# EAGLE schematic botball_v5 (EAGLE 6.5.0), part 1 of 3

## Sheet 1 of 44
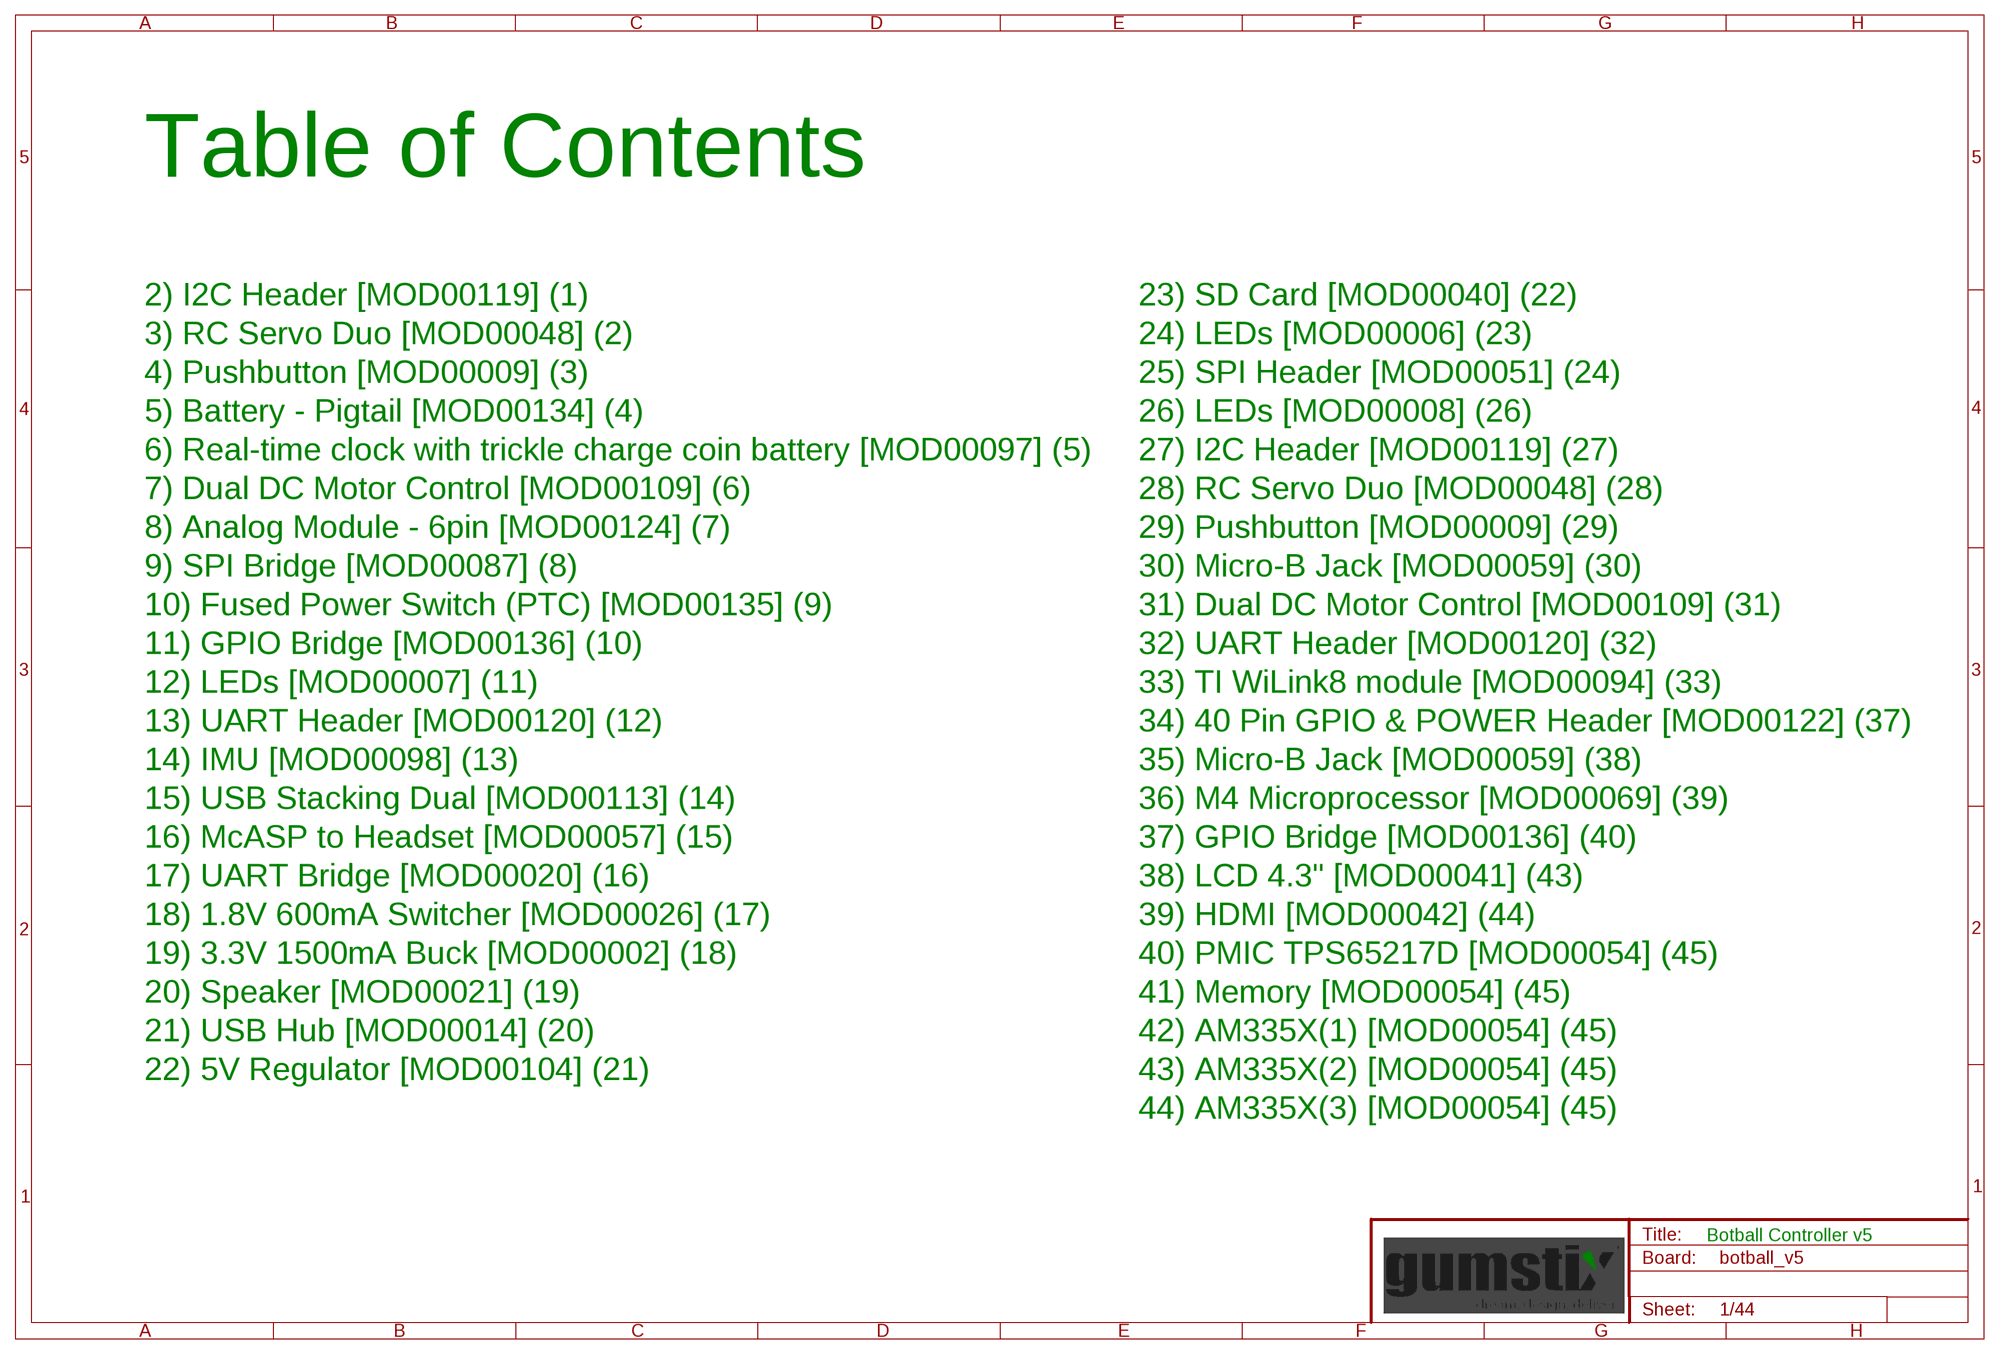
[diagram p0: schematic, sheet 1]

### Notes on the sheet
- Table of Contents
- 2) I2C Header [MOD00119] (1) | 23) SD Card [MOD00040] (22)
- 3) RC Servo Duo [MOD00048] (2) | 24) LEDs [MOD00006] (23)
- 4) Pushbutton [MOD00009] (3) | 25) SPI Header [MOD00051] (24)
- 5) Battery - Pigtail [MOD00134] (4) | 26) LEDs [MOD00008] (26)
- 6) Real-time clock with trickle charge coin battery [MOD00097] (5) | 27) I2C Header [MOD00119] (27)
- 7) Dual DC Motor Control [MOD00109] (6) | 28) RC Servo Duo [MOD00048] (28)
- 8) Analog Module - 6pin [MOD00124] (7) | 29) Pushbutton [MOD00009] (29)
- 9) SPI Bridge [MOD00087] (8) | 30) Micro-B Jack [MOD00059] (30)
- 10) Fused Power Switch (PTC) [MOD00135] (9) | 31) Dual DC Motor Control [MOD00109] (31)
- 11) GPIO Bridge [MOD00136] (10) | 32) UART Header [MOD00120] (32)
- 12) LEDs [MOD00007] (11) | 33) TI WiLink8 module [MOD00094] (33)
- 13) UART Header [MOD00120] (12) | 34) 40 Pin GPIO & POWER Header [MOD00122] (37)
- 14) IMU [MOD00098] (13) | 35) Micro-B Jack [MOD00059] (38)
- 15) USB Stacking Dual [MOD00113] (14) | 36) M4 Microprocessor [MOD00069] (39)
- 16) McASP to Headset [MOD00057] (15) | 37) GPIO Bridge [MOD00136] (40)
- 17) UART Bridge [MOD00020] (16) | 38) LCD 4.3" [MOD00041] (43)
- 18) 1.8V 600mA Switcher [MOD00026] (17) | 39) HDMI [MOD00042] (44)
- 19) 3.3V 1500mA Buck [MOD00002] (18) | 40) PMIC TPS65217D [MOD00054] (45)
- 20) Speaker [MOD00021] (19) | 41) Memory [MOD00054] (45)
- 21) USB Hub [MOD00014] (20) | 42) AM335X(1) [MOD00054] (45)
- 22) 5V Regulator [MOD00104] (21) | 43) AM335X(2) [MOD00054] (45)
- 44) AM335X(3) [MOD00054] (45)
- Botball Controller v5

## Sheet 2 of 44
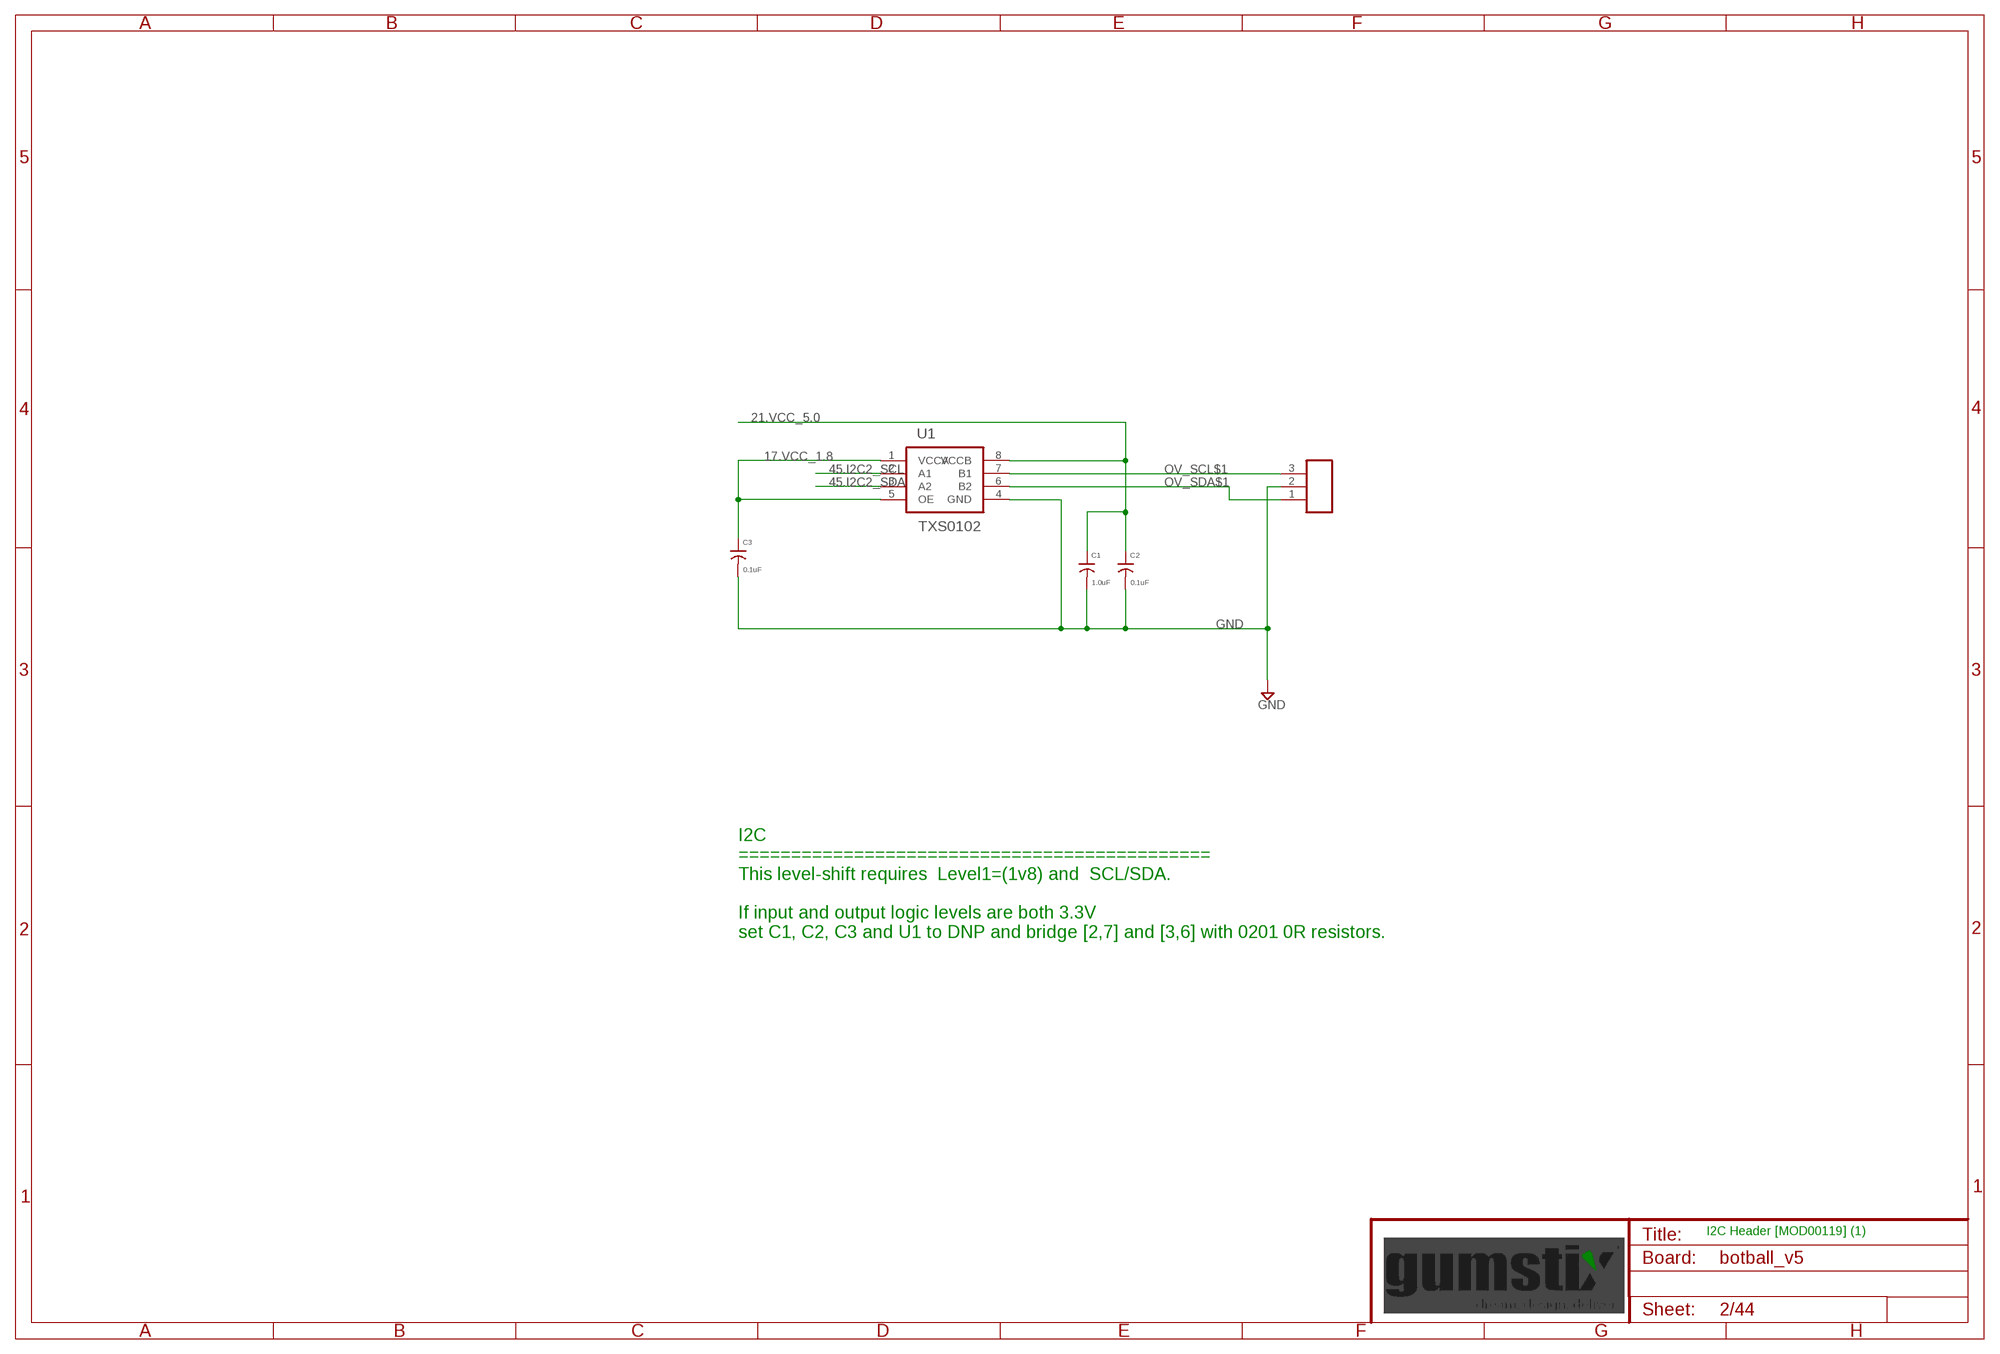
[diagram p1: schematic, sheet 2]

### Parts
C1  1.0uF  C0402  [0402]
C2  0.1uF  C0201  [0201]
C3  0.1uF  C0201  [0201]
J1  MA03X1 FEMALE  MA03X1100  [MA03-100]
U1  TXS0102  [DFN8-0.4P]

### Nets
17.VCC_1.8 [supply]: C3.1 U1.1(VCCA) U1.5(OE) ; also sheet 6,9,11,16,17,18,32,33,37,38,39
21.VCC_5.0 [supply]: C1.1 C2.1 U1.8(VCCB) ; also sheet 3,7,8,10,13,15,21,22,25,27,28,31,32,34,39,40,43
45.I2C2_SCL: U1.2(A1) ; also sheet 43
45.I2C2_SDA: U1.3(A2) ; also sheet 43
GND: C1.2 C2.2 C3.2 J1.2 U1.4(GND) ; also sheet 3,4,5,6,7,9,10,11,12,13,14,15,16,17,18,19,20,21,22,23,24,25,26,27,28,29,30,31,32,33,34,35,36,37,38,39,40,41,42,43,44
OV_SCL$1: J1.3 U1.7(B1)
OV_SDA$1: J1.1 U1.6(B2)

### Notes on the sheet
- I2C
  =============================================
  This level-shift requires  Level1=(1v8) and  SCL/SDA.
  
  If input and output logic levels are both 3.3V
  set C1, C2, C3 and U1 to DNP and bridge [2,7] and [3,6] with 0201 0R resistors.
- I2C Header [MOD00119] (1)

## Sheet 3 of 44
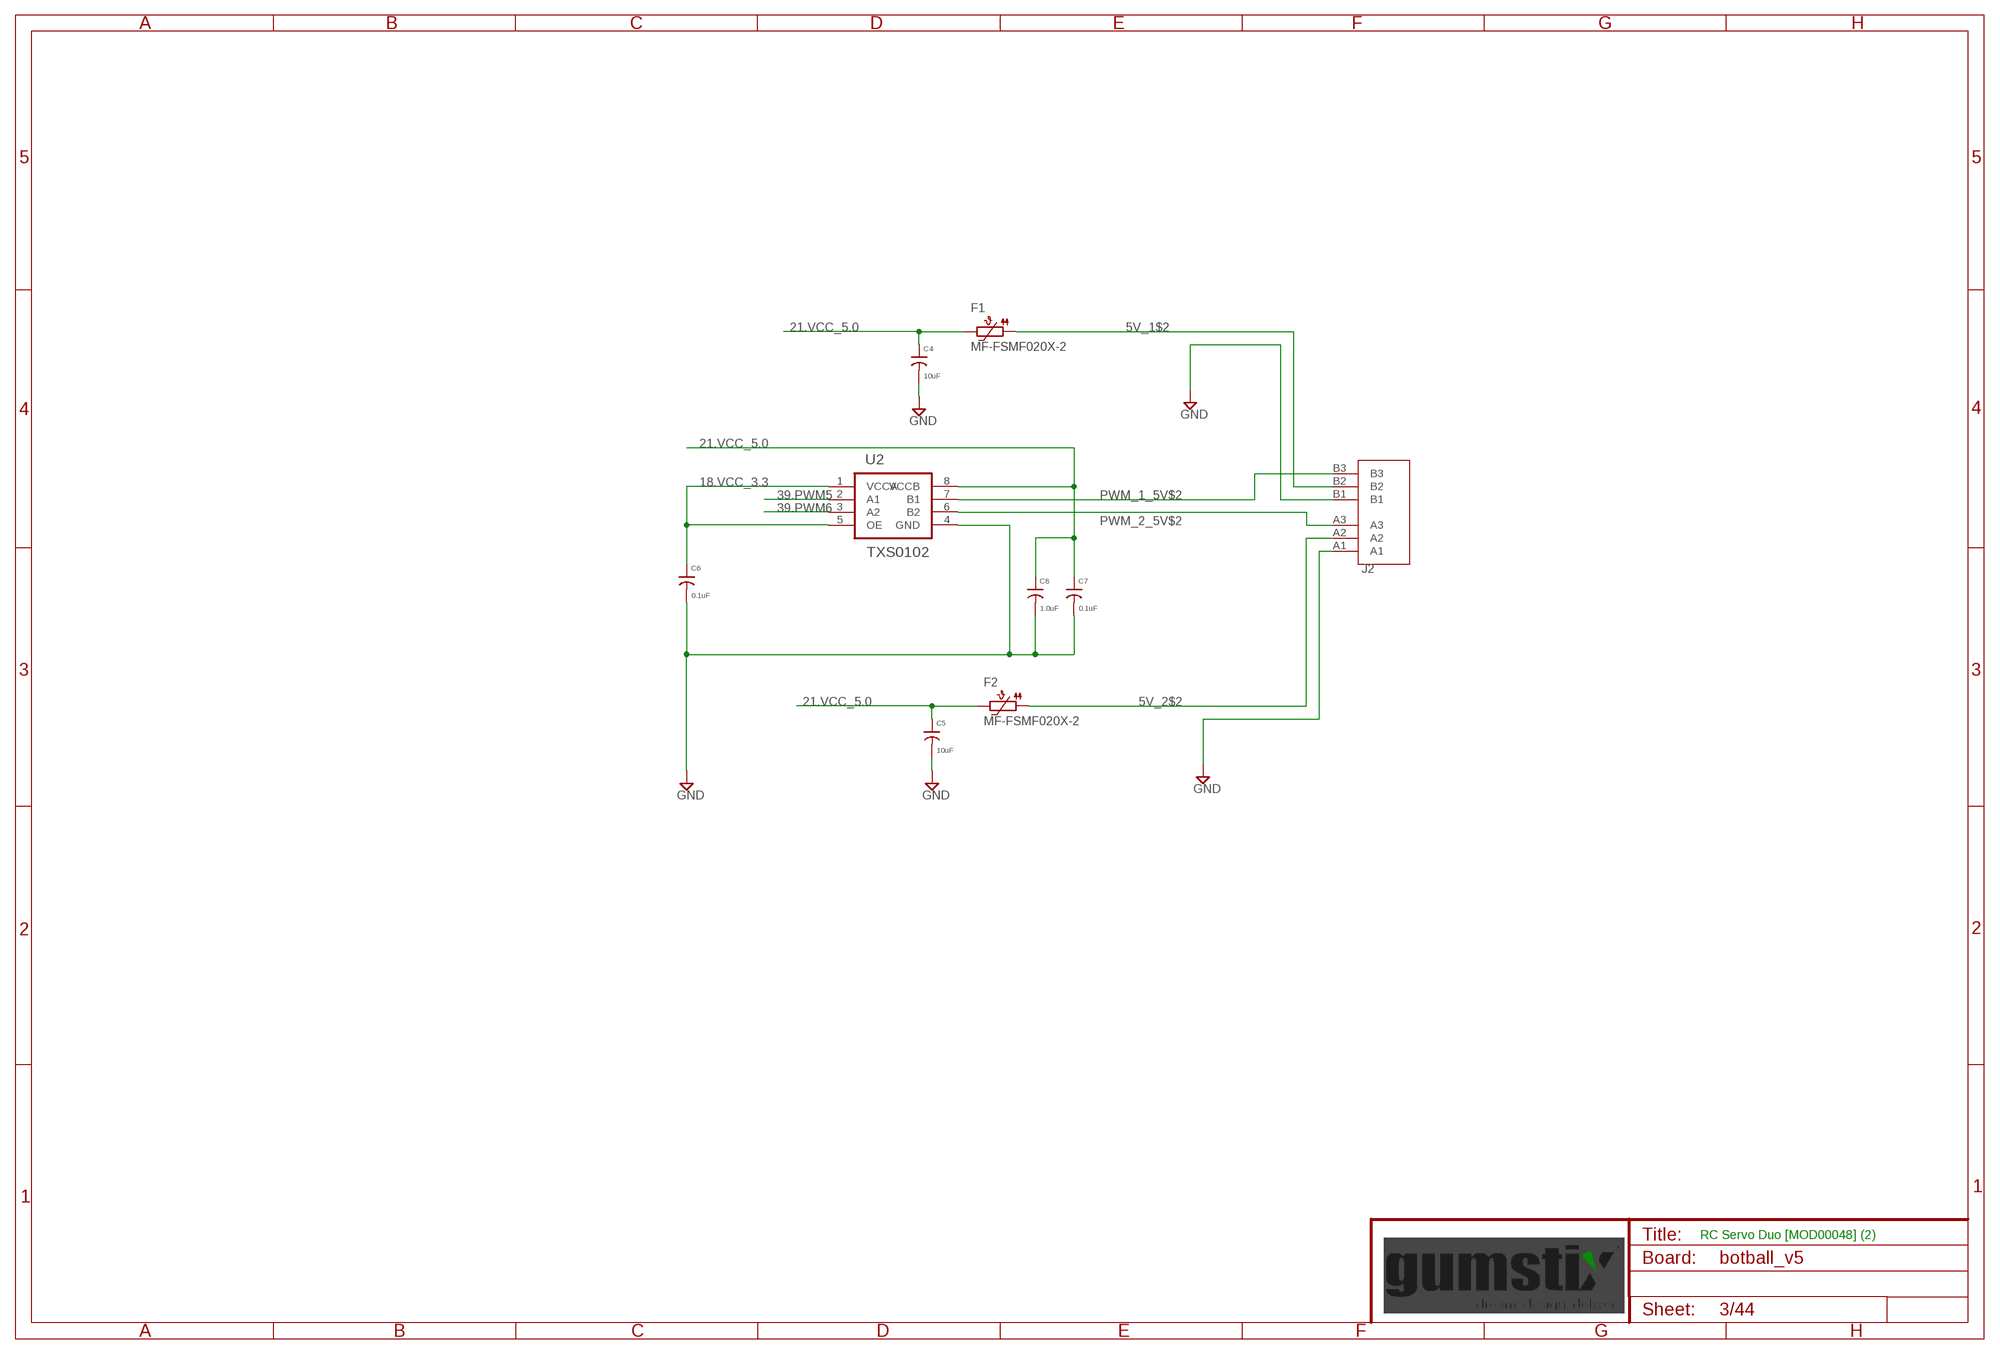
[diagram p2: schematic, sheet 3]

### Parts
C4  10uF  C0402  [0402]
C5  10uF  C0402  [0402]
C6  0.1uF  C0201  [0201]
C7  0.1uF  C0201  [0201]
C8  1.0uF  C0402  [0402]
F1  MF-FSMF020X-2  PTC0603  [0603]
F2  MF-FSMF020X-2  PTC0603  [0603]
J2  MA03X2 FEMALE  MA03X2  [MA03-2]
U2  TXS0102  [DFN8-0.4P]

### Nets
5V_1$2 [supply]: F1.1 J2.B2
5V_2$2 [supply]: F2.1 J2.A2
18.VCC_3.3 [supply]: C6.1 U2.1(VCCA) U2.5(OE) ; also sheet 4,7,9,11,12,13,14,16,17,18,19,20,21,23,24,25,26,27,28,29,31,33,34,36,37,38,39
21.VCC_5.0 [supply]: C4.1 C5.1 C7.1 C8.1 F1.2 F2.2 U2.8(VCCB) ; also sheet 2,7,8,10,13,15,21,22,25,27,28,31,32,34,39,40,43
39.PWM5: U2.2(A1) ; also sheet 36
39.PWM6: U2.3(A2) ; also sheet 36
GND: C4.2 C5.2 C6.2 C7.2 C8.2 J2.A1 J2.B1 U2.4(GND) ; also sheet 2,4,5,6,7,9,10,11,12,13,14,15,16,17,18,19,20,21,22,23,24,25,26,27,28,29,30,31,32,33,34,35,36,37,38,39,40,41,42,43,44
PWM_1_5V$2: J2.B3 U2.7(B1)
PWM_2_5V$2: J2.A3 U2.6(B2)

### Notes on the sheet
- RC Servo Duo [MOD00048] (2)

## Sheet 4 of 44
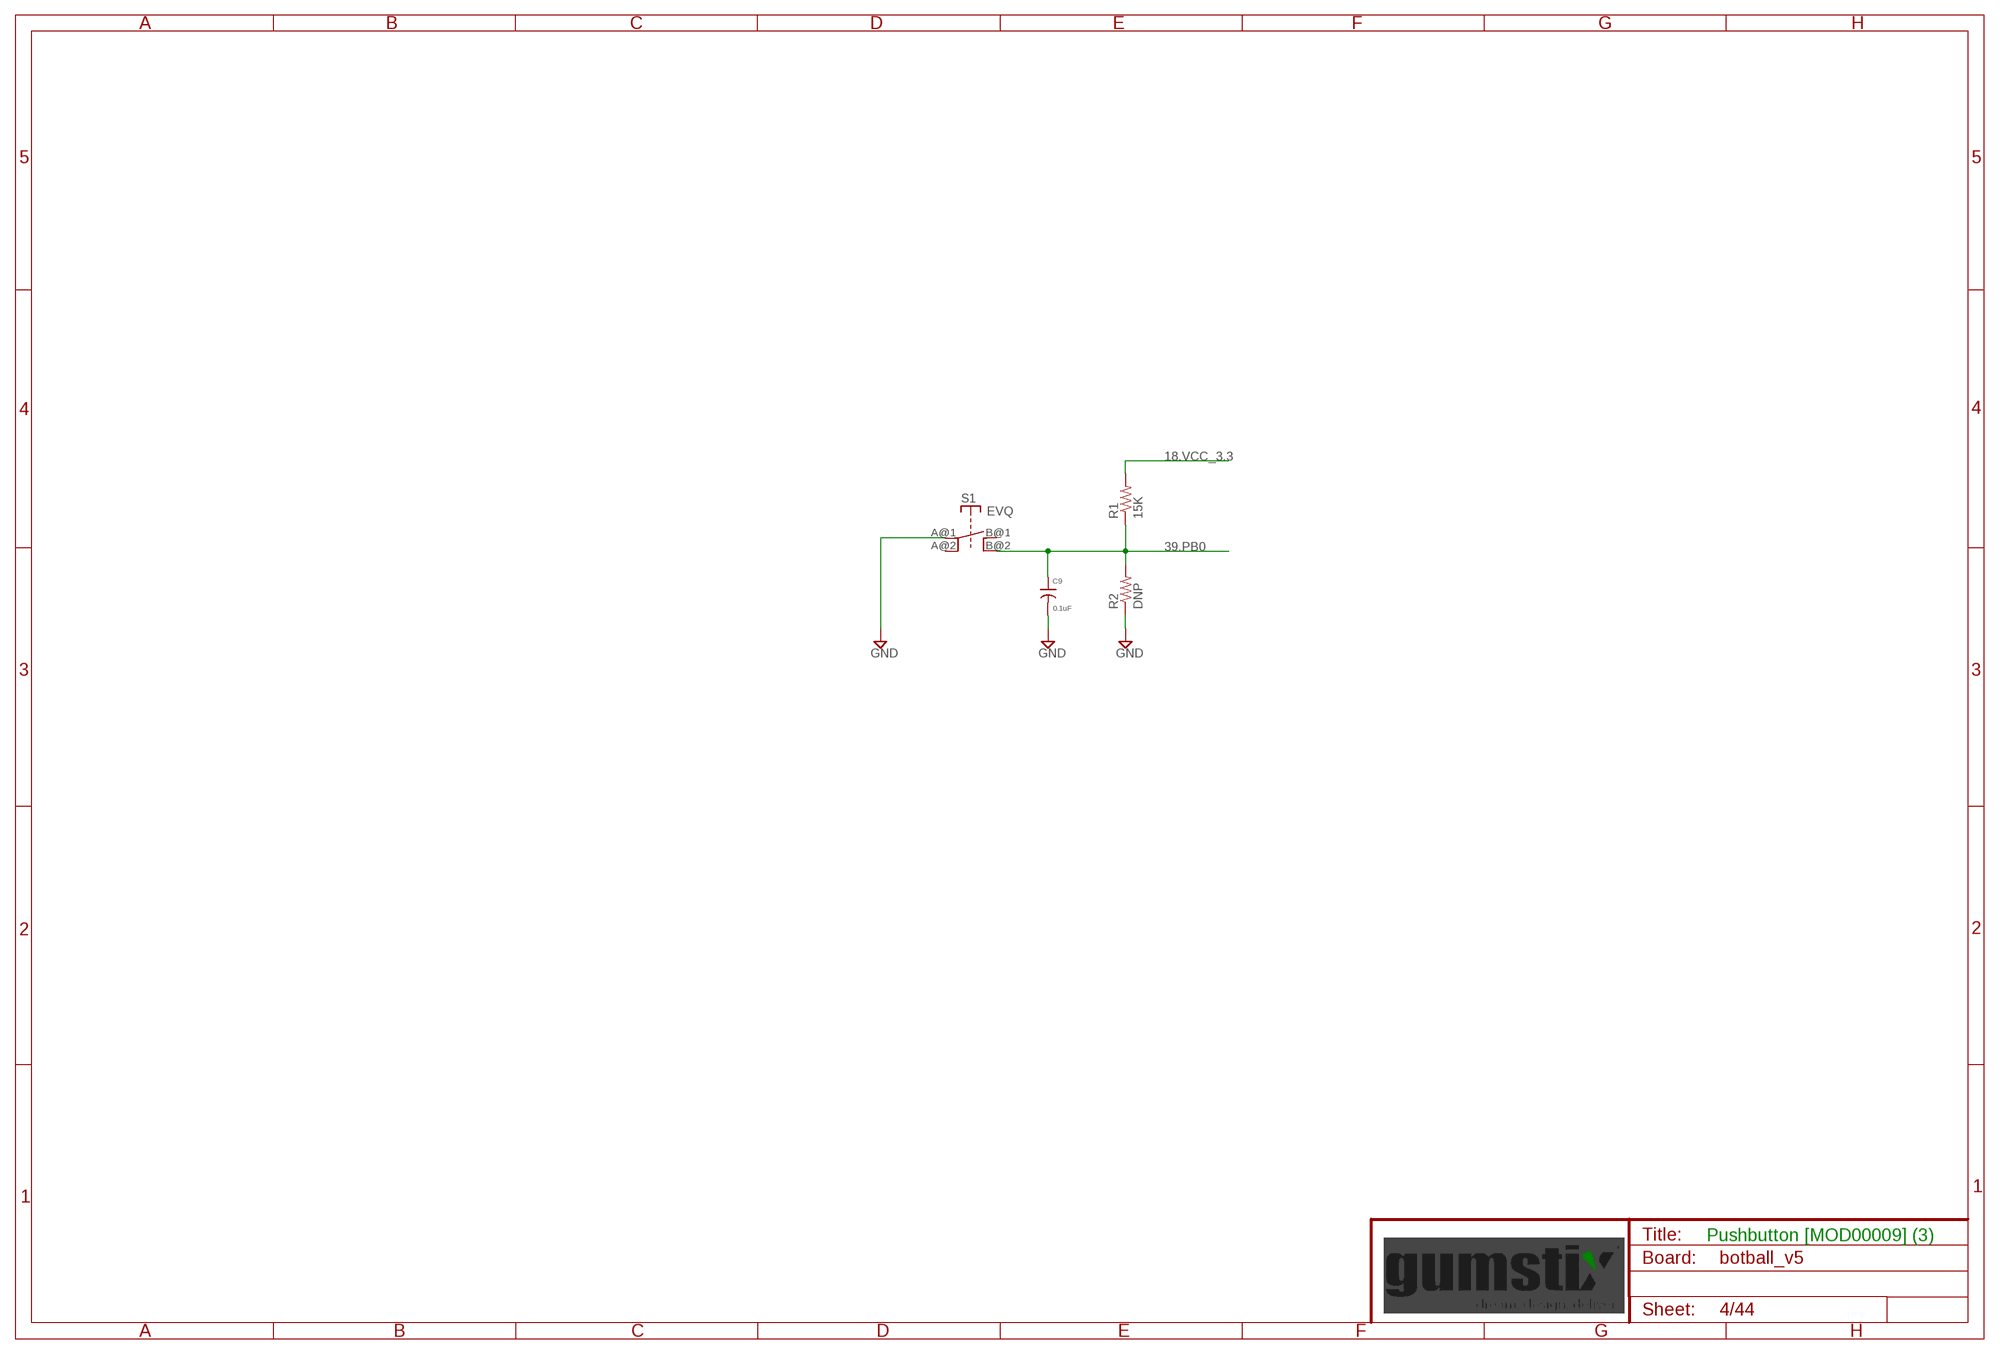
[diagram p3: schematic, sheet 4]

### Parts
C9  0.1uF  C0402  [0402]
R1  15K  R0402  [0402]
R2  DNP  R0402  [0402]
S1  EVQ  [EVQ]

### Nets
18.VCC_3.3 [supply]: R1.2 ; also sheet 3,7,9,11,12,13,14,16,17,18,19,20,21,23,24,25,26,27,28,29,31,33,34,36,37,38,39
39.PB0: C9.1 R1.1 R2.2 S1.B@2(B') ; also sheet 36
GND: C9.2 R2.1 S1.A@1(A) ; also sheet 2,3,5,6,7,9,10,11,12,13,14,15,16,17,18,19,20,21,22,23,24,25,26,27,28,29,30,31,32,33,34,35,36,37,38,39,40,41,42,43,44
Unconnected: S1.A@2(A') S1.B@1(B)

### Notes on the sheet
- Pushbutton [MOD00009] (3)

## Sheet 5 of 44
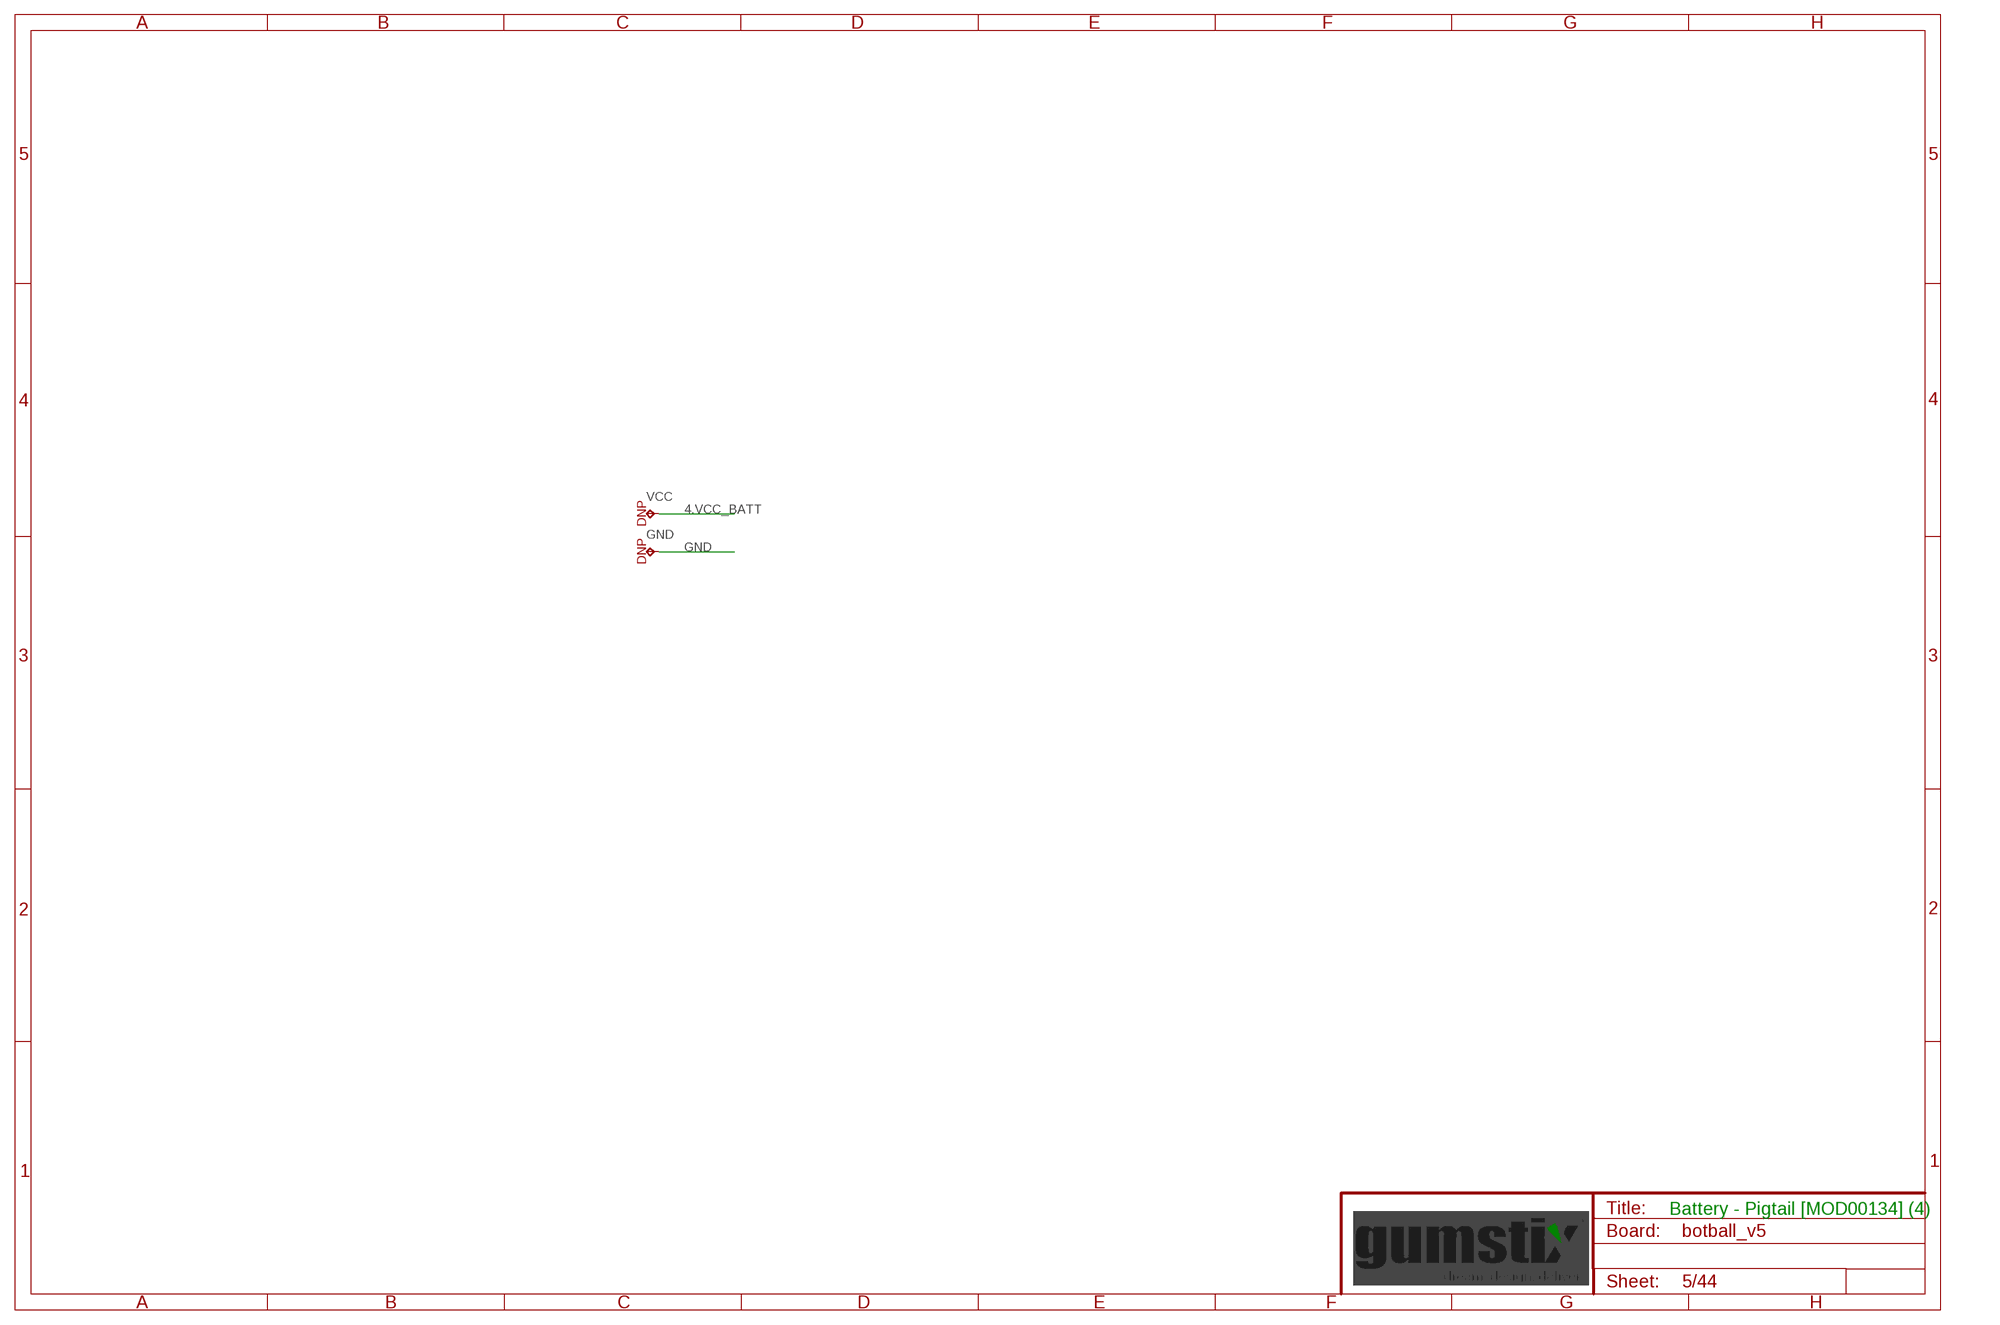
[diagram p4: schematic, sheet 5]

### Parts
GND  DNP  TP  [P1-13]
VCC  DNP  TP  [P1-13]

### Nets
4.VCC_BATT [supply]: VCC.TP ; also sheet 10,36
GND: GND.TP ; also sheet 2,3,4,6,7,9,10,11,12,13,14,15,16,17,18,19,20,21,22,23,24,25,26,27,28,29,30,31,32,33,34,35,36,37,38,39,40,41,42,43,44

### Notes on the sheet
- Battery - Pigtail [MOD00134] (4)

## Sheet 6 of 44
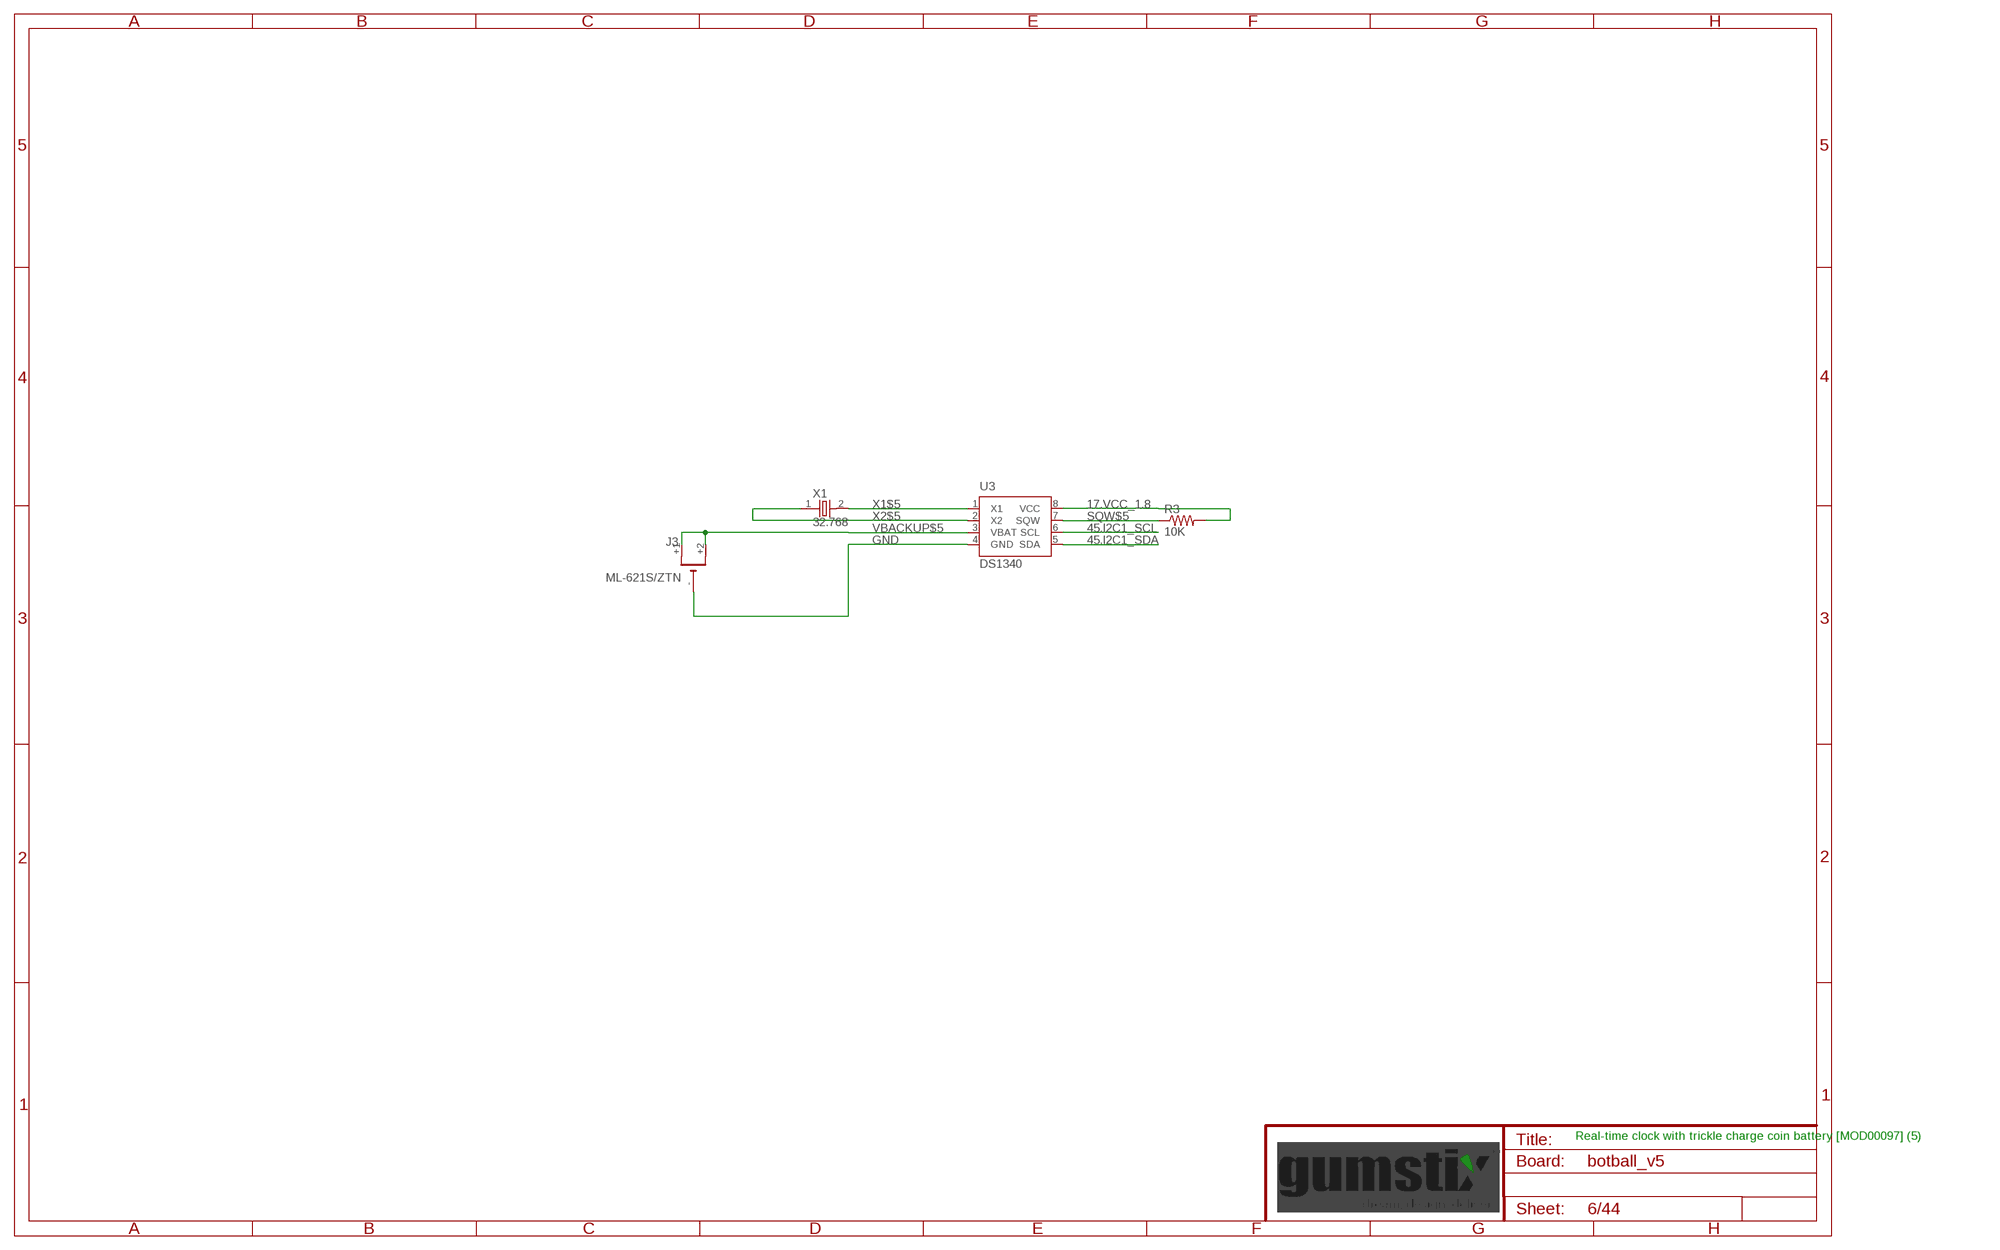
[diagram p5: schematic, sheet 6]

### Parts
J3  ML-621S/ZTN  COIN_CELL_6.8MM  [BATTERY_6.8MM-2998]
R3  10K  R0201  [0201]
U3  DS1340  DS1339  [SO-8]
X1  32.768  X2CM415  [CM415]

### Nets
17.VCC_1.8 [supply]: R3.2 U3.8(VCC) ; also sheet 2,9,11,16,17,18,32,33,37,38,39
45.I2C1_SCL: U3.6(SCL) ; also sheet 39,43
45.I2C1_SDA: U3.5(SDA) ; also sheet 39,43
GND: J3.- U3.4(GND) ; also sheet 2,3,4,5,7,9,10,11,12,13,14,15,16,17,18,19,20,21,22,23,24,25,26,27,28,29,30,31,32,33,34,35,36,37,38,39,40,41,42,43,44
SQW$5: R3.1 U3.7(SQW)
VBACKUP$5 [supply]: J3.+1 J3.+2 U3.3(VBAT)
X1$5: U3.1(X1) X1.2
X2$5: U3.2(X2) X1.1

### Notes on the sheet
- Real-time clock with trickle charge coin battery [MOD00097] (5)

## Sheet 7 of 44
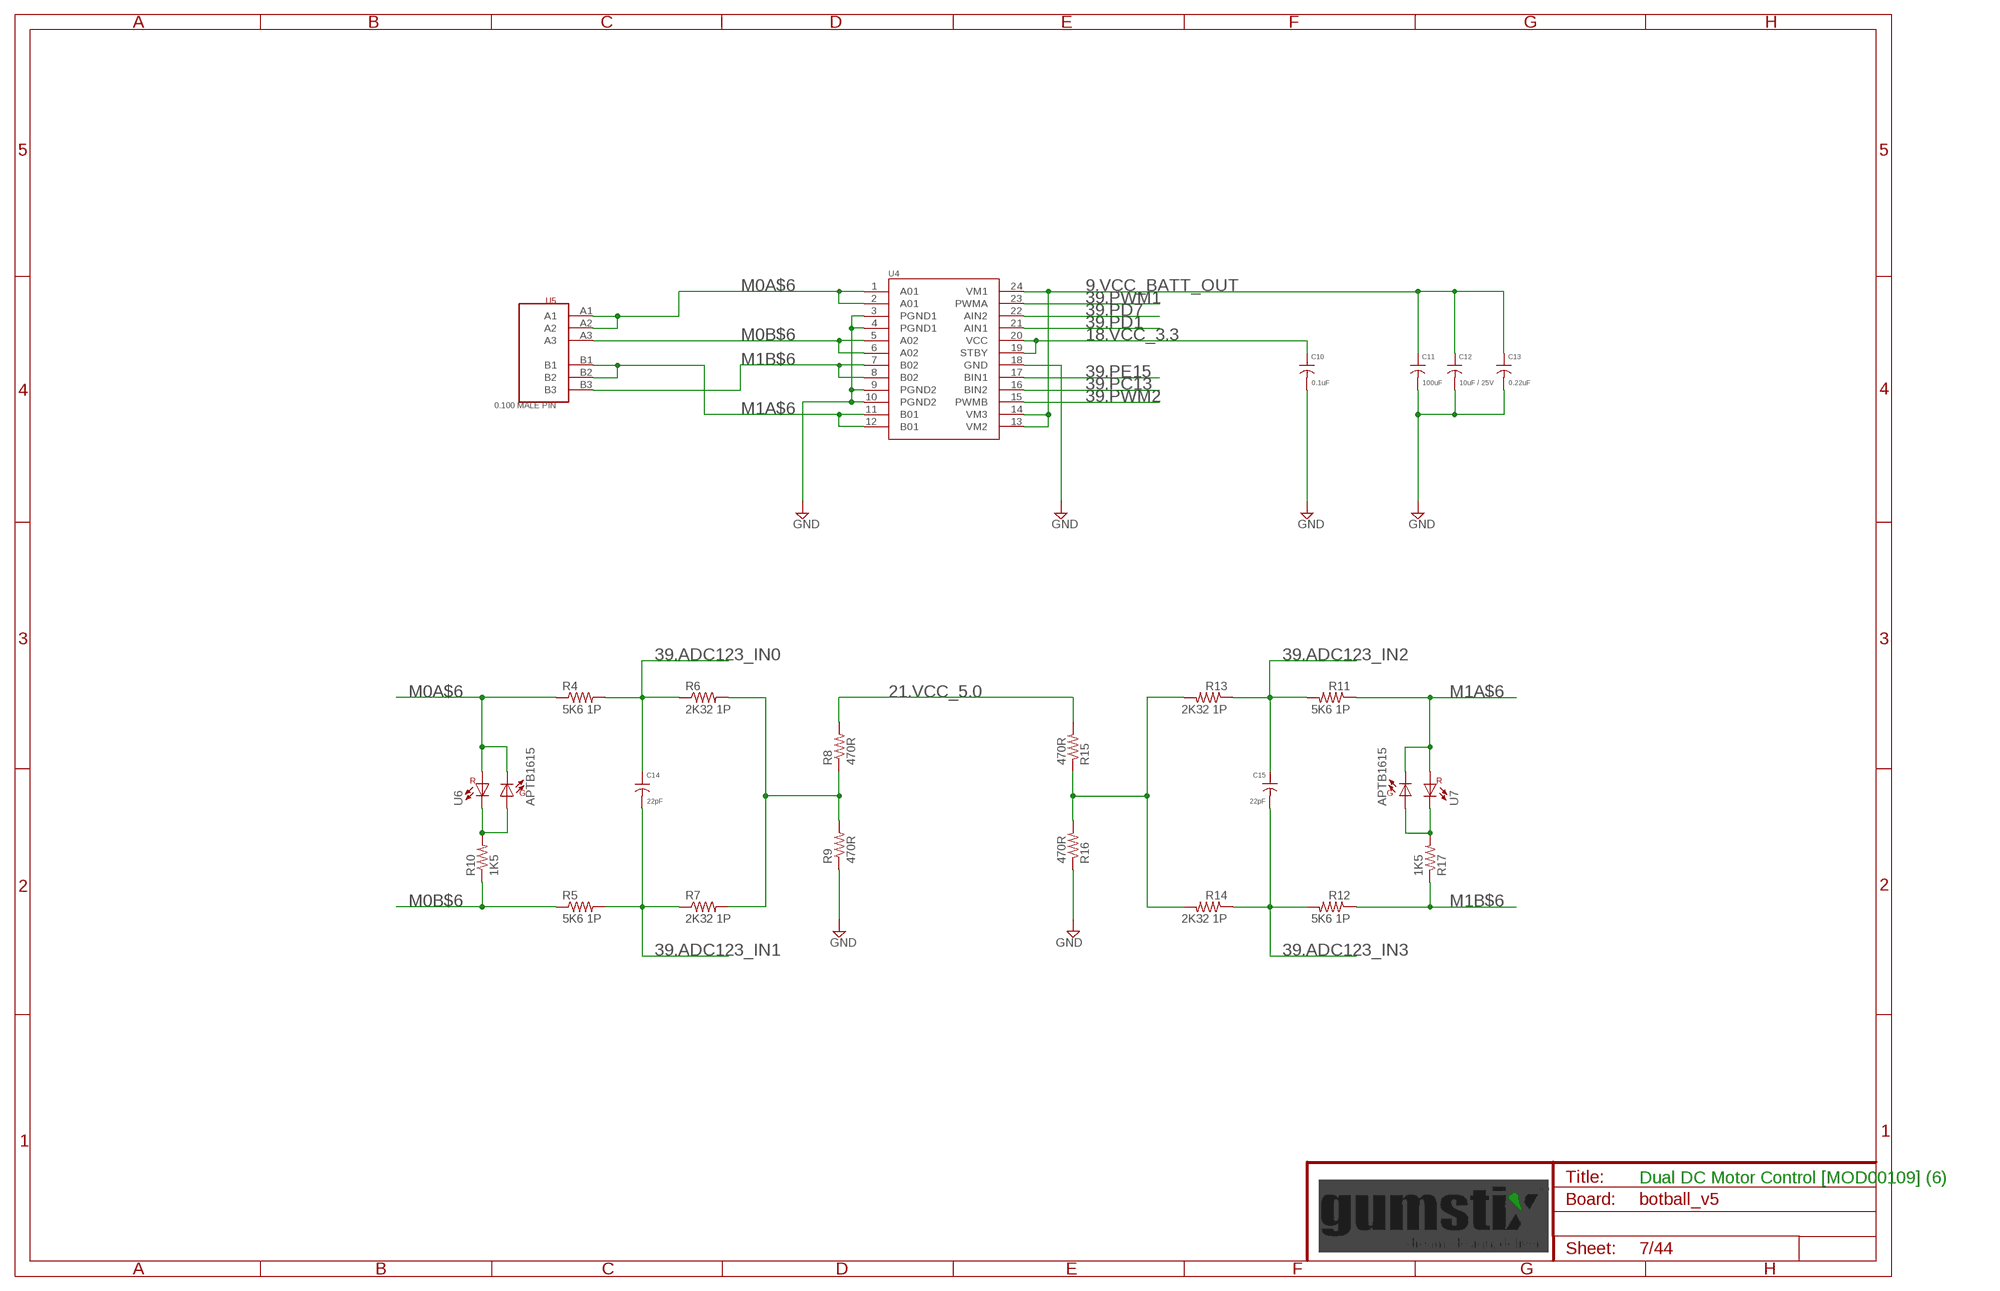
[diagram p6: schematic, sheet 7]

### Parts
C10  0.1uF  C0201  [0201]
C11  100uF  CPANASONIC_D  [PANASONIC_D]
C12  10uF / 25V  C1206  [1206]
C13  0.22uF  C0603  [0603]
C14  22pF  C0402  [0402]
C15  22pF  C0402  [0402]
R4  5K6 1P  R0402  [0402]
R5  5K6 1P  R0402  [0402]
R6  2K32 1P  R0402  [0402]
R7  2K32 1P  R0402  [0402]
R8  470R  R0402  [0402]
R9  470R  R0402  [0402]
R10  1K5  R0402  [0402]
R11  5K6 1P  R0402  [0402]
R12  5K6 1P  R0402  [0402]
R13  2K32 1P  R0402  [0402]
R14  2K32 1P  R0402  [0402]
R15  470R  R0402  [0402]
R16  470R  R0402  [0402]
R17  1K5  R0402  [0402]
U4  TB6612FNG  [SSOP24]
U5  0.100 MALE PIN  2X03SHROUD  [2X03_SHROUD]
U6  APTB1615  [APTB1615]
U7  APTB1615  [APTB1615]

### Nets
9.VCC_BATT_OUT [supply]: C11.+ C12.1 C13.1 U4.13(VM2) U4.14(VM3) U4.24(VM1) ; also sheet 10,31
18.VCC_3.3 [supply]: C10.1 U4.19(STBY) U4.20(VCC) ; also sheet 3,4,9,11,12,13,14,16,17,18,19,20,21,23,24,25,26,27,28,29,31,33,34,36,37,38,39
21.VCC_5.0 [supply]: R8.2 R15.2 ; also sheet 2,3,8,10,13,15,21,22,25,27,28,31,32,34,39,40,43
39.ADC123_IN0: C14.1 R4.2 R6.1 ; also sheet 36
39.ADC123_IN1: C14.2 R5.2 R7.1 ; also sheet 36
39.ADC123_IN2: C15.1 R11.2 R13.1 ; also sheet 36
39.ADC123_IN3: C15.2 R12.2 R14.1 ; also sheet 36
39.PC13: U4.16(BIN2) ; also sheet 36
39.PD1: U4.21(AIN1) ; also sheet 36
39.PD7: U4.22(AIN2) ; also sheet 36
39.PE15: U4.17(BIN1) ; also sheet 36
39.PWM1: U4.23(PWMA) ; also sheet 36
39.PWM2: U4.15(PWMB) ; also sheet 36
D0_OUT$6: R10.2 U6.2 U6.3
D1_OUT$6: R17.2 U7.2 U7.3
GND: C10.2 C11.- C12.2 C13.2 R9.1 R16.1 U4.3(PGND1) U4.4(PGND1) U4.9(PGND2) U4.10(PGND2) U4.18(GND) ; also sheet 2,3,4,5,6,9,10,11,12,13,14,15,16,17,18,19,20,21,22,23,24,25,26,27,28,29,30,31,32,33,34,35,36,37,38,39,40,41,42,43,44
M0A$6 [supply]: R4.1 U4.1(A01) U4.2(A01) U5.A1 U5.A2 U6.1 U6.4
M0B$6: R5.1 R10.1 U4.5(A02) U4.6(A02) U5.A3
M1A$6 [supply]: R11.1 U4.11(B01) U4.12(B01) U5.B1 U5.B2 U7.1 U7.4
M1B$6 [supply]: R12.1 R17.1 U4.7(B02) U4.8(B02) U5.B3
VD0$6: R6.2 R7.2 R8.1 R9.2
VD1$6: R13.2 R14.2 R15.1 R16.2

### Notes on the sheet
- Dual DC Motor Control [MOD00109] (6)

## Sheet 8 of 44
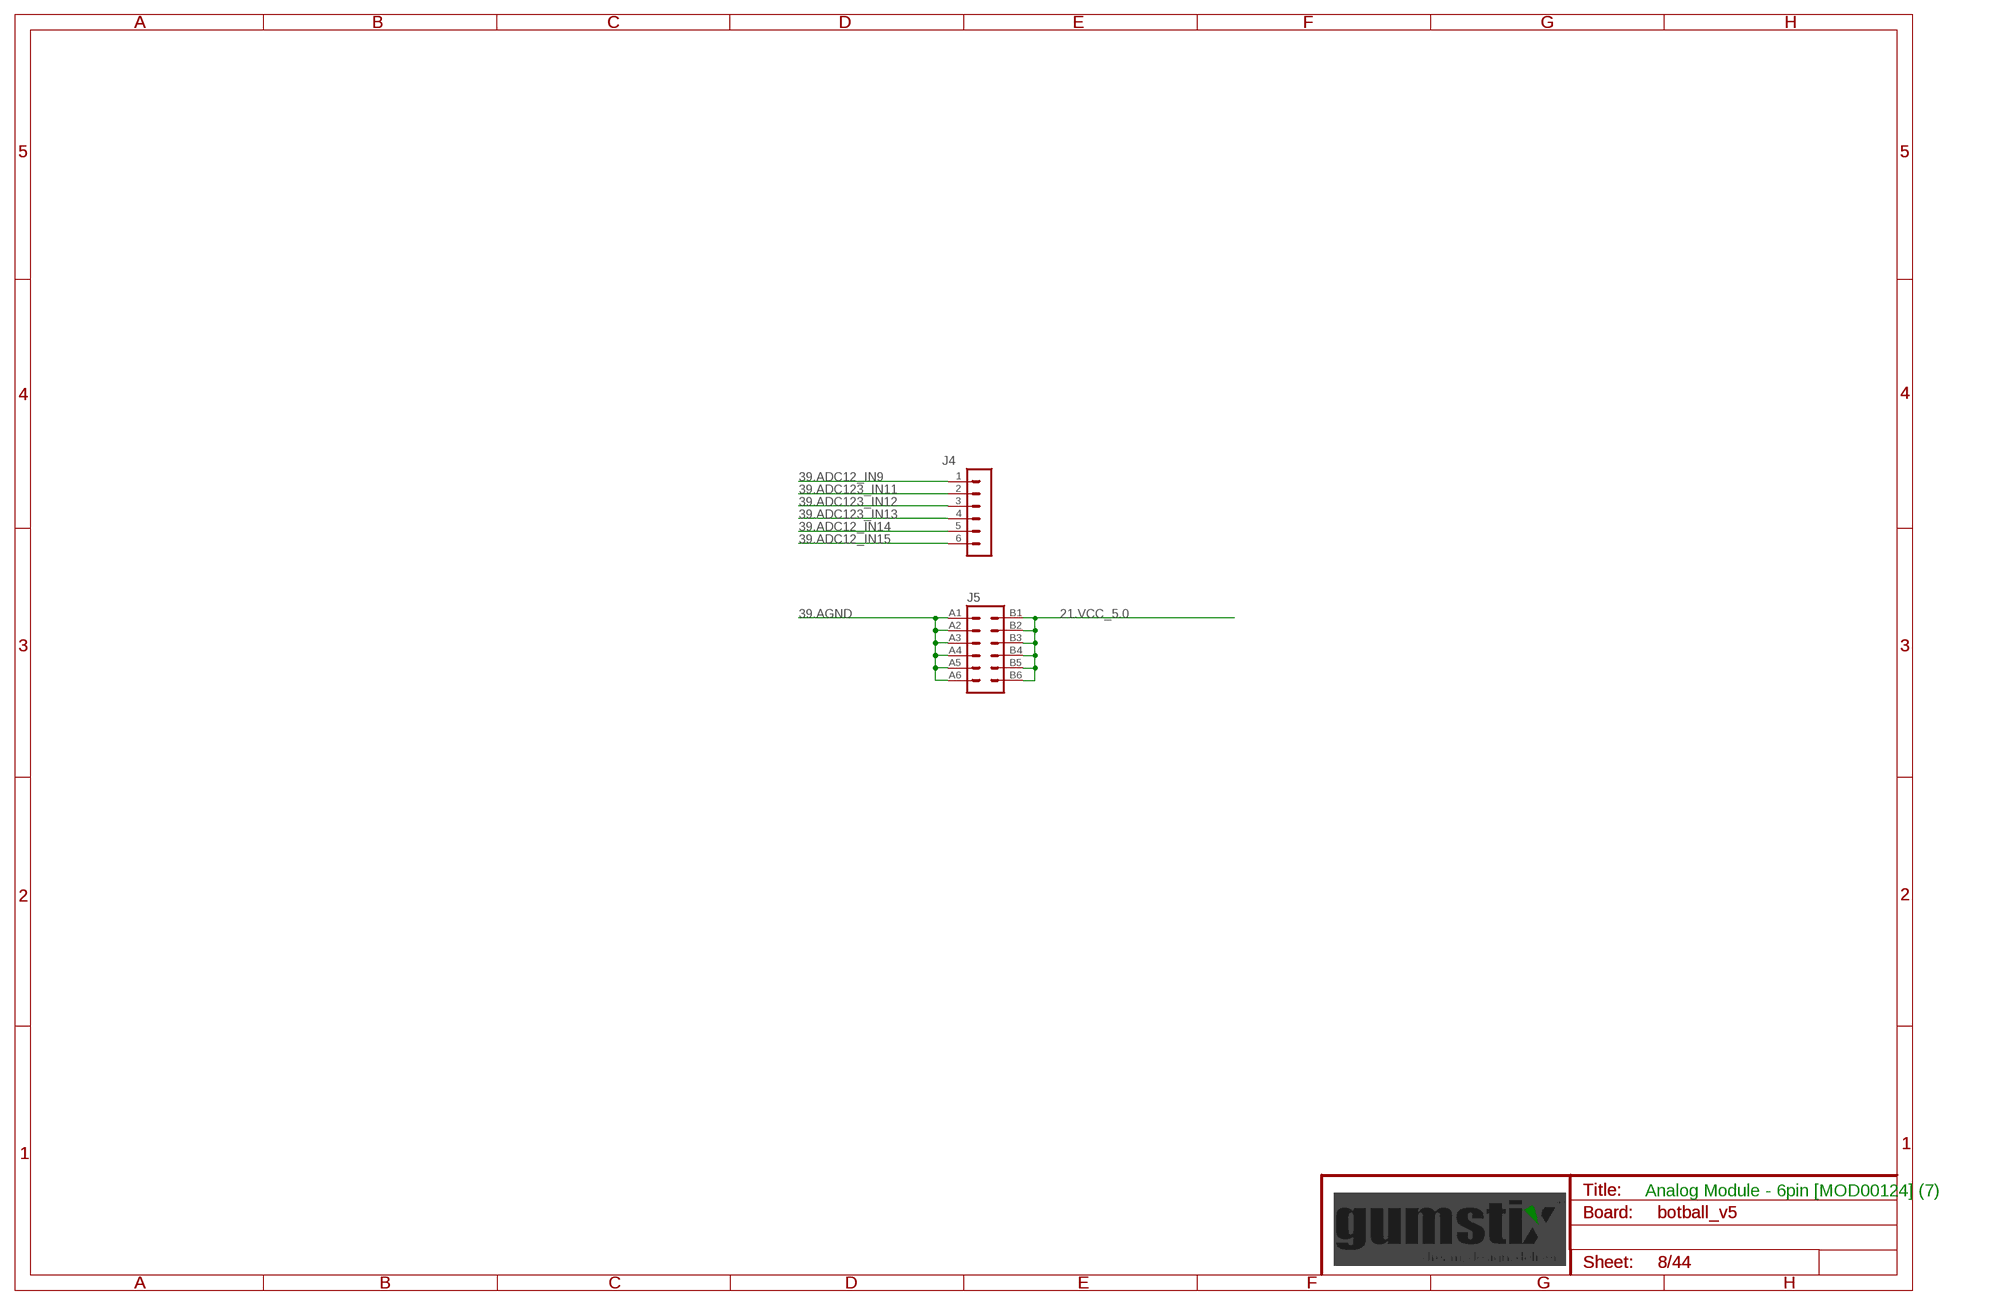
[diagram p7: schematic, sheet 8]

### Parts
J4  0.1 FEMALE  1X06  [1X06]
J5  0.1 FEMALE  2X06  [2X06]

### Nets
21.VCC_5.0 [supply]: J5.B1 J5.B2 J5.B3 J5.B4 J5.B5 J5.B6 ; also sheet 2,3,7,10,13,15,21,22,25,27,28,31,32,34,39,40,43
39.ADC12_IN9: J4.1 ; also sheet 36
39.ADC12_IN14: J4.5 ; also sheet 36
39.ADC12_IN15: J4.6 ; also sheet 36
39.ADC123_IN11: J4.2 ; also sheet 36
39.ADC123_IN12: J4.3 ; also sheet 36
39.ADC123_IN13: J4.4 ; also sheet 36
39.AGND [supply]: J5.A1 J5.A2 J5.A3 J5.A4 J5.A5 J5.A6 ; also sheet 36

### Notes on the sheet
- Analog Module - 6pin [MOD00124] (7)

## Sheet 9 of 44
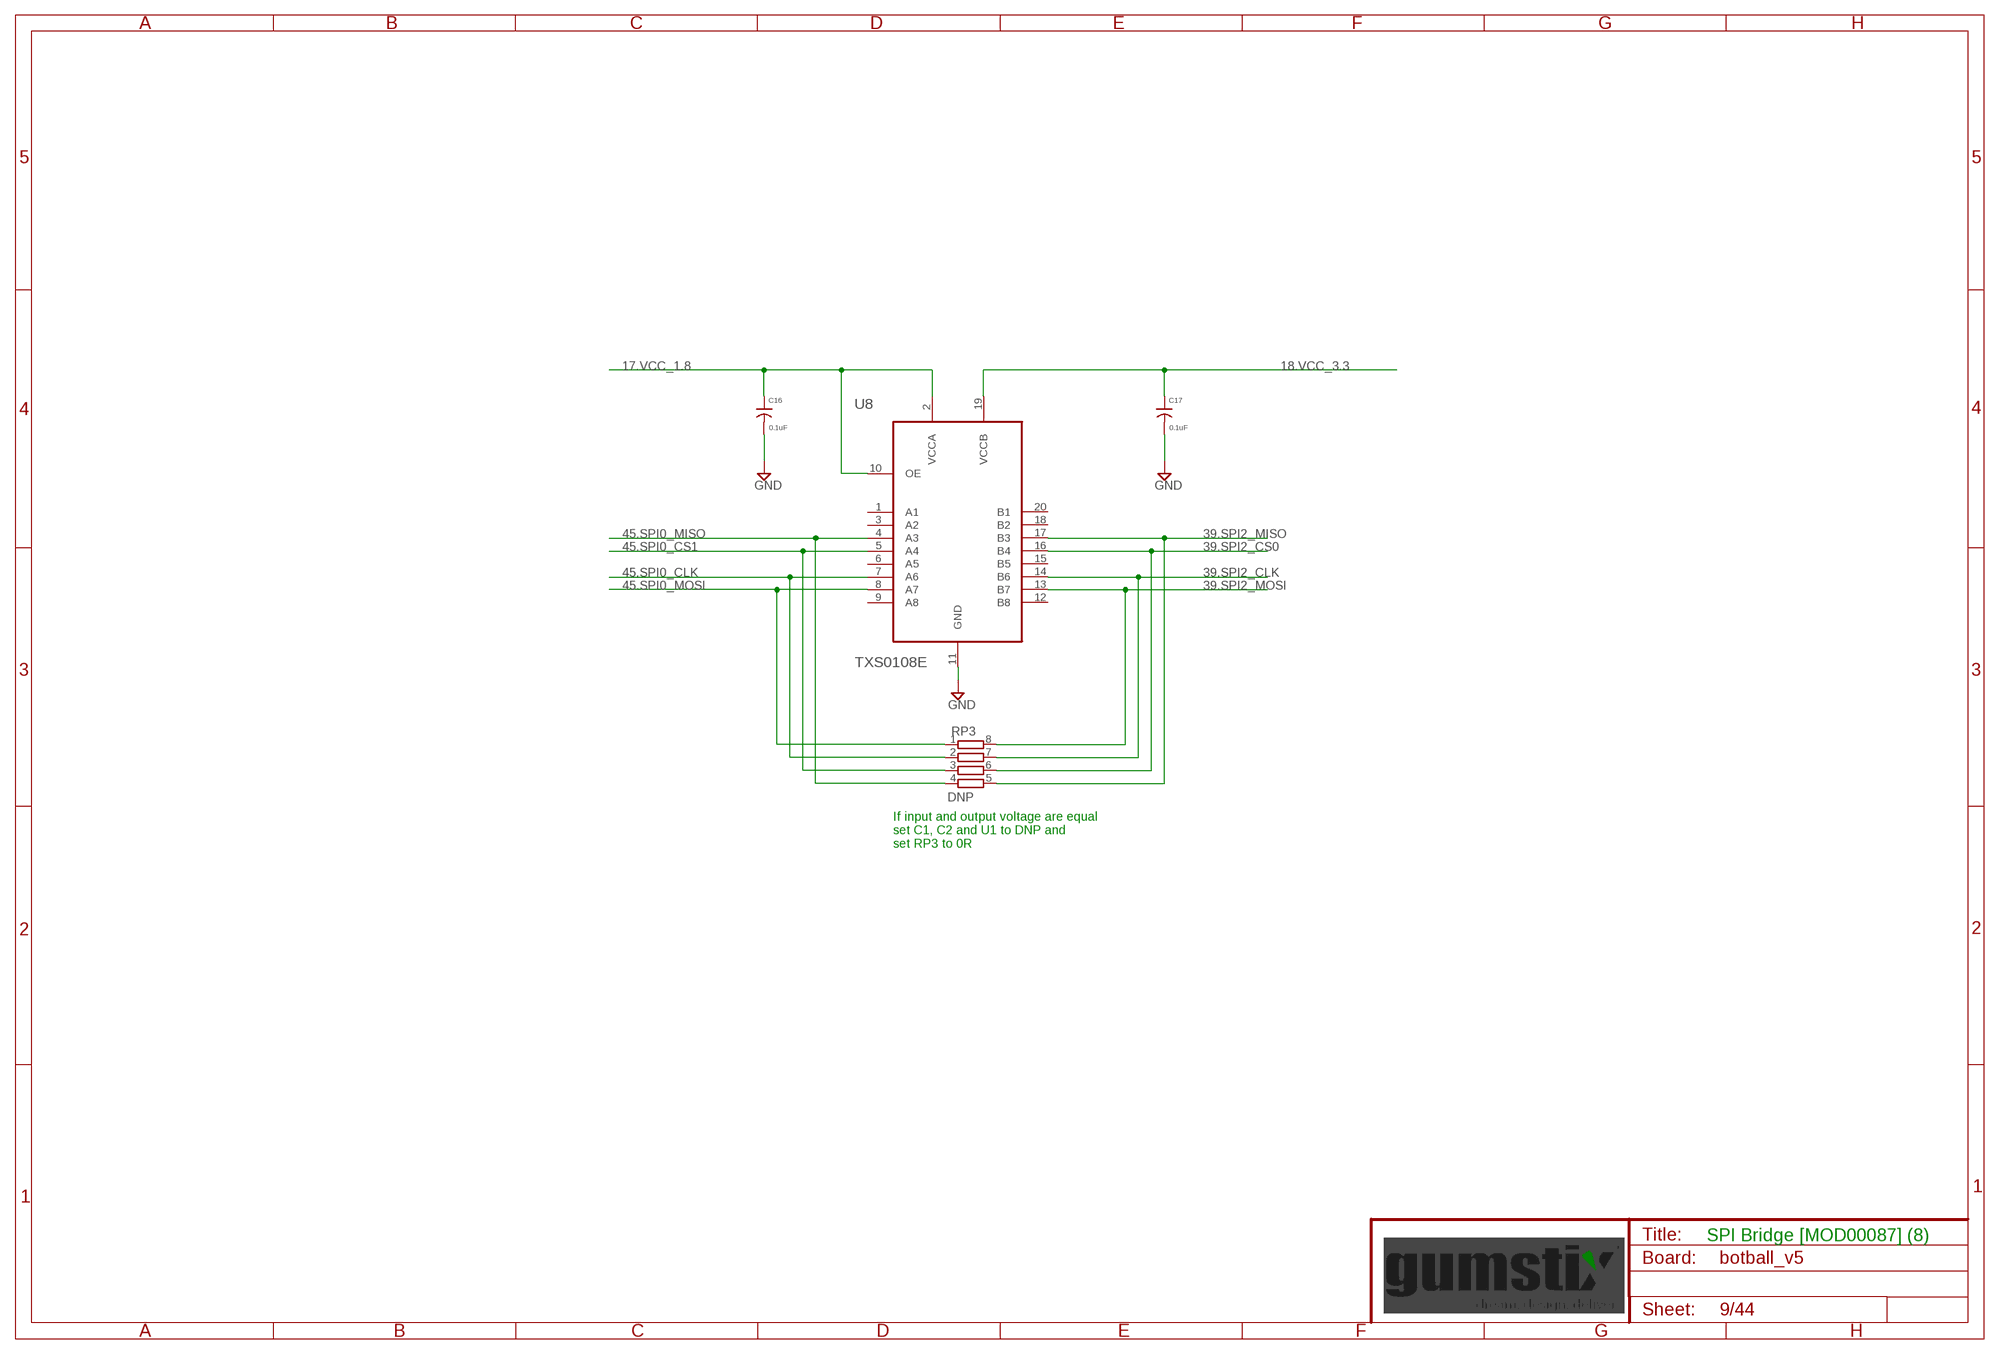
[diagram p8: schematic, sheet 9]

### Parts
C16  0.1uF  C0201  [0201]
C17  0.1uF  C0201  [0201]
RP3  DNP  RP741X083  [741X08]
U8  TXS0108E  [QFN20]

### Nets
17.VCC_1.8 [supply]: C16.1 U8.2(VCCA) U8.10(OE) ; also sheet 2,6,11,16,17,18,32,33,37,38,39
18.VCC_3.3 [supply]: C17.1 U8.19(VCCB) ; also sheet 3,4,7,11,12,13,14,16,17,18,19,20,21,23,24,25,26,27,28,29,31,33,34,36,37,38,39
39.SPI2_CLK: RP3.7 U8.14(B6) ; also sheet 36
39.SPI2_CS0: RP3.6 U8.16(B4) ; also sheet 36
39.SPI2_MISO: RP3.5 U8.17(B3) ; also sheet 36
39.SPI2_MOSI: RP3.8 U8.13(B7) ; also sheet 36
45.SPI0_CLK: RP3.2 U8.7(A6) ; also sheet 38,43
45.SPI0_CS1: RP3.3 U8.5(A4) ; also sheet 43
45.SPI0_MISO: RP3.4 U8.4(A3) ; also sheet 38,43
45.SPI0_MOSI: RP3.1 U8.8(A7) ; also sheet 38,43
GND: C16.2 C17.2 U8.11(GND) ; also sheet 2,3,4,5,6,7,10,11,12,13,14,15,16,17,18,19,20,21,22,23,24,25,26,27,28,29,30,31,32,33,34,35,36,37,38,39,40,41,42,43,44
Unconnected: U8.1(A1) U8.3(A2) U8.6(A5) U8.9(A8) U8.12(B8) U8.15(B5) U8.18(B2) U8.20(B1)

### Notes on the sheet
- If input and output voltage are equal
  set C1, C2 and U1 to DNP and
  set RP3 to 0R
- SPI Bridge [MOD00087] (8)

## Sheet 10 of 44
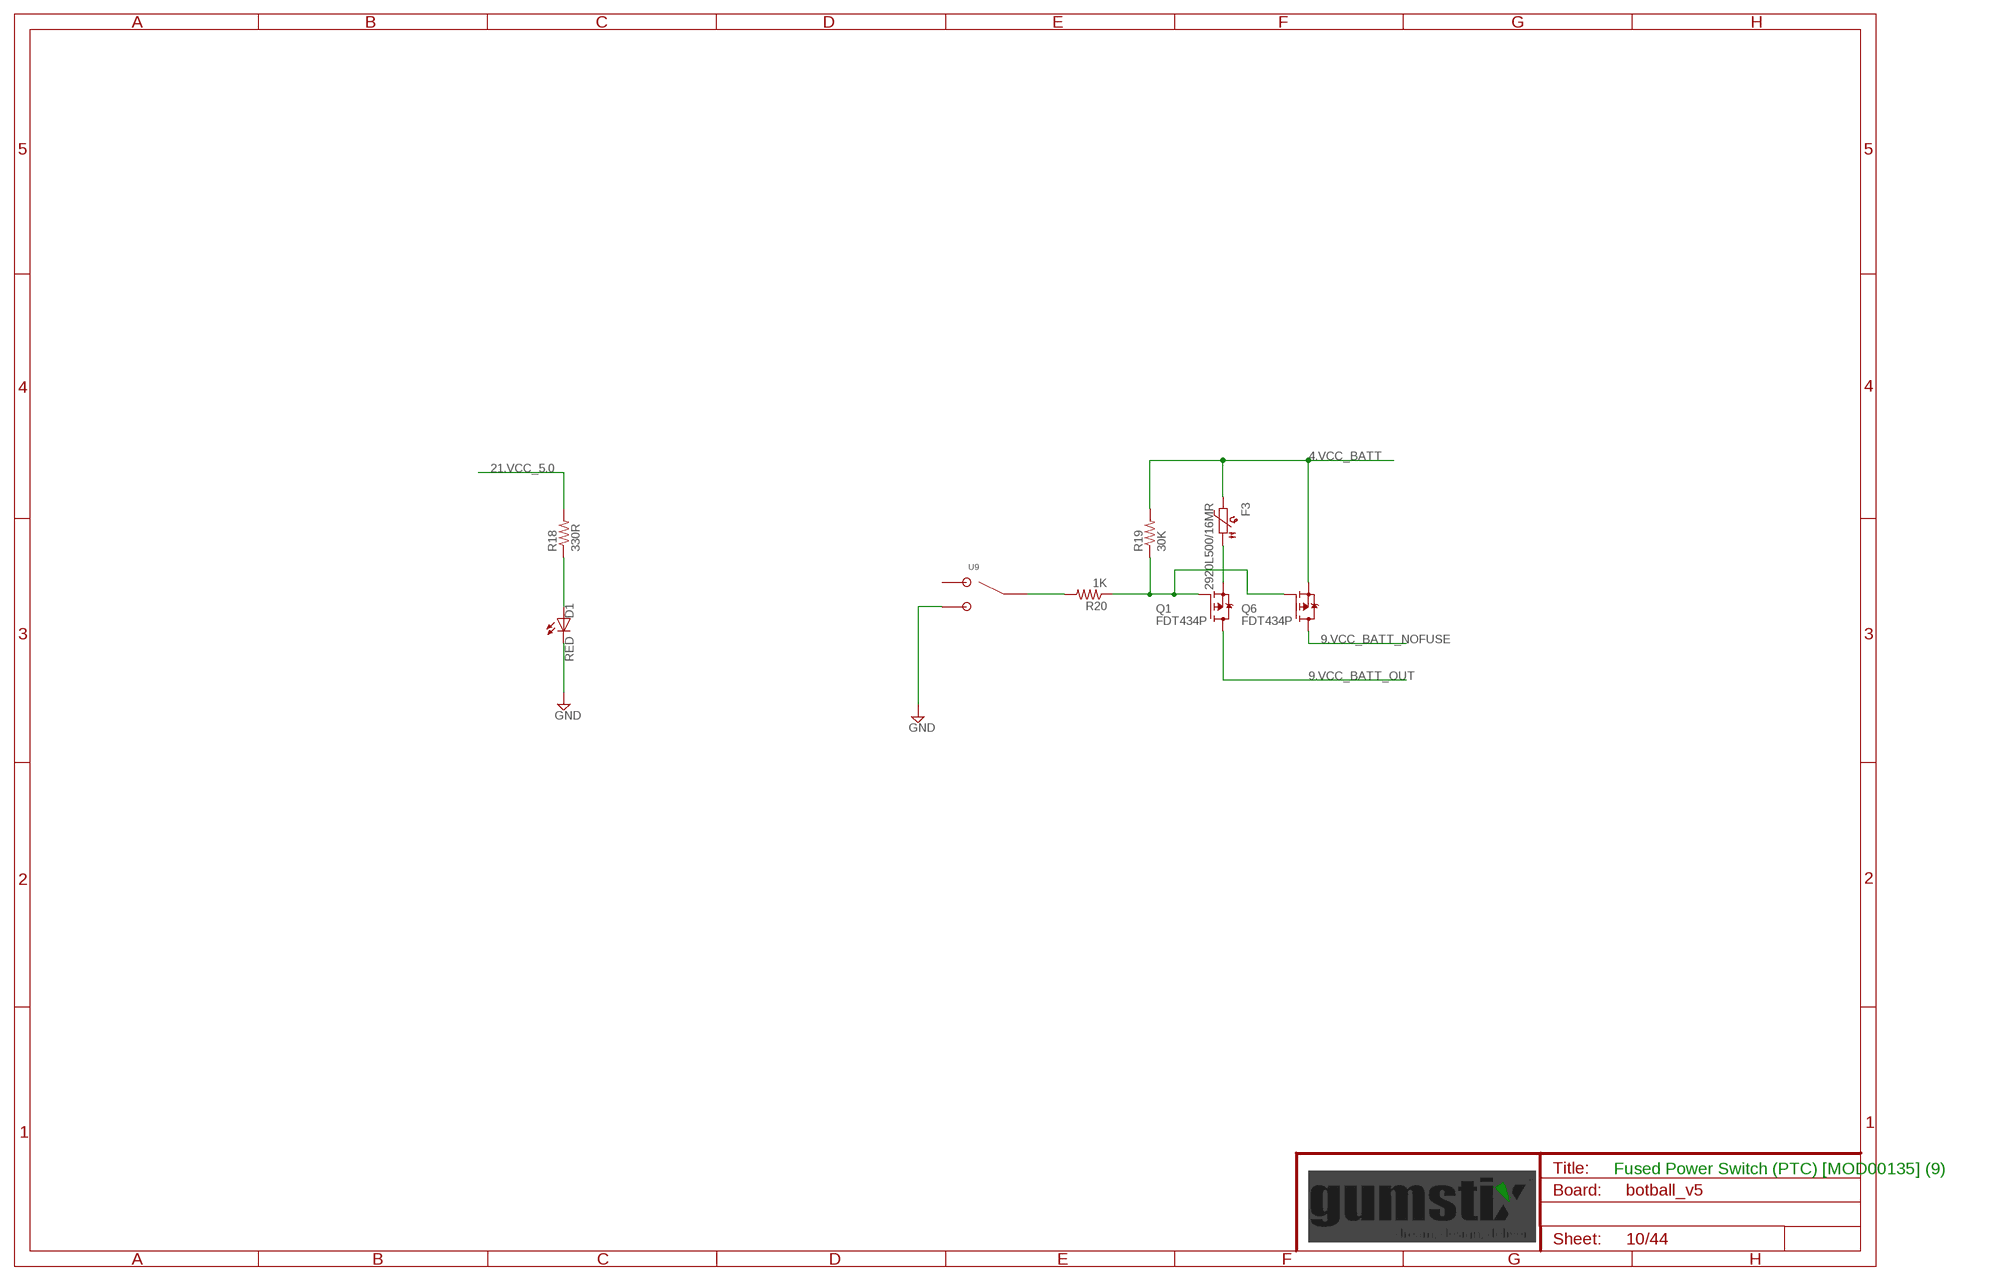
[diagram p9: schematic, sheet 10]

### Parts
D1  RED  LED0603  [D0603]
F3  2920L500/16MR  PTC2920  [2920]
Q1  FDT434P  BSP170P  [SOT223]
Q6  FDT434P  BSP170P  [SOT223]
R18  330R  R0201  [0201]
R19  30K  R0201  [0201]
R20  1K  R0201  [0201]
U9  JS102011SAQN  [JS102011SAQN]

### Nets
4.VCC_BATT [supply]: F3.2 Q6.3(S) R19.2 ; also sheet 5,36
9.VCC_BATT_NOFUSE: Q6.2(D) Q6.4(D) ; also sheet 19,22
9.VCC_BATT_OUT [supply]: Q1.2(D) Q1.4(D) ; also sheet 7,31
21.VCC_5.0 [supply]: R18.2 ; also sheet 2,3,7,8,13,15,21,22,25,27,28,31,32,34,39,40,43
COM$9: R20.2 U9.2
GATE$9: Q1.1(G) Q6.1(G) R19.1 R20.1
GND: D1.C U9.3 ; also sheet 2,3,4,5,6,7,9,11,12,13,14,15,16,17,18,19,20,21,22,23,24,25,26,27,28,29,30,31,32,33,34,35,36,37,38,39,40,41,42,43,44
LED+$9 [supply]: D1.A R18.1
SOURCE$9 [supply]: F3.1 Q1.3(S)
Unconnected: U9.1

### Notes on the sheet
- Fused Power Switch (PTC) [MOD00135] (9)

## Sheet 11 of 44
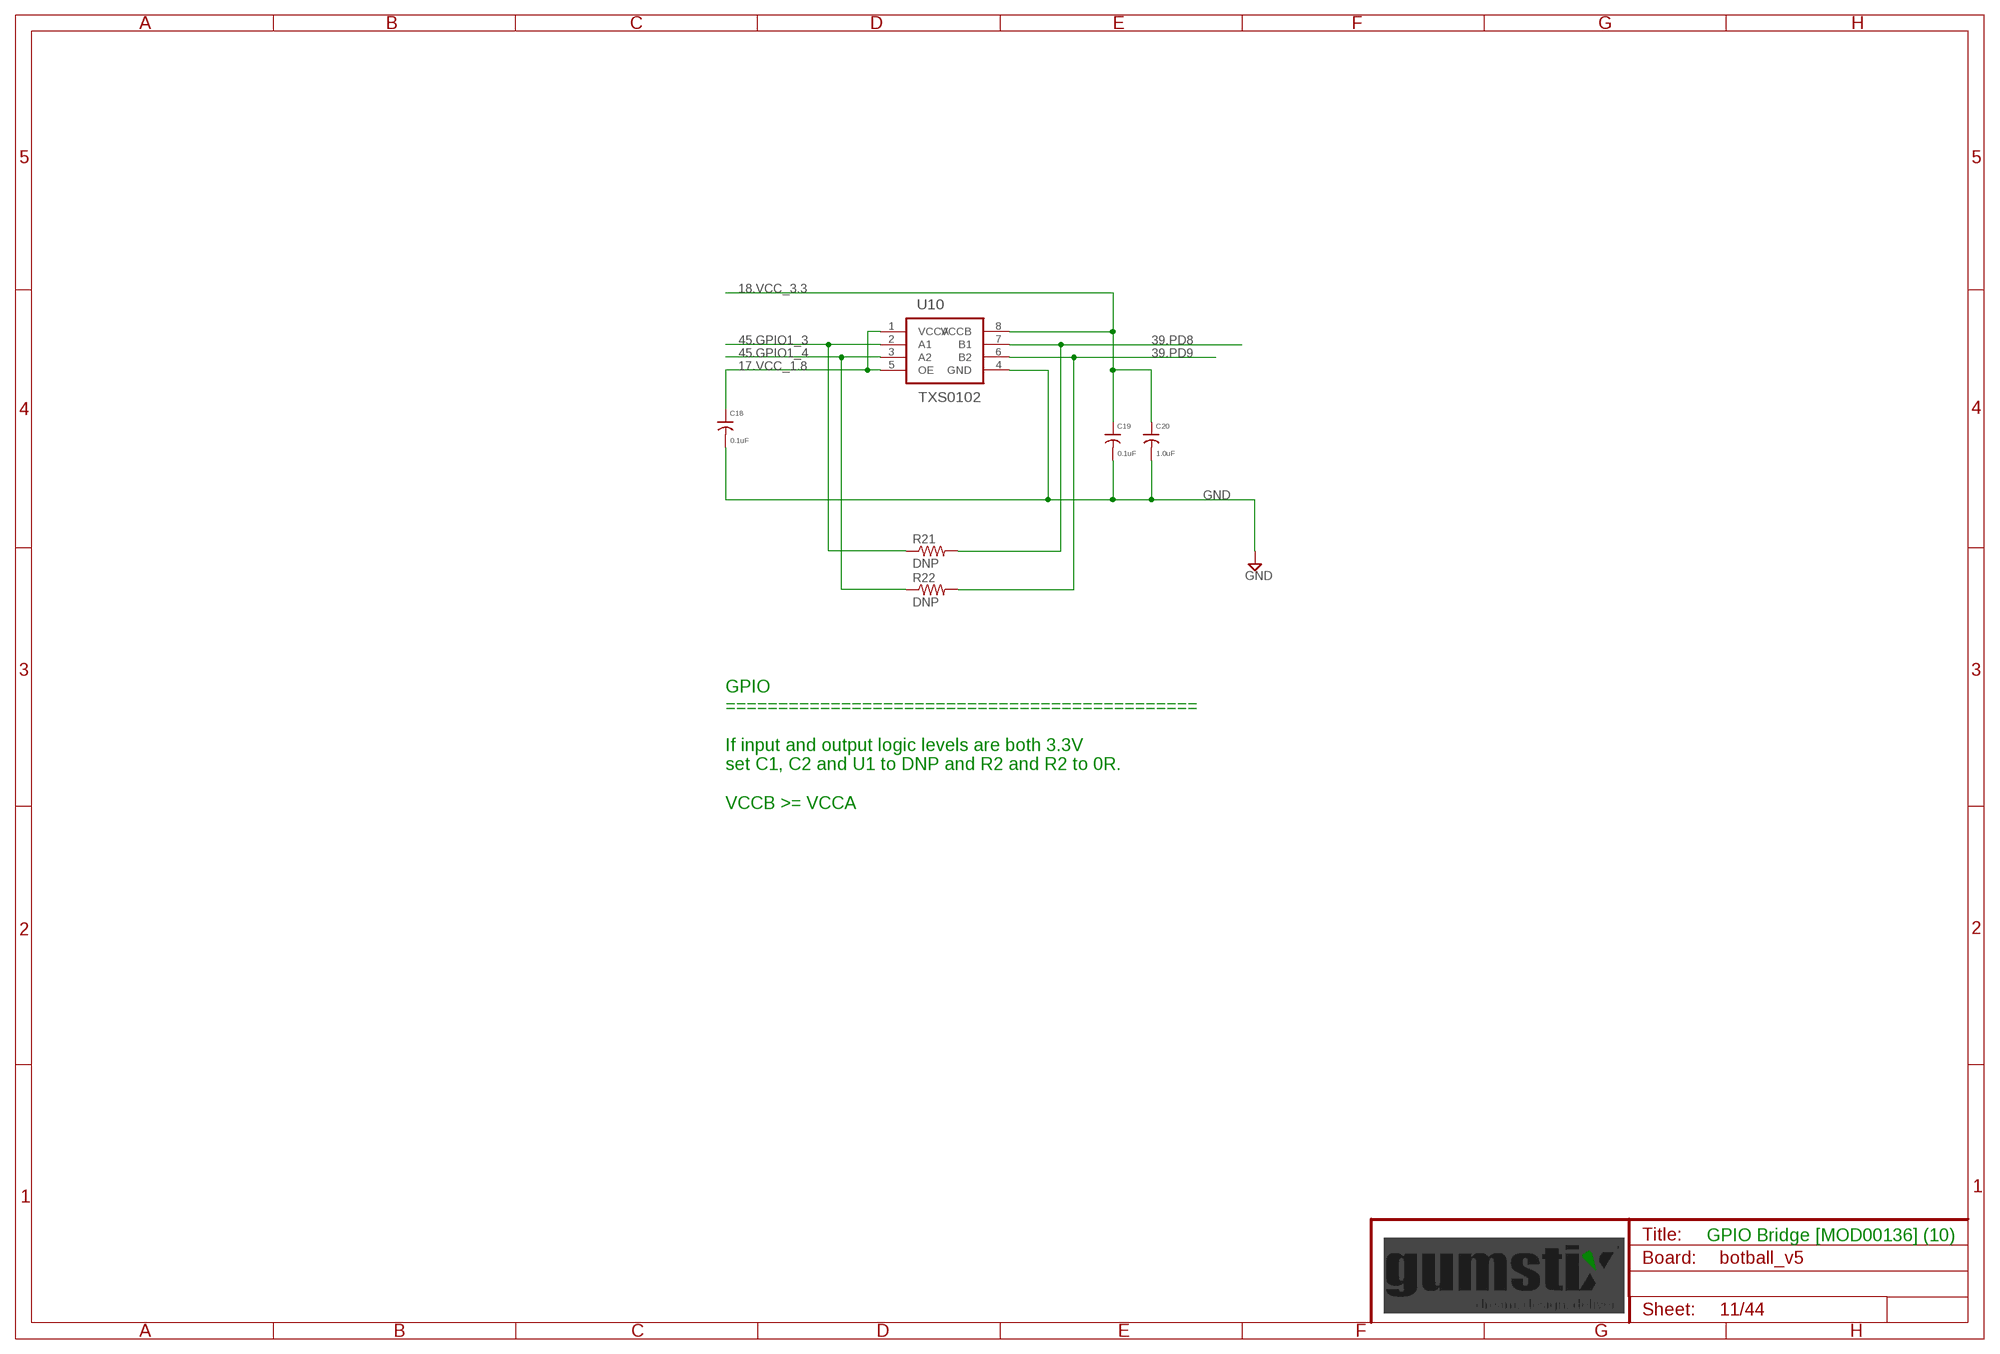
[diagram p10: schematic, sheet 11]

### Parts
C18  0.1uF  C0201  [0201]
C19  0.1uF  C0201  [0201]
C20  1.0uF  C0201  [0201]
R21  DNP  R0201  [0201]
R22  DNP  R0201  [0201]
U10  TXS0102  [DFN8-0.4P]

### Nets
17.VCC_1.8 [supply]: C18.1 U10.1(VCCA) U10.5(OE) ; also sheet 2,6,9,16,17,18,32,33,37,38,39
18.VCC_3.3 [supply]: C19.1 C20.1 U10.8(VCCB) ; also sheet 3,4,7,9,12,13,14,16,17,18,19,20,21,23,24,25,26,27,28,29,31,33,34,36,37,38,39
39.PD8: R21.2 U10.7(B1) ; also sheet 36
39.PD9: R22.2 U10.6(B2) ; also sheet 36
45.GPIO1_3: R21.1 U10.2(A1) ; also sheet 42
45.GPIO1_4: R22.1 U10.3(A2) ; also sheet 42
GND: C18.2 C19.2 C20.2 U10.4(GND) ; also sheet 2,3,4,5,6,7,9,10,12,13,14,15,16,17,18,19,20,21,22,23,24,25,26,27,28,29,30,31,32,33,34,35,36,37,38,39,40,41,42,43,44

### Notes on the sheet
- GPIO
  =============================================
  
  If input and output logic levels are both 3.3V
  set C1, C2 and U1 to DNP and R2 and R2 to 0R.
  
  VCCB >= VCCA
- GPIO Bridge [MOD00136] (10)

## Sheet 12 of 44
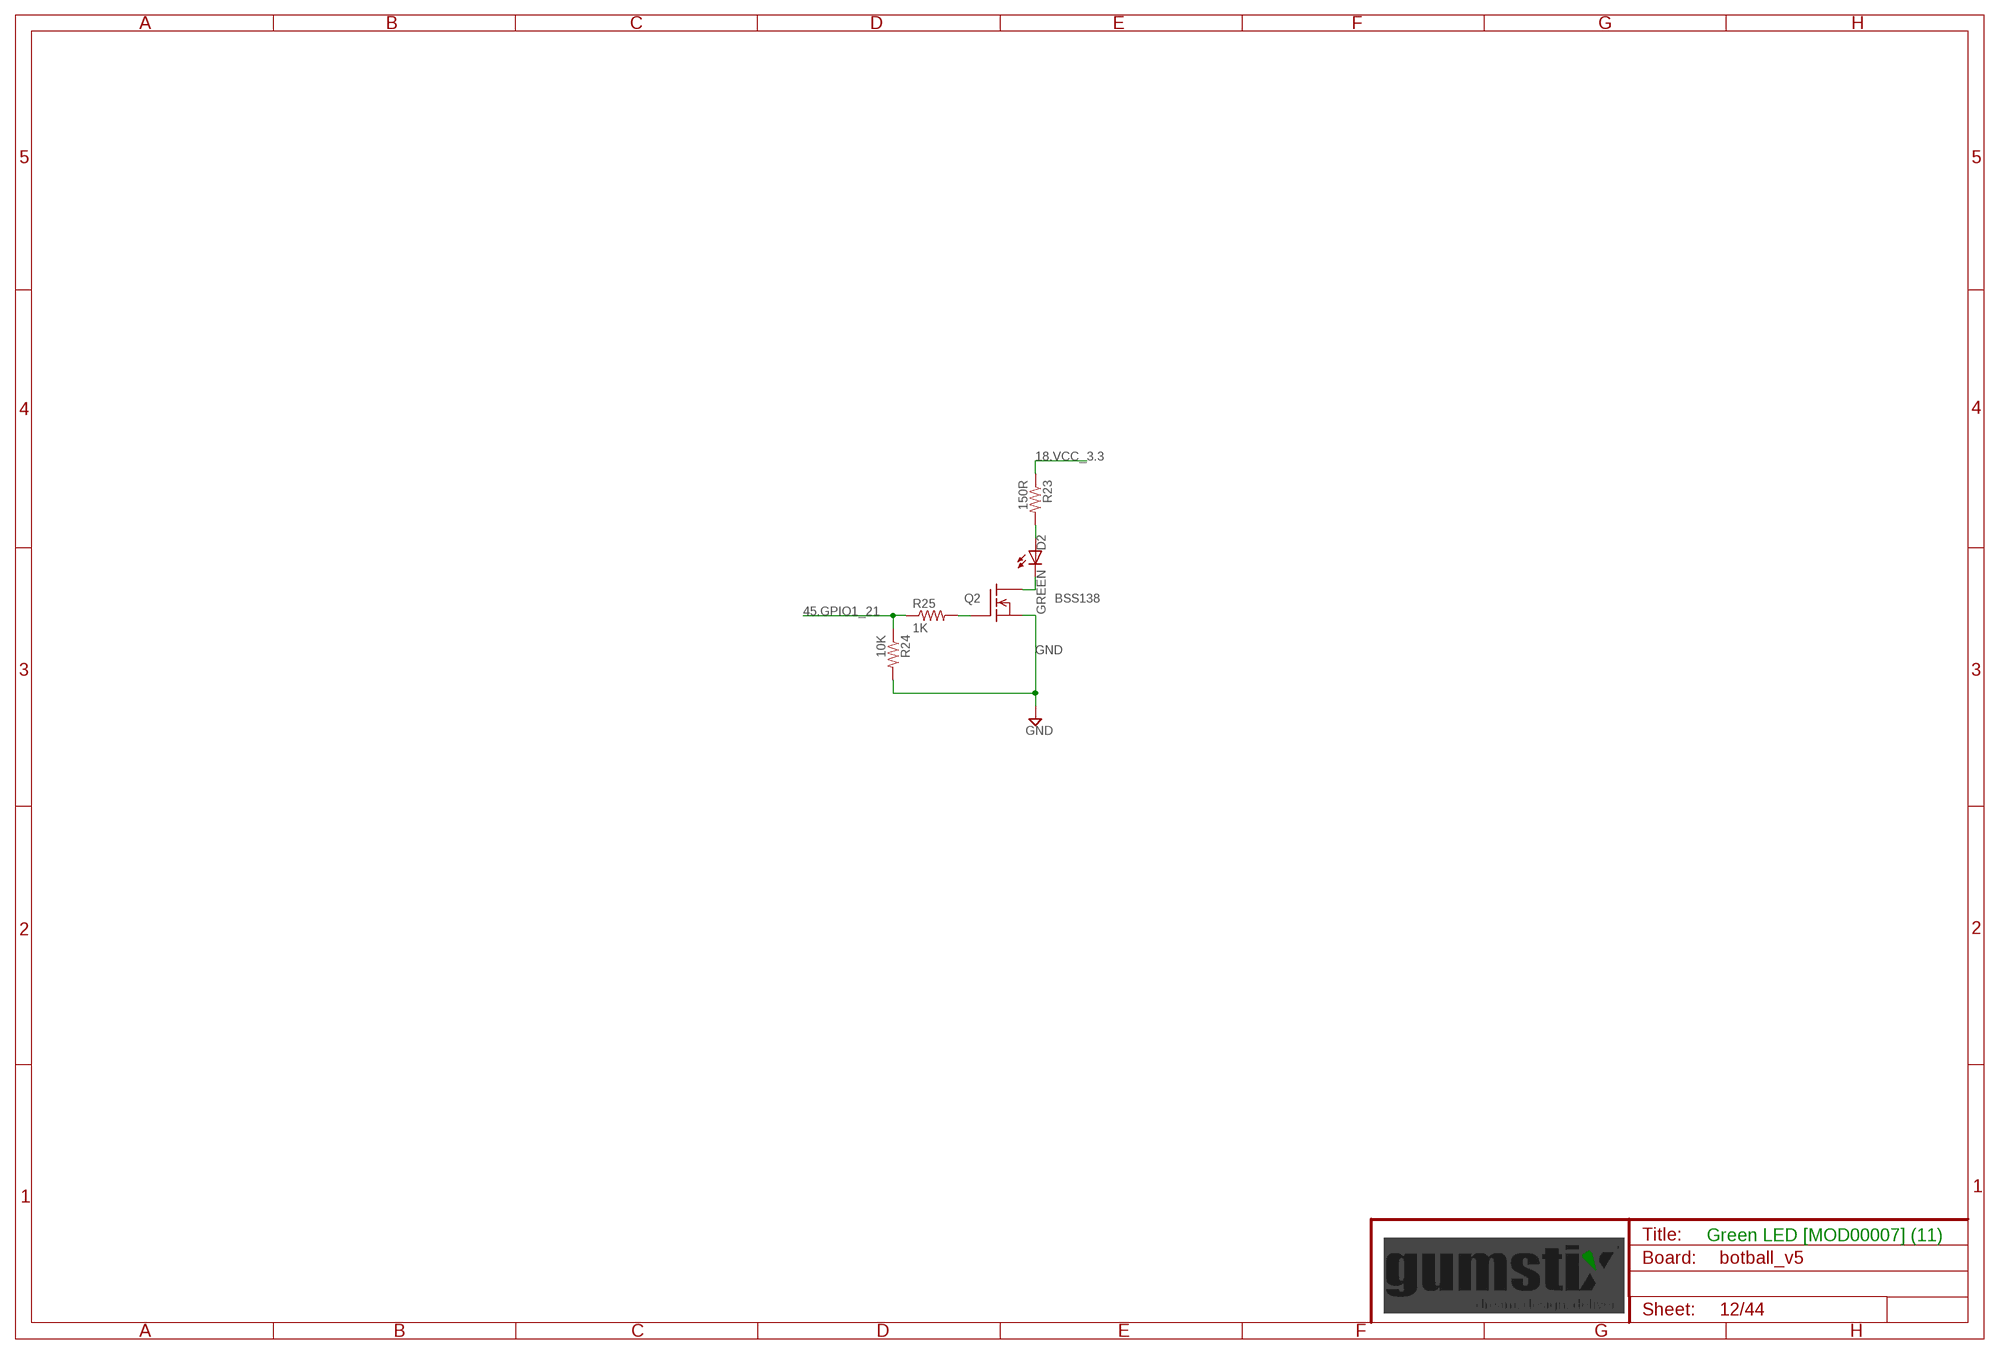
[diagram p11: schematic, sheet 12]

### Parts
D2  GREEN  LED0603  [D0603]
Q2  BSS138  [SOT23]
R23  150R  R0402  [0402]
R24  10K  R0402  [0402]
R25  1K  R0402  [0402]

### Nets
18.VCC_3.3 [supply]: R23.1 ; also sheet 3,4,7,9,11,13,14,16,17,18,19,20,21,23,24,25,26,27,28,29,31,33,34,36,37,38,39
45.GPIO1_21: R24.1 R25.1 ; also sheet 42
GND: Q2.2(S) R24.2 ; also sheet 2,3,4,5,6,7,9,10,11,13,14,15,16,17,18,19,20,21,22,23,24,25,26,27,28,29,30,31,32,33,34,35,36,37,38,39,40,41,42,43,44
N1$11: D2.A R23.2
N2$11: D2.C Q2.3(D)
N3$11: Q2.1(G) R25.2

### Notes on the sheet
- Green LED [MOD00007] (11)

## Sheet 13 of 44
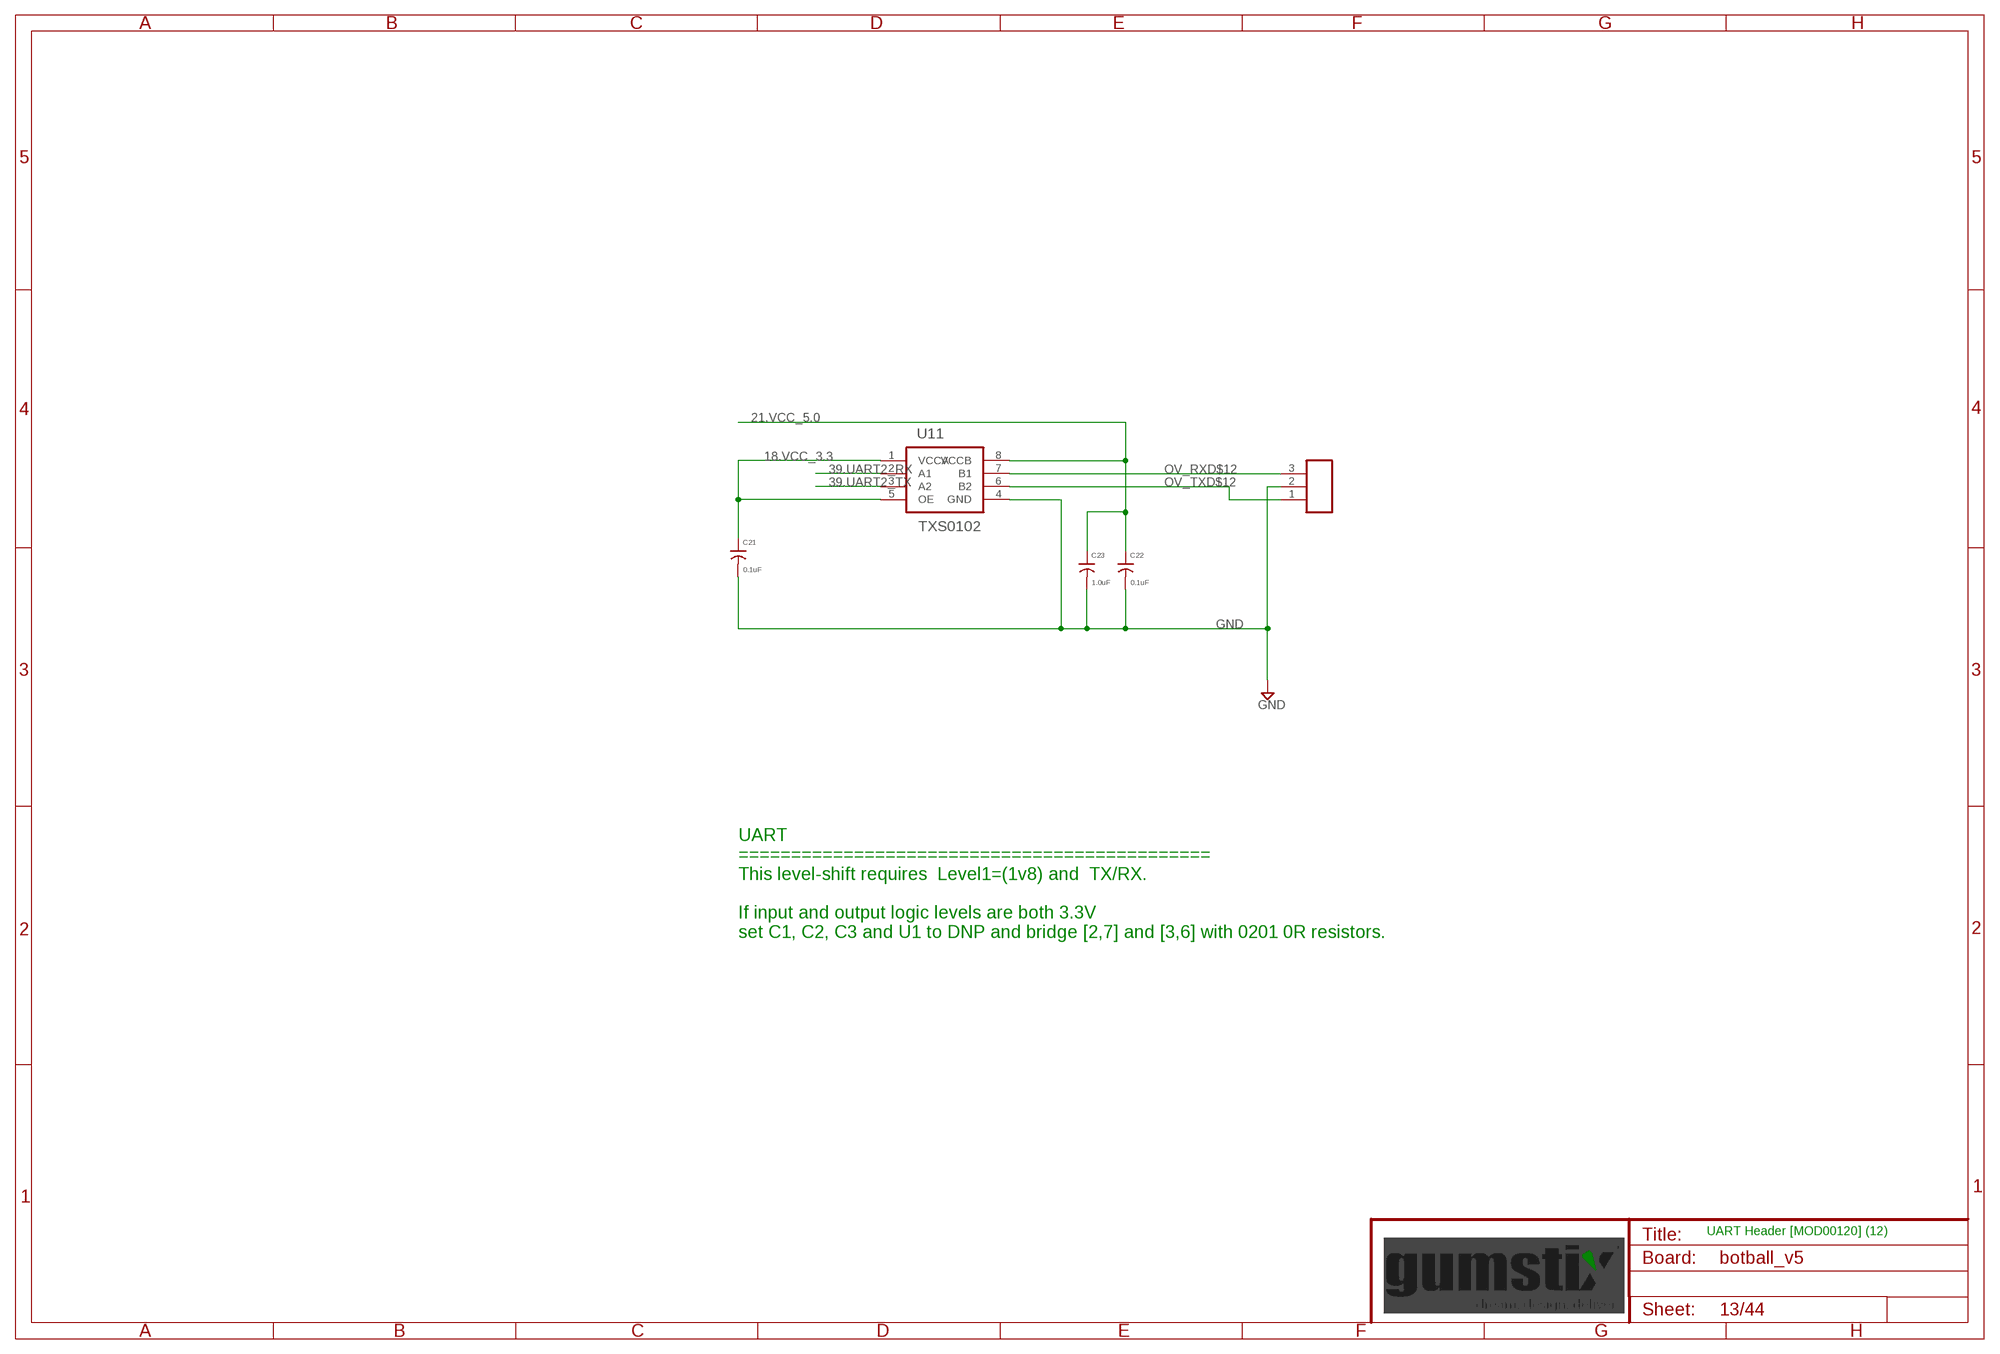
[diagram p12: schematic, sheet 13]

### Parts
C21  0.1uF  C0201  [0201]
C22  0.1uF  C0201  [0201]
C23  1.0uF  C0402  [0402]
J6  DNP  MA03X1100  [MA03-100]
U11  TXS0102  [DFN8-0.4P]

### Nets
18.VCC_3.3 [supply]: C21.1 U11.1(VCCA) U11.5(OE) ; also sheet 3,4,7,9,11,12,14,16,17,18,19,20,21,23,24,25,26,27,28,29,31,33,34,36,37,38,39
21.VCC_5.0 [supply]: C22.1 C23.1 U11.8(VCCB) ; also sheet 2,3,7,8,10,15,21,22,25,27,28,31,32,34,39,40,43
39.UART2_RX: U11.2(A1) ; also sheet 36
39.UART2_TX: U11.3(A2) ; also sheet 36
GND: C21.2 C22.2 C23.2 J6.2 U11.4(GND) ; also sheet 2,3,4,5,6,7,9,10,11,12,14,15,16,17,18,19,20,21,22,23,24,25,26,27,28,29,30,31,32,33,34,35,36,37,38,39,40,41,42,43,44
OV_RXD$12: J6.3 U11.7(B1)
OV_TXD$12: J6.1 U11.6(B2)

### Notes on the sheet
- UART
  =============================================
  This level-shift requires  Level1=(1v8) and  TX/RX.
  
  If input and output logic levels are both 3.3V
  set C1, C2, C3 and U1 to DNP and bridge [2,7] and [3,6] with 0201 0R resistors.
- UART Header [MOD00120] (12)

## Sheet 14 of 44
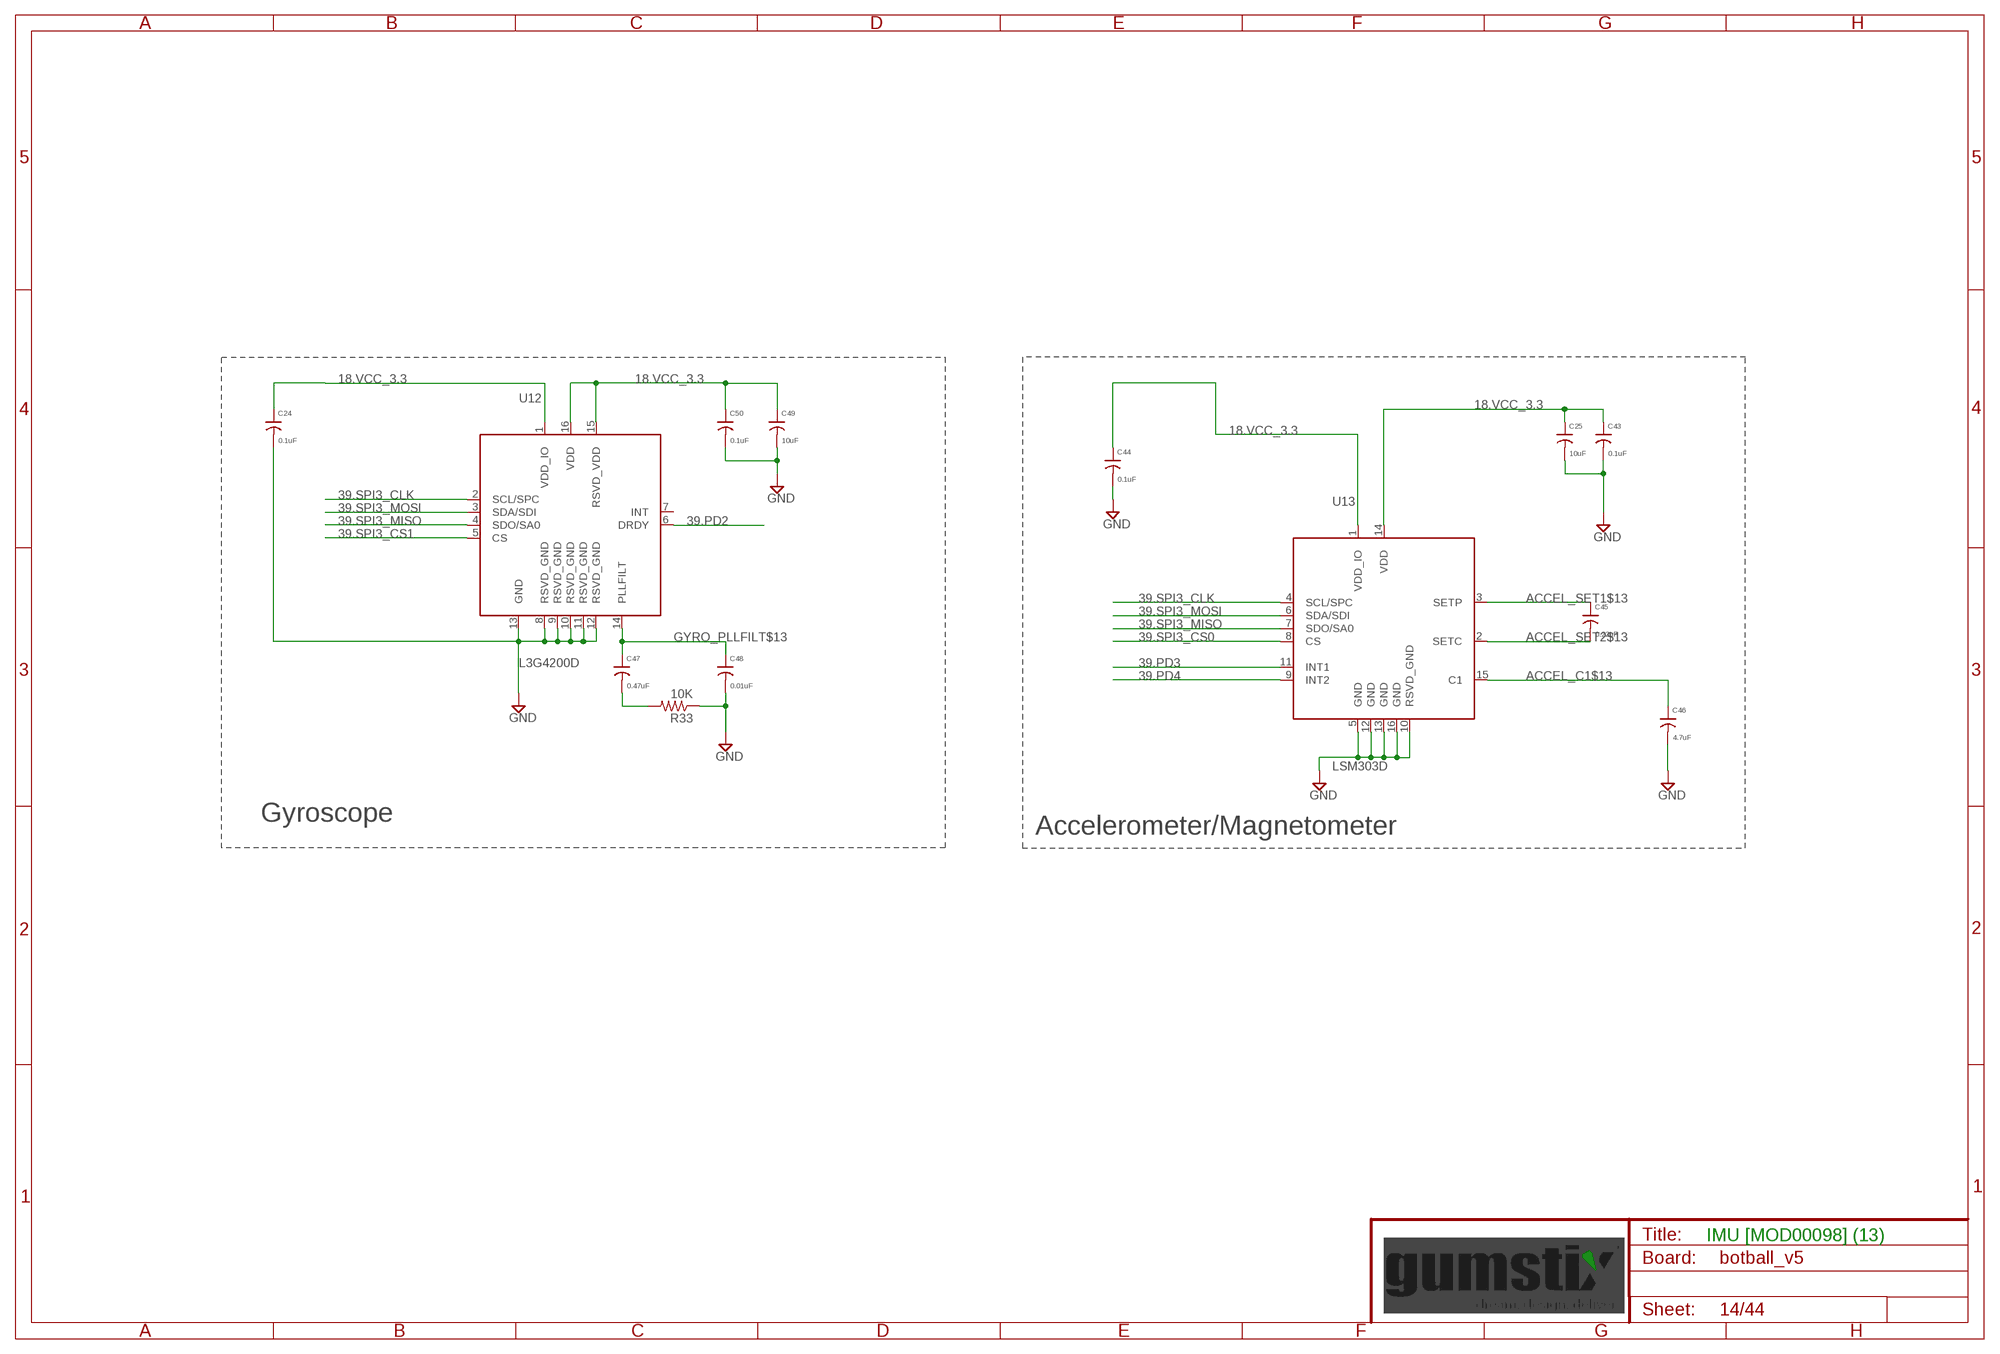
[diagram p13: schematic, sheet 14]

### Parts
C24  0.1uF  C0201  [0201]
C25  10uF  C0402  [0402]
C43  0.1uF  C0201  [0201]
C44  0.1uF  C0201  [0201]
C45  0.22uF  C0402  [0402]
C46  4.7uF  C0603  [0603]
C47  0.47uF  C0402  [0402]
C48  0.01uF  C0201  [0201]
C49  10uF  C0402  [0402]
C50  0.1uF  C0201  [0201]
R33  10K  R0201  [0201]
U12  L3G4200D  [LGA16-4X4MM]
U13  LSM303D  LSM303DLGA  [LGA16-3X3MM]

### Nets
18.VCC_3.3 [supply]: C24.1 C25.1 C43.1 C44.1 C49.1 C50.1 U12.1(VDD_IO) U12.15(RSVD_VDD) U12.16(VDD) U13.1(VDD_IO) U13.14(VDD) ; also sheet 3,4,7,9,11,12,13,16,17,18,19,20,21,23,24,25,26,27,28,29,31,33,34,36,37,38,39
39.PD2: U12.6(DRDY) ; also sheet 36
39.PD3: U13.11(INT1) ; also sheet 36
39.PD4: U13.9(INT2) ; also sheet 36
39.SPI3_CLK: U12.2(SCL/SPC) U13.4(SCL/SPC) ; also sheet 36
39.SPI3_CS0: U13.8(CS) ; also sheet 36
39.SPI3_CS1: U12.5(CS) ; also sheet 36
39.SPI3_MISO: U12.4(SDO/SA0) U13.7(SDO/SA0) ; also sheet 36
39.SPI3_MOSI: U12.3(SDA/SDI) U13.6(SDA/SDI) ; also sheet 36
ACCEL_C1$13: C46.1 U13.15(C1)
ACCEL_SET1$13: C45.1 U13.3(SETP)
ACCEL_SET2$13: C45.2 U13.2(SETC)
GND: C24.2 C25.2 C43.2 C44.2 C46.2 C48.2 C49.2 C50.2 R33.1 U12.8(RSVD_GND) U12.9(RSVD_GND) U12.10(RSVD_GND) U12.11(RSVD_GND) U12.12(RSVD_GND) U12.13(GND) U13.5(GND) U13.10(RSVD_GND) U13.12(GND) U13.13(GND) U13.16(GND) ; also sheet 2,3,4,5,6,7,9,10,11,12,13,15,16,17,18,19,20,21,22,23,24,25,26,27,28,29,30,31,32,33,34,35,36,37,38,39,40,41,42,43,44
GYRO_PLLFILT$13: C47.1 C48.1 U12.14(PLLFILT)
GYRO_PLLFILT_CR$13: C47.2 R33.2
Unconnected: U12.7(INT)

### Notes on the sheet
- Gyroscope
- Accelerometer/Magnetometer
- IMU [MOD00098] (13)

## Sheet 15 of 44
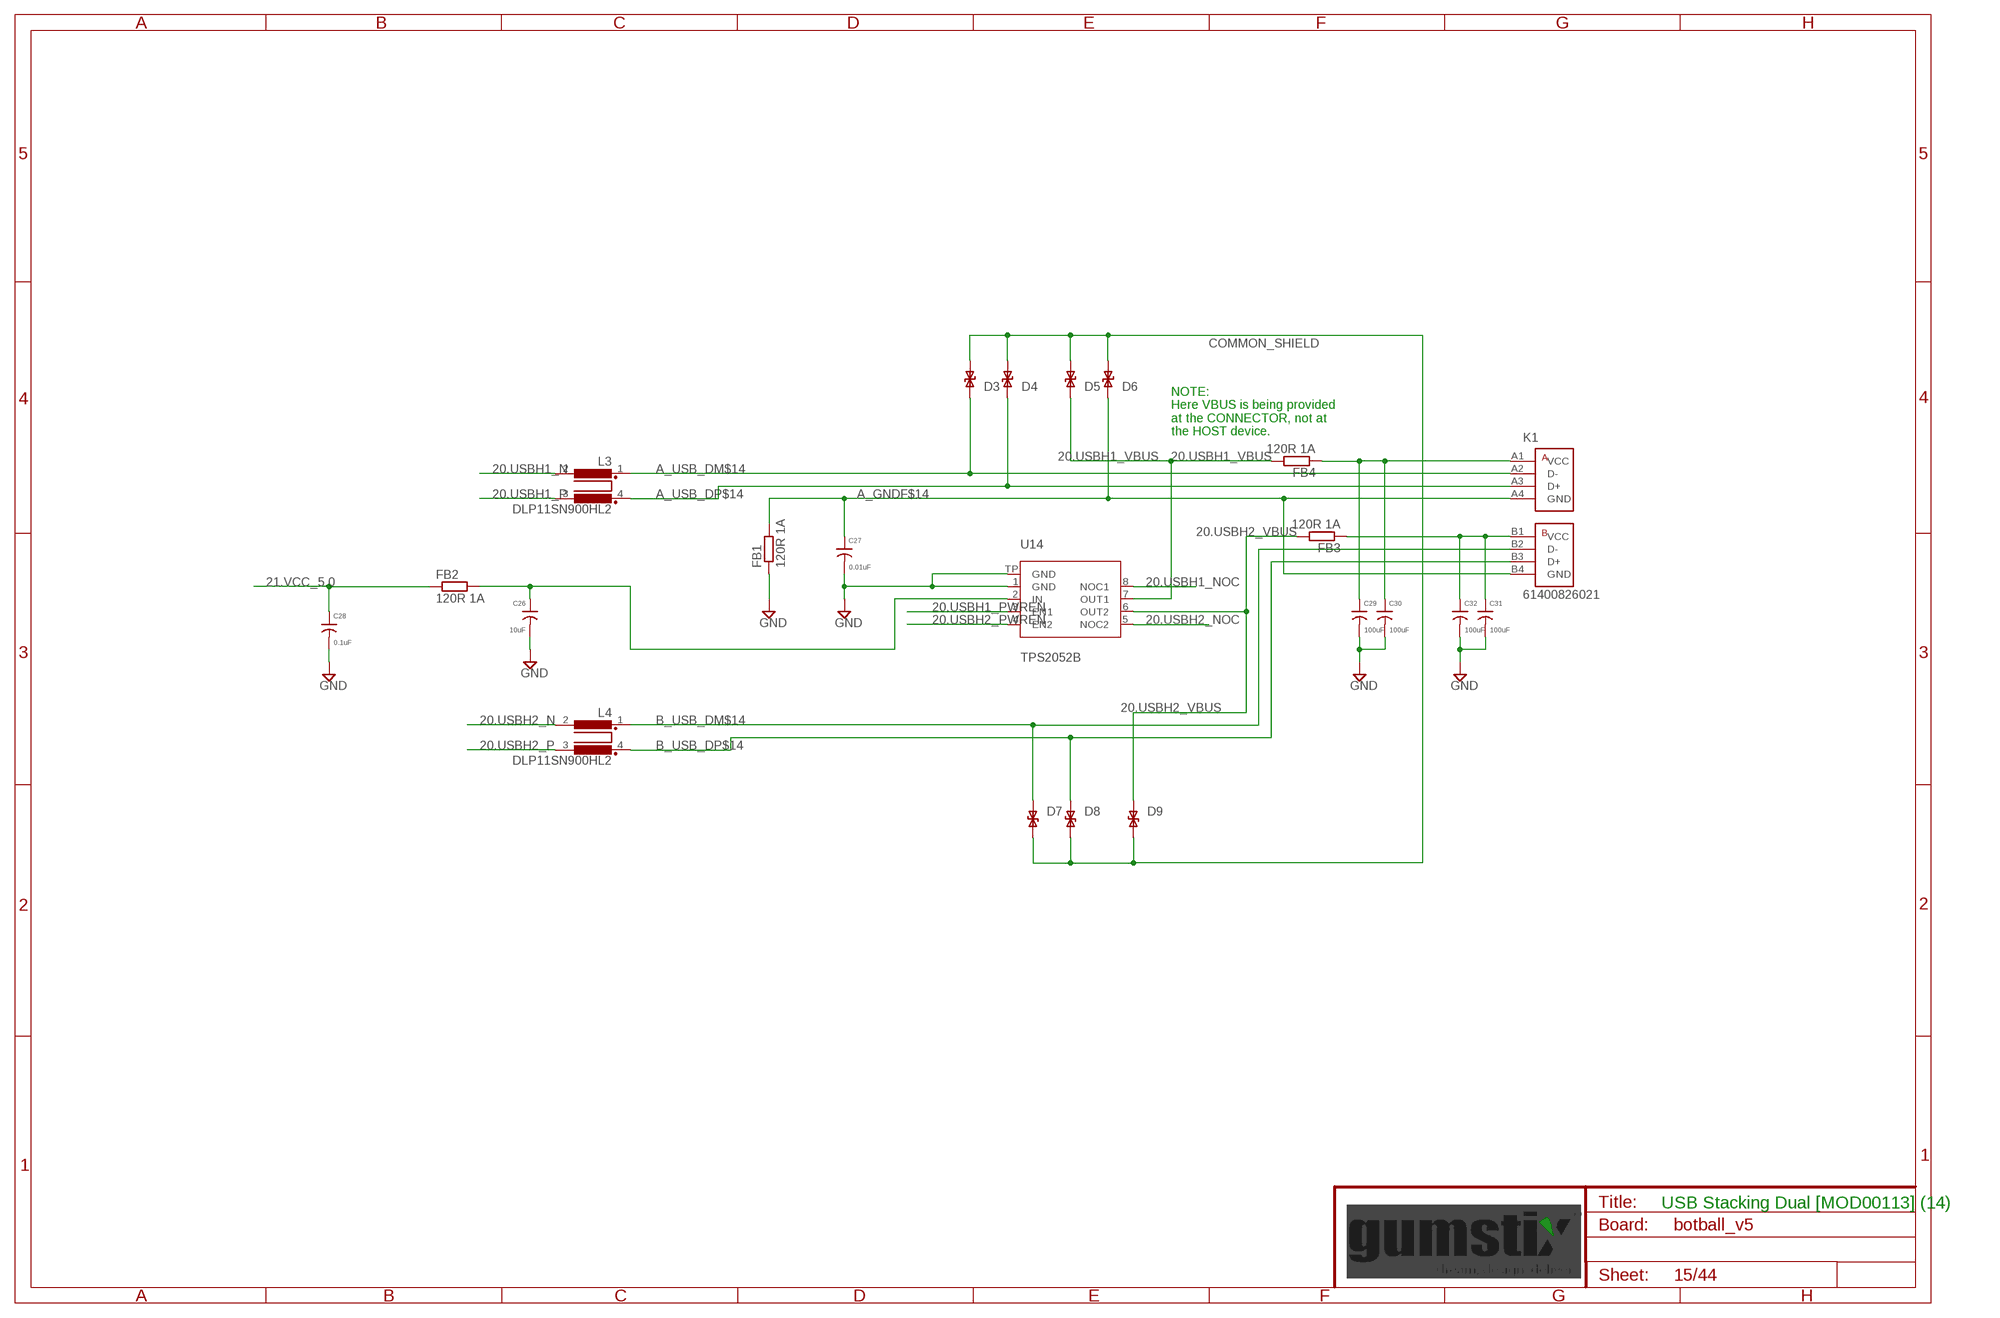
[diagram p14: schematic, sheet 15]

### Parts
C26  10uF  C0603  [0603]
C27  0.01uF  C0402  [0402]
C28  0.1uF  C0402  [0402]
C29  100uF  C1206  [1206]
C30  100uF  C1206  [1206]
C31  100uF  C1206  [1206]
C32  100uF  C1206  [1206]
D3  PS04LTVA1  ESD-DIODE  [D0402]
D4  PS04LTVA1  ESD-DIODE  [D0402]
D5  B72590D50A060  ESD-DIODE  [D0402]
D6  B72590D50A060  ESD-DIODE  [D0402]
D7  PS04LTVA1  ESD-DIODE  [D0402]
D8  PS04LTVA1  ESD-DIODE  [D0402]
D9  B72590D50A060  ESD-DIODE  [D0402]
FB1  120R 1A  FB0402  [0402]
FB2  120R 1A  FB0402  [0402]
FB3  120R 1A  FB0402  [0402]
FB4  120R 1A  FB0402  [0402]
K1  61400826021  [61400826021]
L3  DLP11SN900HL2  COM_MODE_CHOKE  [0504-DLP11S]
L4  DLP11SN900HL2  COM_MODE_CHOKE  [0504-DLP11S]
U14  TPS2052B  TPS2052  [MSOP8-PAD]

### Nets
20.USBH1_N [USB]: L3.2 ; also sheet 21
20.USBH1_NOC: U14.8(NOC1) ; also sheet 21
20.USBH1_P [USB]: L3.3 ; also sheet 21
20.USBH1_PWREN: U14.3(EN1) ; also sheet 21
20.USBH1_VBUS [supply]: D5.P2 FB4.2 U14.7(OUT1) ; also sheet 21
20.USBH2_N [USB]: L4.2 ; also sheet 21
20.USBH2_NOC: U14.5(NOC2) ; also sheet 21
20.USBH2_P [USB]: L4.3 ; also sheet 21
20.USBH2_PWREN: U14.4(EN2) ; also sheet 21
20.USBH2_VBUS [supply]: D9.P2 FB3.2 U14.6(OUT2) ; also sheet 21
21.VCC_5.0 [supply]: C28.1 FB2.1 ; also sheet 2,3,7,8,10,13,21,22,25,27,28,31,32,34,39,40,43
A_GNDF$14 [supply]: C27.1 D6.P2 FB1.2 K1.A4(GND) K1.B4(GND)
A_USB_DM$14 [USB]: D3.P2 K1.A2(D-) L3.1
A_USB_DP$14 [USB]: D4.P2 K1.A3(D+) L3.4
A_VBUS_$14 [supply]: C29.1 C30.1 FB4.1 K1.A1(VCC)
B_USB_DM$14 [USB]: D7.P2 K1.B2(D-) L4.1
B_USB_DP$14 [USB]: D8.P2 K1.B3(D+) L4.4
B_VBUS_$14 [supply]: C31.1 C32.1 FB3.1 K1.B1(VCC)
COMMON_SHIELD [supply]: D3.P1 D4.P1 D5.P1 D6.P1 D7.P1 D8.P1 D9.P1 ; also sheet 30,35,39
GND: C26.2 C27.2 C28.2 C29.2 C30.2 C31.2 C32.2 FB1.1 U14.1(GND) U14.TP(GND) ; also sheet 2,3,4,5,6,7,9,10,11,12,13,14,16,17,18,19,20,21,22,23,24,25,26,27,28,29,30,31,32,33,34,35,36,37,38,39,40,41,42,43,44
VBUSF$14 [supply]: C26.1 FB2.2 U14.2(IN)

### Notes on the sheet
- NOTE:
  Here VBUS is being provided
  at the CONNECTOR, not at
  the HOST device.
- USB Stacking Dual [MOD00113] (14)

## Sheet 16 of 44
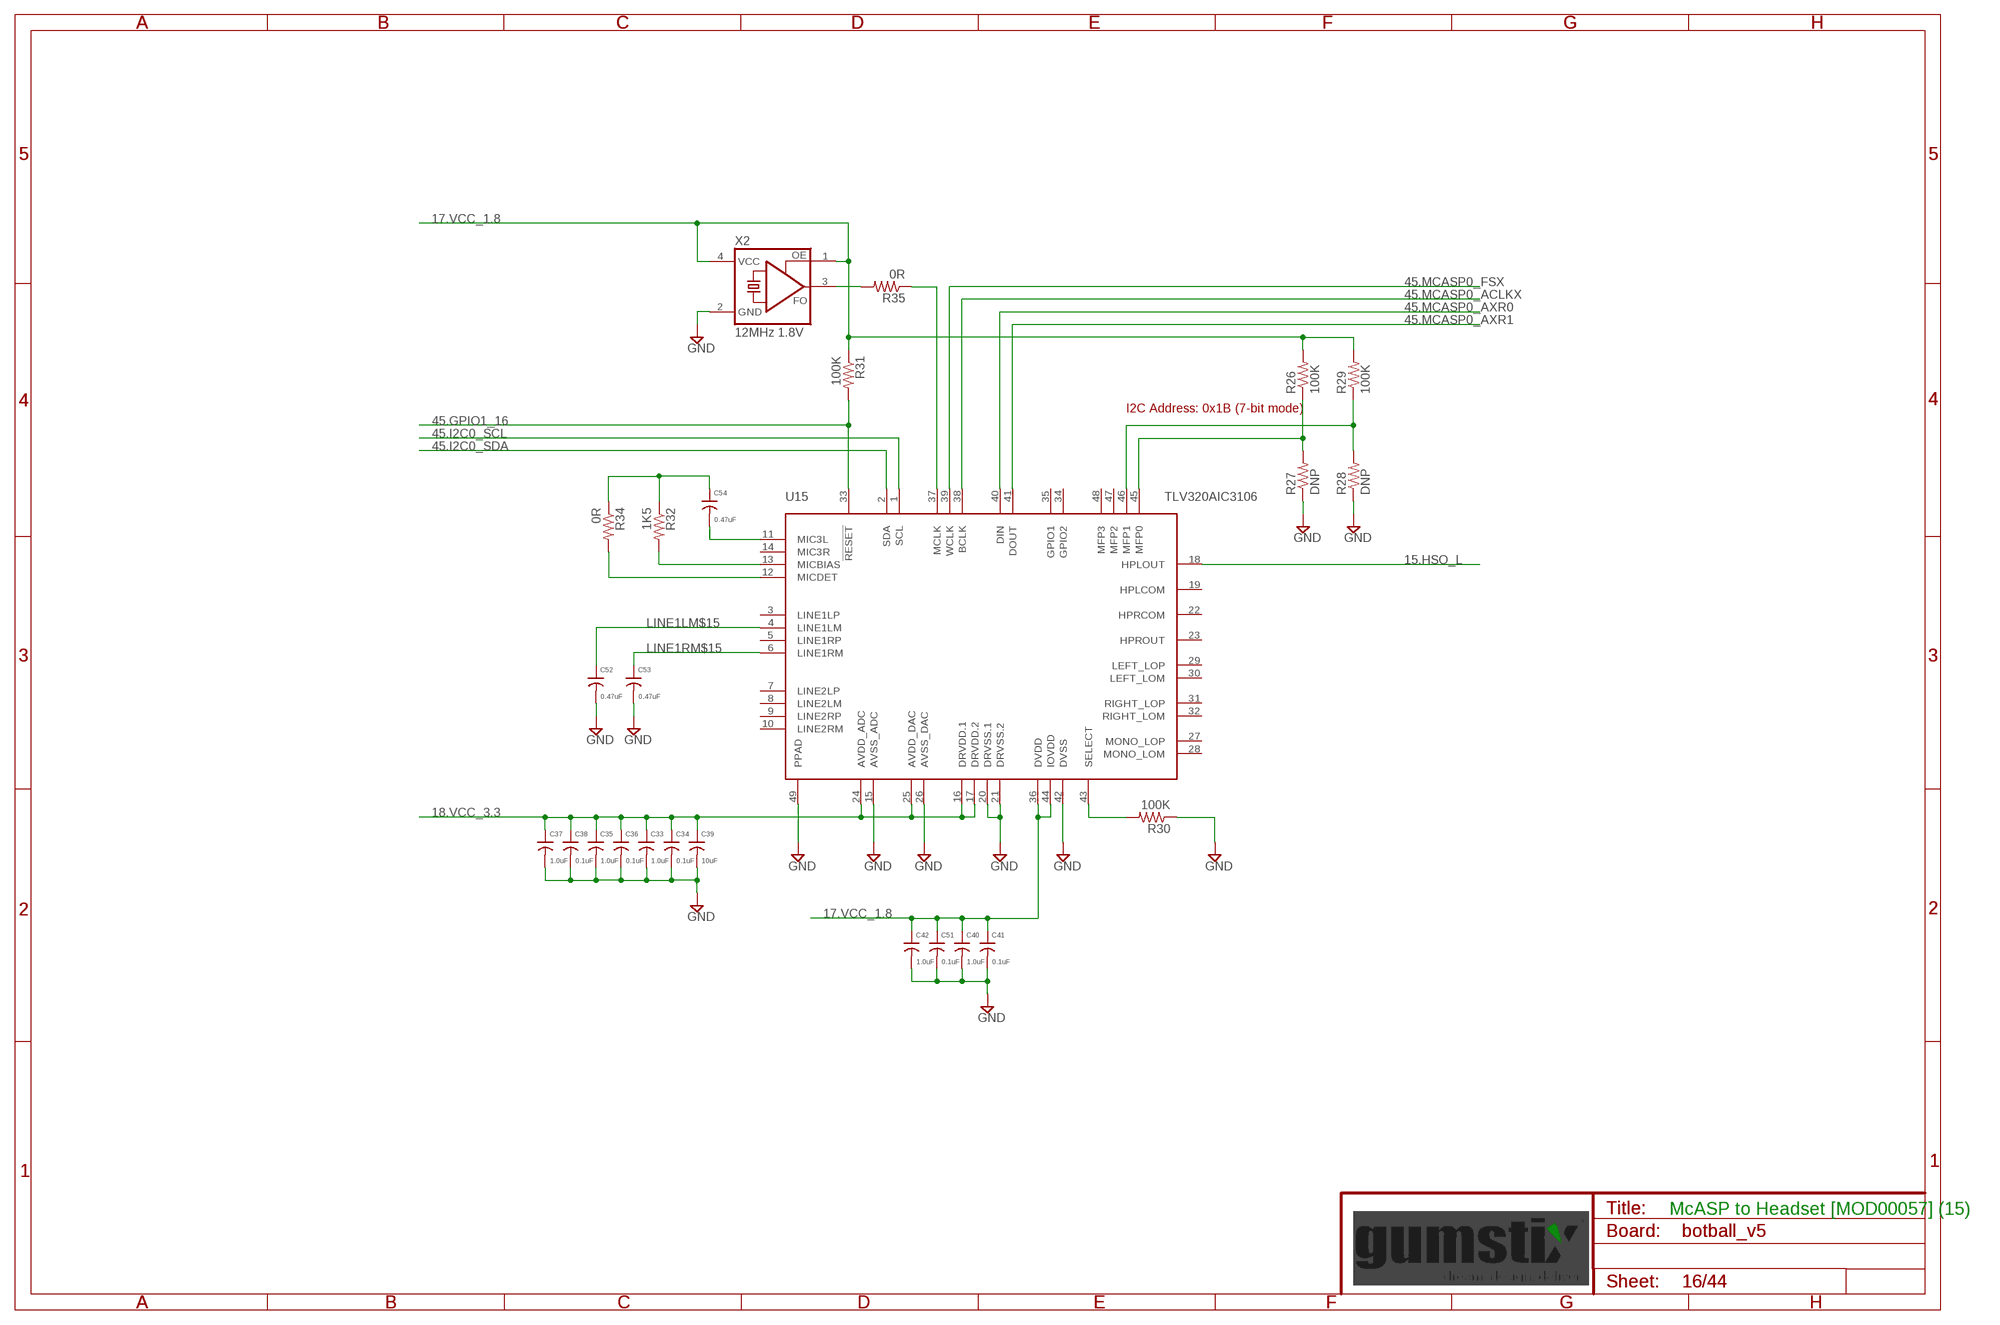
[diagram p15: schematic, sheet 16]

### Parts
C33  1.0uF  C0402  [0402]
C34  0.1uF  C0201  [0201]
C35  1.0uF  C0402  [0402]
C36  0.1uF  C0201  [0201]
C37  1.0uF  C0402  [0402]
C38  0.1uF  C0201  [0201]
C39  10uF  C0603  [0603]
C40  1.0uF  C0402  [0402]
C41  0.1uF  C0201  [0201]
C42  1.0uF  C0402  [0402]
C51  0.1uF  C0201  [0201]
C52  0.47uF  C0402  [0402]
C53  0.47uF  C0402  [0402]
C54  0.47uF  C0402  [0402]
R26  100K  R0201  [0201]
R27  DNP  R0201  [0201]
R28  DNP  R0201  [0201]
R29  100K  R0201  [0201]
R30  100K  R0201  [0201]
R31  100K  R0201  [0201]
R32  1K5  R0201  [0201]
R34  0R  R0201  [0201]
R35  0R  R0201  [0201]
U15  TLV320AIC3106  [QFN48]
X2  12MHz 1.8V  ASF1  [ASF]

### Nets
15.HSO_L: U15.18(HPLOUT) ; also sheet 20
17.VCC_1.8 [supply]: C40.1 C41.1 C42.1 C51.1 R26.2 R29.2 R31.1 U15.36(DVDD) U15.44(IOVDD) X2.1(OE) X2.4(VCC) ; also sheet 2,6,9,11,17,18,32,33,37,38,39
18.VCC_3.3 [supply]: C33.1 C34.1 C35.1 C36.1 C37.1 C38.1 C39.1 U15.16(DRVDD.1) U15.17(DRVDD.2) U15.24(AVDD_ADC) U15.25(AVDD_DAC) ; also sheet 3,4,7,9,11,12,13,14,17,18,19,20,21,23,24,25,26,27,28,29,31,33,34,36,37,38,39
45.GPIO1_16: R31.2 U15.33(!RESET) ; also sheet 42
45.I2C0_SCL: U15.1(SCL) ; also sheet 40,41,42
45.I2C0_SDA: U15.2(SDA) ; also sheet 40,41,42
45.MCASP0_ACLKX: U15.38(BCLK) ; also sheet 43
45.MCASP0_AXR0: U15.40(DIN) ; also sheet 43
45.MCASP0_AXR1: U15.41(DOUT) ; also sheet 43
45.MCASP0_FSX: U15.39(WCLK) ; also sheet 43
AUD_CLK$15: R35.2 X2.3(FO)
AUD_MCLK$15: R35.1 U15.37(MCLK)
AUDIO_SELECT_SPI$15: R30.2 U15.43(SELECT)
GND: C33.2 C34.2 C35.2 C36.2 C37.2 C38.2 C39.2 C40.2 C41.2 C42.2 C51.2 C52.2 C53.2 R27.1 R28.1 R30.1 U15.15(AVSS_ADC) U15.20(DRVSS.1) U15.21(DRVSS.2) U15.26(AVSS_DAC) U15.42(DVSS) U15.49(PPAD) X2.2(GND) ; also sheet 2,3,4,5,6,7,9,10,11,12,13,14,15,17,18,19,20,21,22,23,24,25,26,27,28,29,30,31,32,33,34,35,36,37,38,39,40,41,42,43,44
LINE1LM$15: C52.1 U15.4(LINE1LM)
LINE1RM$15: C53.1 U15.6(LINE1RM)
MFP0$15: R26.1 R27.2 U15.45(MFP0)
MFP1$15: R28.2 R29.1 U15.46(MFP1)
MIC3_LR$15: C54.2 U15.11(MIC3L)
MIC$15: C54.1 R32.1 R34.1
MICBIAS$15: R32.2 U15.13(MICBIAS)
MICDET$15: R34.2 U15.12(MICDET)
Unconnected: U15.3(LINE1LP) U15.5(LINE1RP) U15.7(LINE2LP) U15.8(LINE2LM) U15.9(LINE2RP) U15.10(LINE2RM) U15.14(MIC3R) U15.19(HPLCOM) U15.22(HPRCOM) U15.23(HPROUT) U15.27(MONO_LOP) U15.28(MONO_LOM) U15.29(LEFT_LOP) U15.30(LEFT_LOM) U15.31(RIGHT_LOP) U15.32(RIGHT_LOM) U15.34(GPIO2) U15.35(GPIO1) U15.47(MFP2) U15.48(MFP3)

### Notes on the sheet
- I2C Address: 0x1B (7-bit mode)
- McASP to Headset [MOD00057] (15)

## Sheet 17 of 44
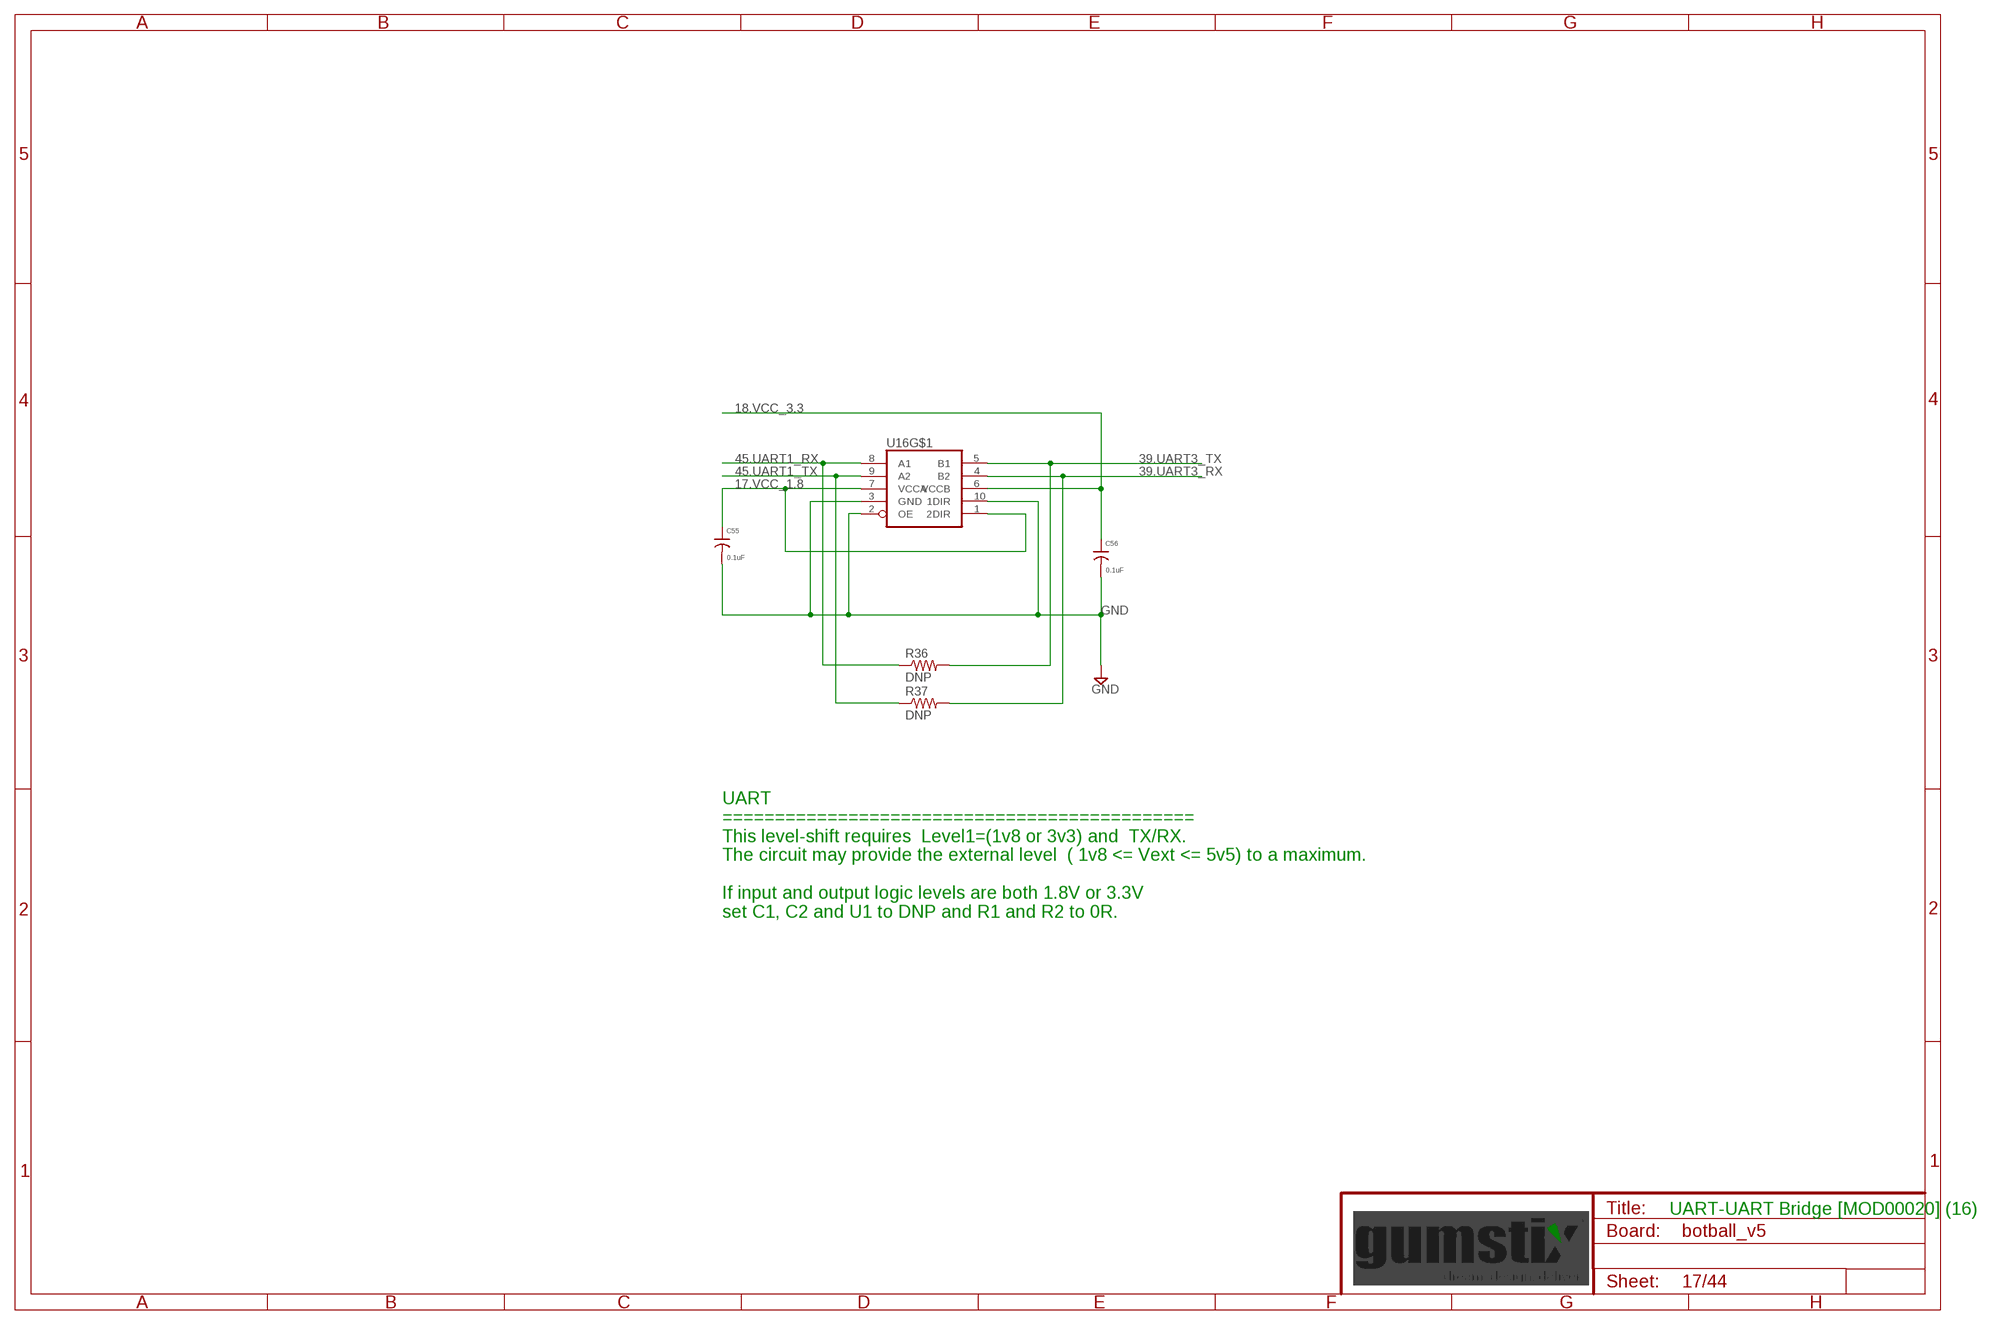
[diagram p16: schematic, sheet 17]

### Parts
C55  0.1uF  C0201  [0201]
C56  0.1uF  C0201  [0201]
R36  DNP  R0201  [0201]
R37  DNP  R0201  [0201]
U16  74AVC2T245  [UQFN-10]

### Nets
17.VCC_1.8 [supply]: C55.1 U16.1(2DIR) U16.7(VCCA) ; also sheet 2,6,9,11,16,18,32,33,37,38,39
18.VCC_3.3 [supply]: C56.1 U16.6(VCCB) ; also sheet 3,4,7,9,11,12,13,14,16,18,19,20,21,23,24,25,26,27,28,29,31,33,34,36,37,38,39
39.UART3_RX: R37.2 U16.4(B2) ; also sheet 36
39.UART3_TX: R36.2 U16.5(B1) ; also sheet 36
45.UART1_RX: R36.1 U16.8(A1) ; also sheet 43
45.UART1_TX: R37.1 U16.9(A2) ; also sheet 43
GND: C55.2 C56.2 U16.2(OE) U16.3(GND) U16.10(1DIR) ; also sheet 2,3,4,5,6,7,9,10,11,12,13,14,15,16,18,19,20,21,22,23,24,25,26,27,28,29,30,31,32,33,34,35,36,37,38,39,40,41,42,43,44

### Notes on the sheet
- UART
  =============================================
  This level-shift requires  Level1=(1v8 or 3v3) and  TX/RX.
  The circuit may provide the external level  ( 1v8 <= Vext <= 5v5) to a maximum.
  
  If input and output logic levels are both 1.8V or 3.3V
  set C1, C2 and U1 to DNP and R1 and R2 to 0R.
- UART-UART Bridge [MOD00020] (16)

## Sheet 18 of 44
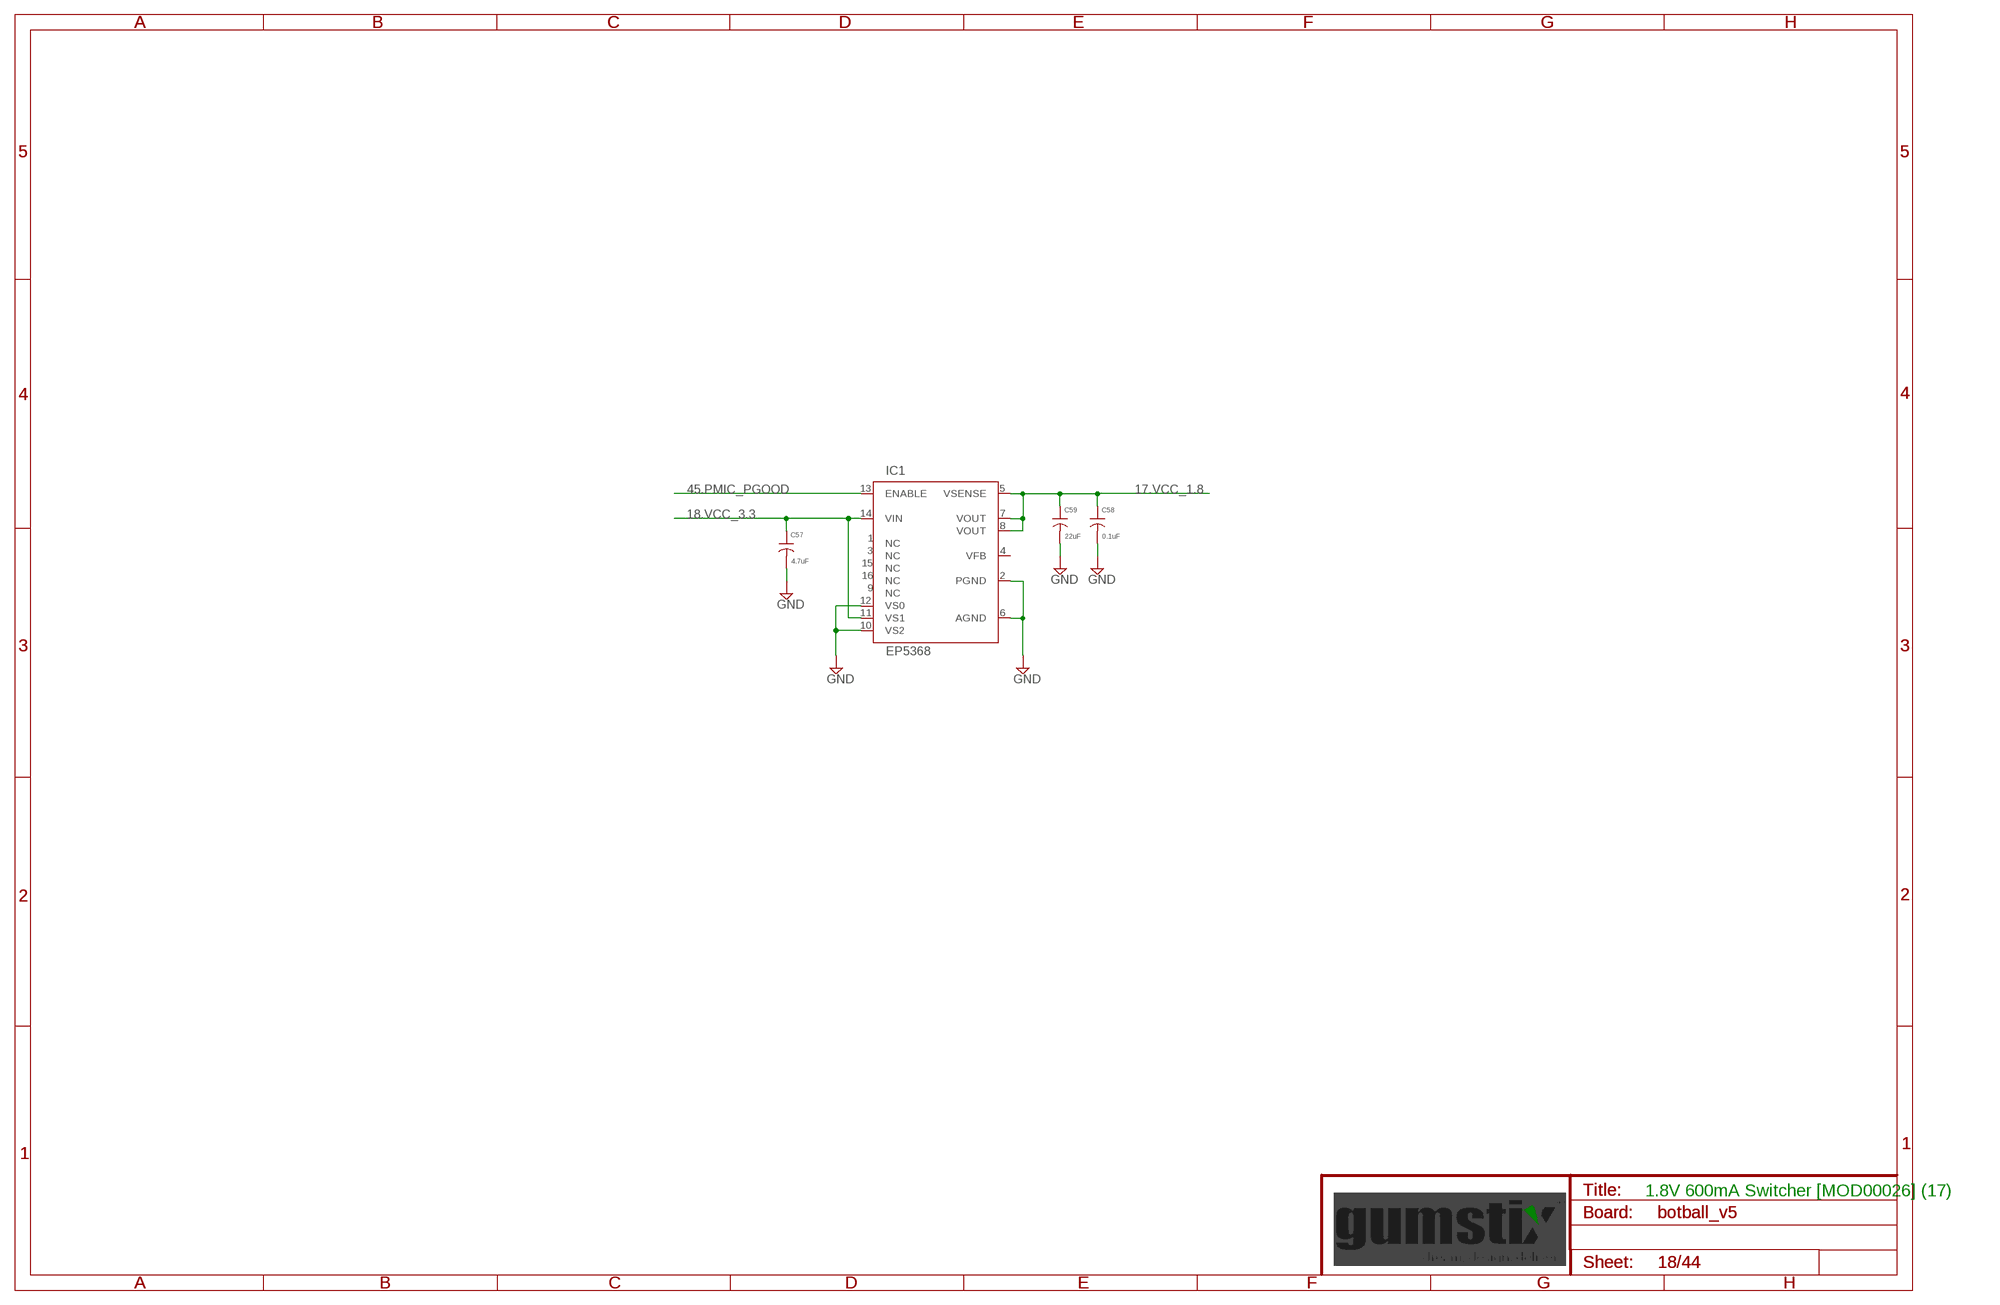
[diagram p17: schematic, sheet 18]

### Parts
C57  4.7uF  C0603  [0603]
C58  0.1uF  C0201  [0201]
C59  22uF  C0805  [0805]
IC1  EP5368  [EP-3X3MMQFN16]

### Nets
17.VCC_1.8 [supply]: C58.1 C59.1 IC1.5(VSENSE) IC1.7(VOUT) IC1.8(VOUT) ; also sheet 2,6,9,11,16,17,32,33,37,38,39
18.VCC_3.3 [supply]: C57.1 IC1.11(VS1) IC1.14(VIN) ; also sheet 3,4,7,9,11,12,13,14,16,17,19,20,21,23,24,25,26,27,28,29,31,33,34,36,37,38,39
45.PMIC_PGOOD: IC1.13(ENABLE) ; also sheet 40,43
GND: C57.2 C58.2 C59.2 IC1.2(PGND) IC1.6(AGND) IC1.10(VS2) IC1.12(VS0) ; also sheet 2,3,4,5,6,7,9,10,11,12,13,14,15,16,17,19,20,21,22,23,24,25,26,27,28,29,30,31,32,33,34,35,36,37,38,39,40,41,42,43,44
Unconnected: IC1.1(NC) IC1.3(NC) IC1.4(VFB) IC1.9(NC) IC1.15(NC) IC1.16(NC)

### Notes on the sheet
- 1.8V 600mA Switcher [MOD00026] (17)

## Sheet 19 of 44
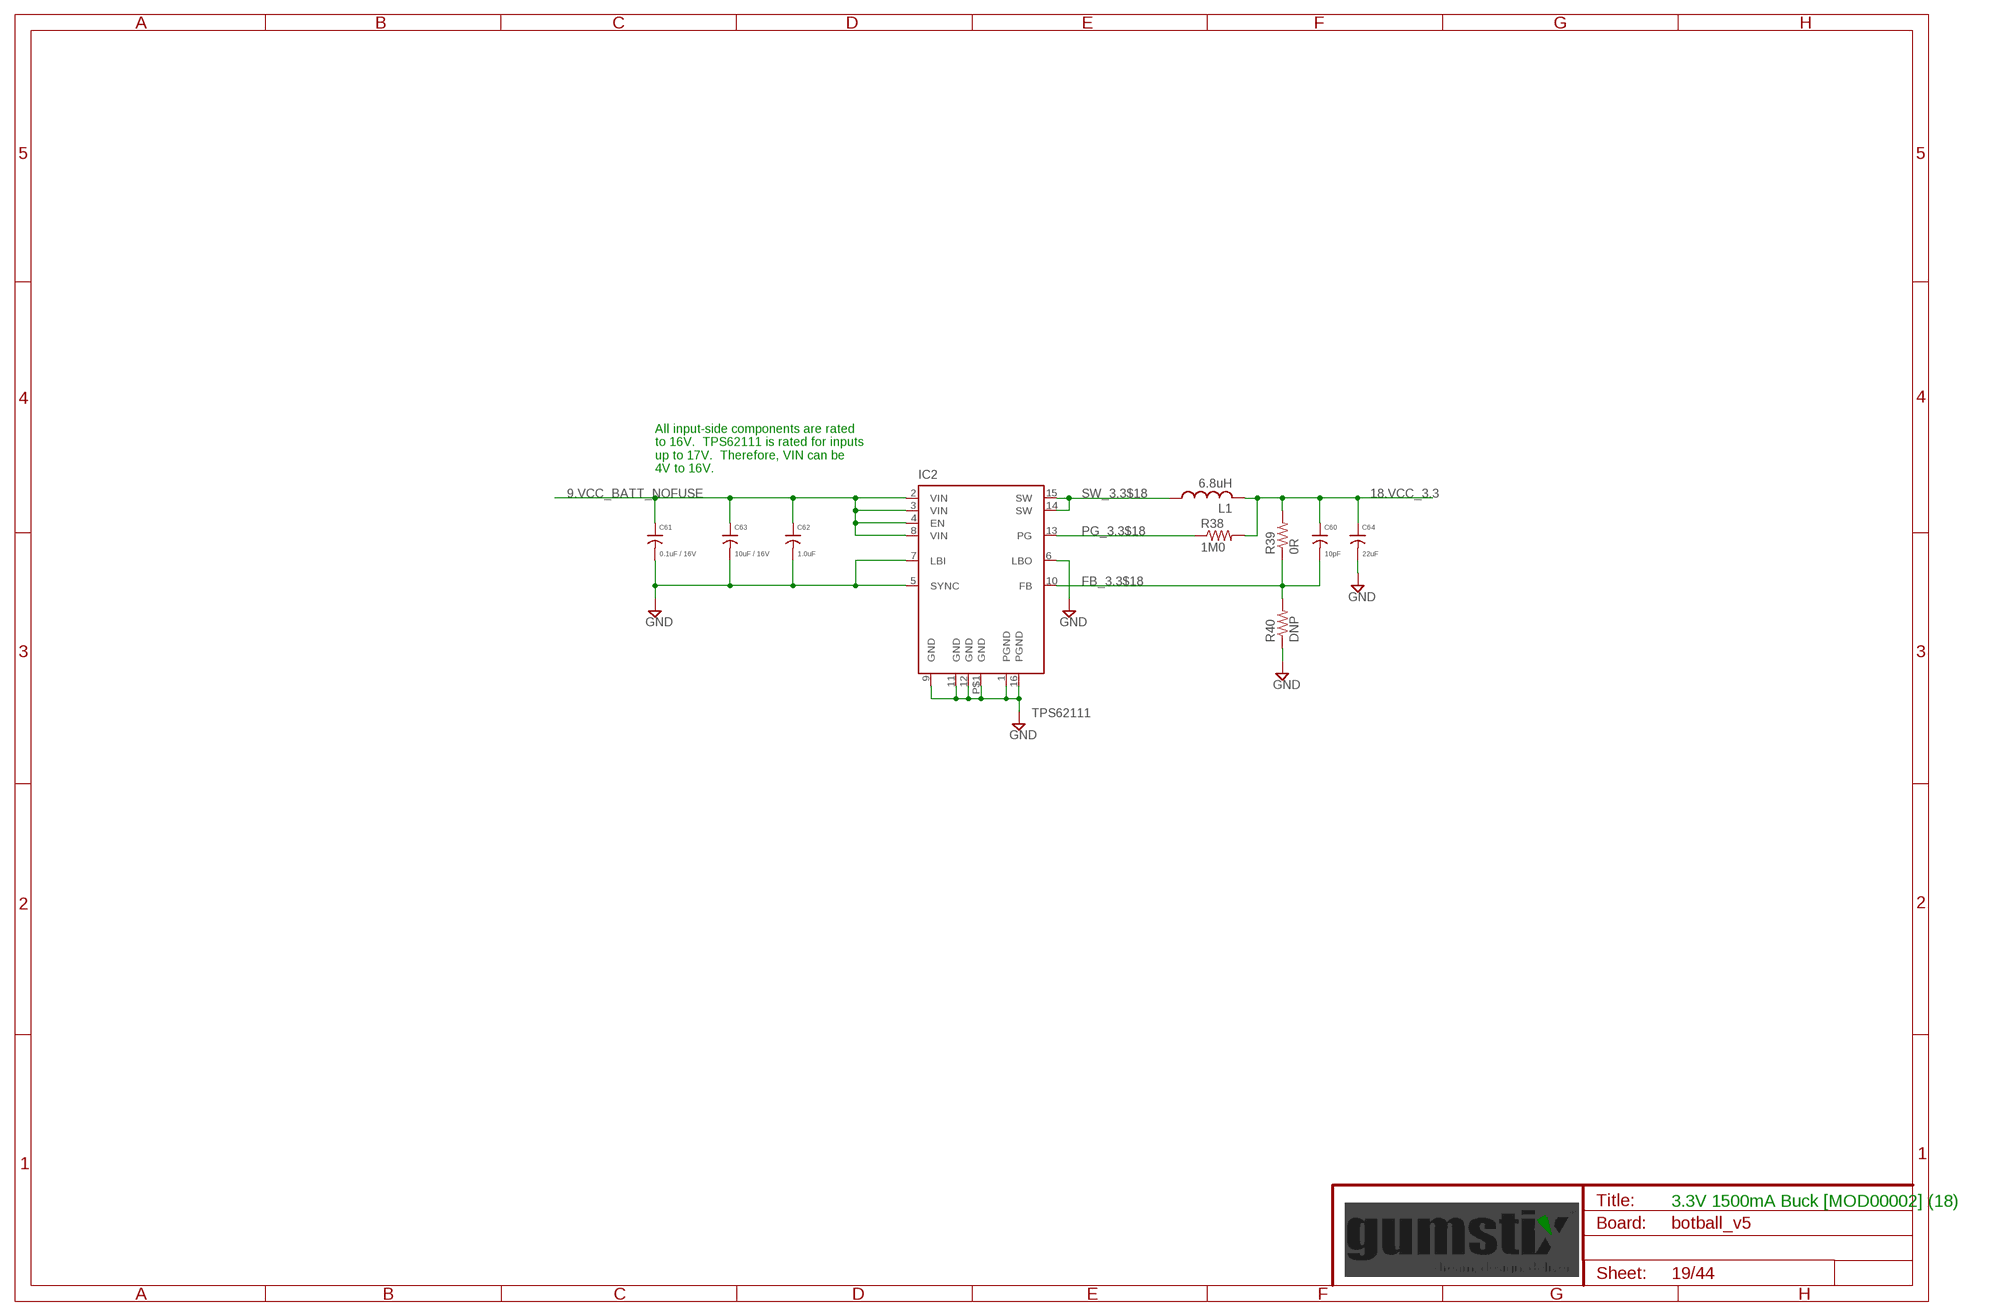
[diagram p18: schematic, sheet 19]

### Parts
C60  10pF  C0402  [0402]
C61  0.1uF / 16V  C0402  [0402]
C62  1.0uF  C0603  [0603]
C63  10uF / 16V  C0805  [0805]
C64  22uF  C0805  [0805]
IC2  TPS62111  [PQFP16]
L1  6.8uH  L1515  [1515]
R38  1M0  R0402  [0402]
R39  0R  R0402  [0402]
R40  DNP  R0402  [0402]

### Nets
9.VCC_BATT_NOFUSE: C61.1 C62.1 C63.1 IC2.2(VIN) IC2.3(VIN) IC2.4(EN) IC2.8(VIN) ; also sheet 10,22
18.VCC_3.3 [supply]: C60.1 C64.1 L1.2 R38.2 R39.2 ; also sheet 3,4,7,9,11,12,13,14,16,17,18,20,21,23,24,25,26,27,28,29,31,33,34,36,37,38,39
FB_3.3$18 [supply]: C60.2 IC2.10(FB) R39.1 R40.2
GND: C61.2 C62.2 C63.2 C64.2 IC2.1(PGND) IC2.5(SYNC) IC2.6(LBO) IC2.7(LBI) IC2.9(GND) IC2.11(GND) IC2.12(GND) IC2.16(PGND) IC2.P$1(GND) R40.1 ; also sheet 2,3,4,5,6,7,9,10,11,12,13,14,15,16,17,18,20,21,22,23,24,25,26,27,28,29,30,31,32,33,34,35,36,37,38,39,40,41,42,43,44
PG_3.3$18: IC2.13(PG) R38.1
SW_3.3$18 [supply]: IC2.14(SW) IC2.15(SW) L1.1

### Notes on the sheet
- All input-side components are rated
  to 16V.  TPS62111 is rated for inputs
  up to 17V.  Therefore, VIN can be
  4V to 16V.
- 3.3V 1500mA Buck [MOD00002] (18)

## Sheet 20 of 44
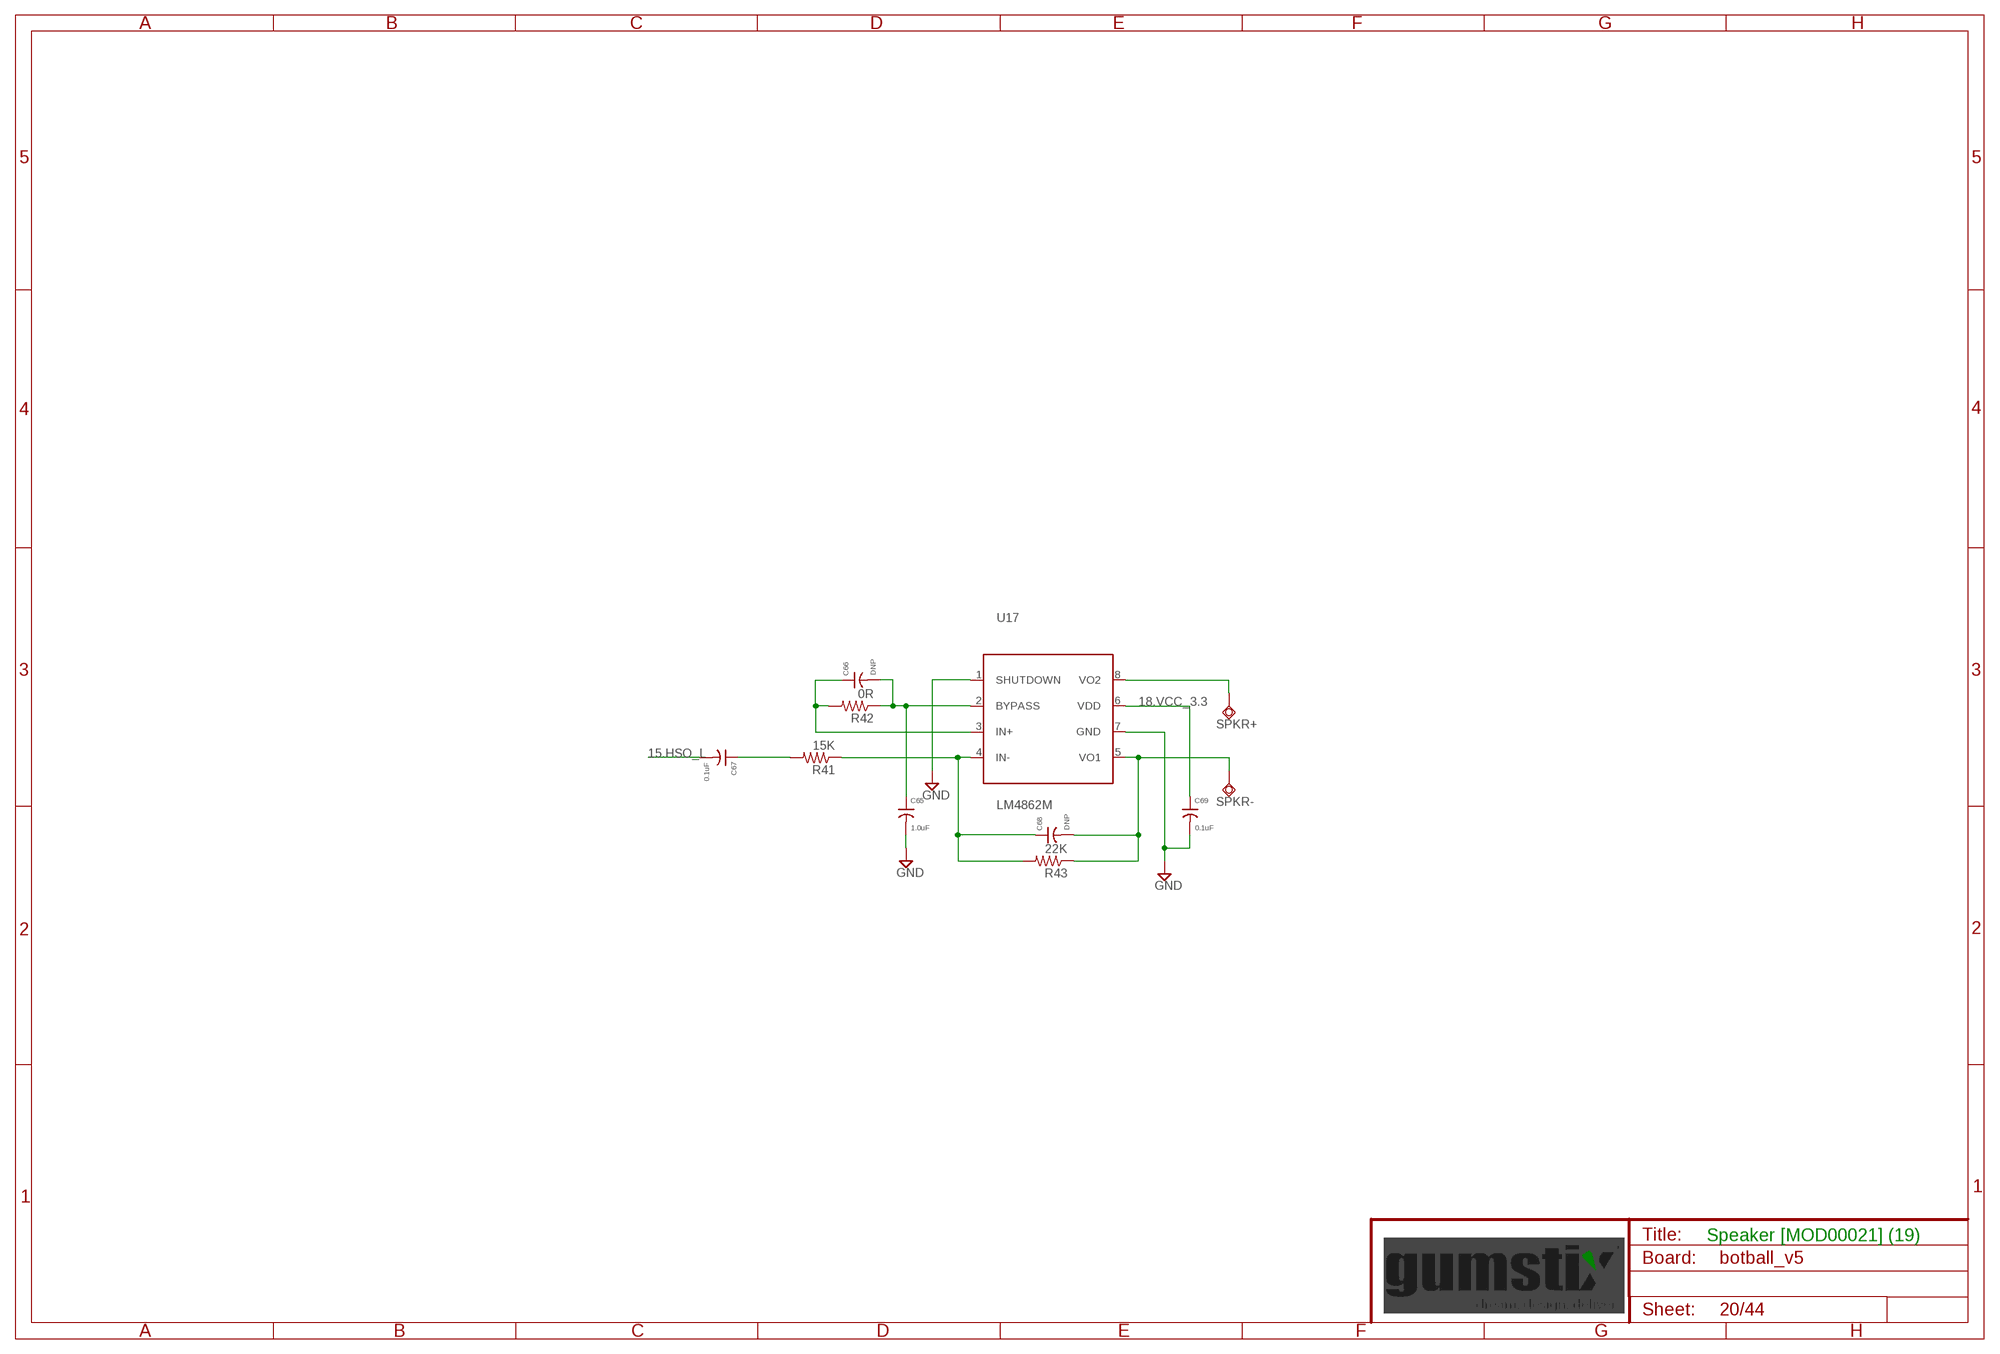
[diagram p19: schematic, sheet 20]

### Parts
C65  1.0uF  C0402  [0402]
C66  DNP  C0402  [0402]
C67  0.1uF  C0402  [0402]
C68  DNP  C0402  [0402]
C69  0.1uF  C0402  [0402]
R41  15K  R0201  [0201]
R42  0R  R0201  [0201]
R43  22K  R0402  [0402]
SPKR+  DNP  TPSQPAD1-13  [P1-13]
SPKR-  DNP  TPSQPAD1-13  [P1-13]
U17  LM4862M  LM4862  [SO-8]

### Nets
15.HSO_L: C67.2 ; also sheet 16
18.VCC_3.3 [supply]: C69.1 U17.6(VDD) ; also sheet 3,4,7,9,11,12,13,14,16,17,18,19,21,23,24,25,26,27,28,29,31,33,34,36,37,38,39
AMP_BYPASS$19: C65.1 C66.2 R42.1 U17.2(BYPASS)
AMP_IN+$19: C66.1 R42.2 U17.3(IN+)
AMP_IN-$19: C68.1 R41.1 R43.2 U17.4(IN-)
AMP_IN-_COUPLE$19: C67.1 R41.2
AMP_VO1$19: C68.2 R43.1 SPKR-.TP U17.5(VO1)
AMP_VO2$19: SPKR+.TP U17.8(VO2)
GND: C65.2 C69.2 U17.1(SHUTDOWN) U17.7(GND) ; also sheet 2,3,4,5,6,7,9,10,11,12,13,14,15,16,17,18,19,21,22,23,24,25,26,27,28,29,30,31,32,33,34,35,36,37,38,39,40,41,42,43,44

### Notes on the sheet
- Speaker [MOD00021] (19)

## Sheet 21 of 44
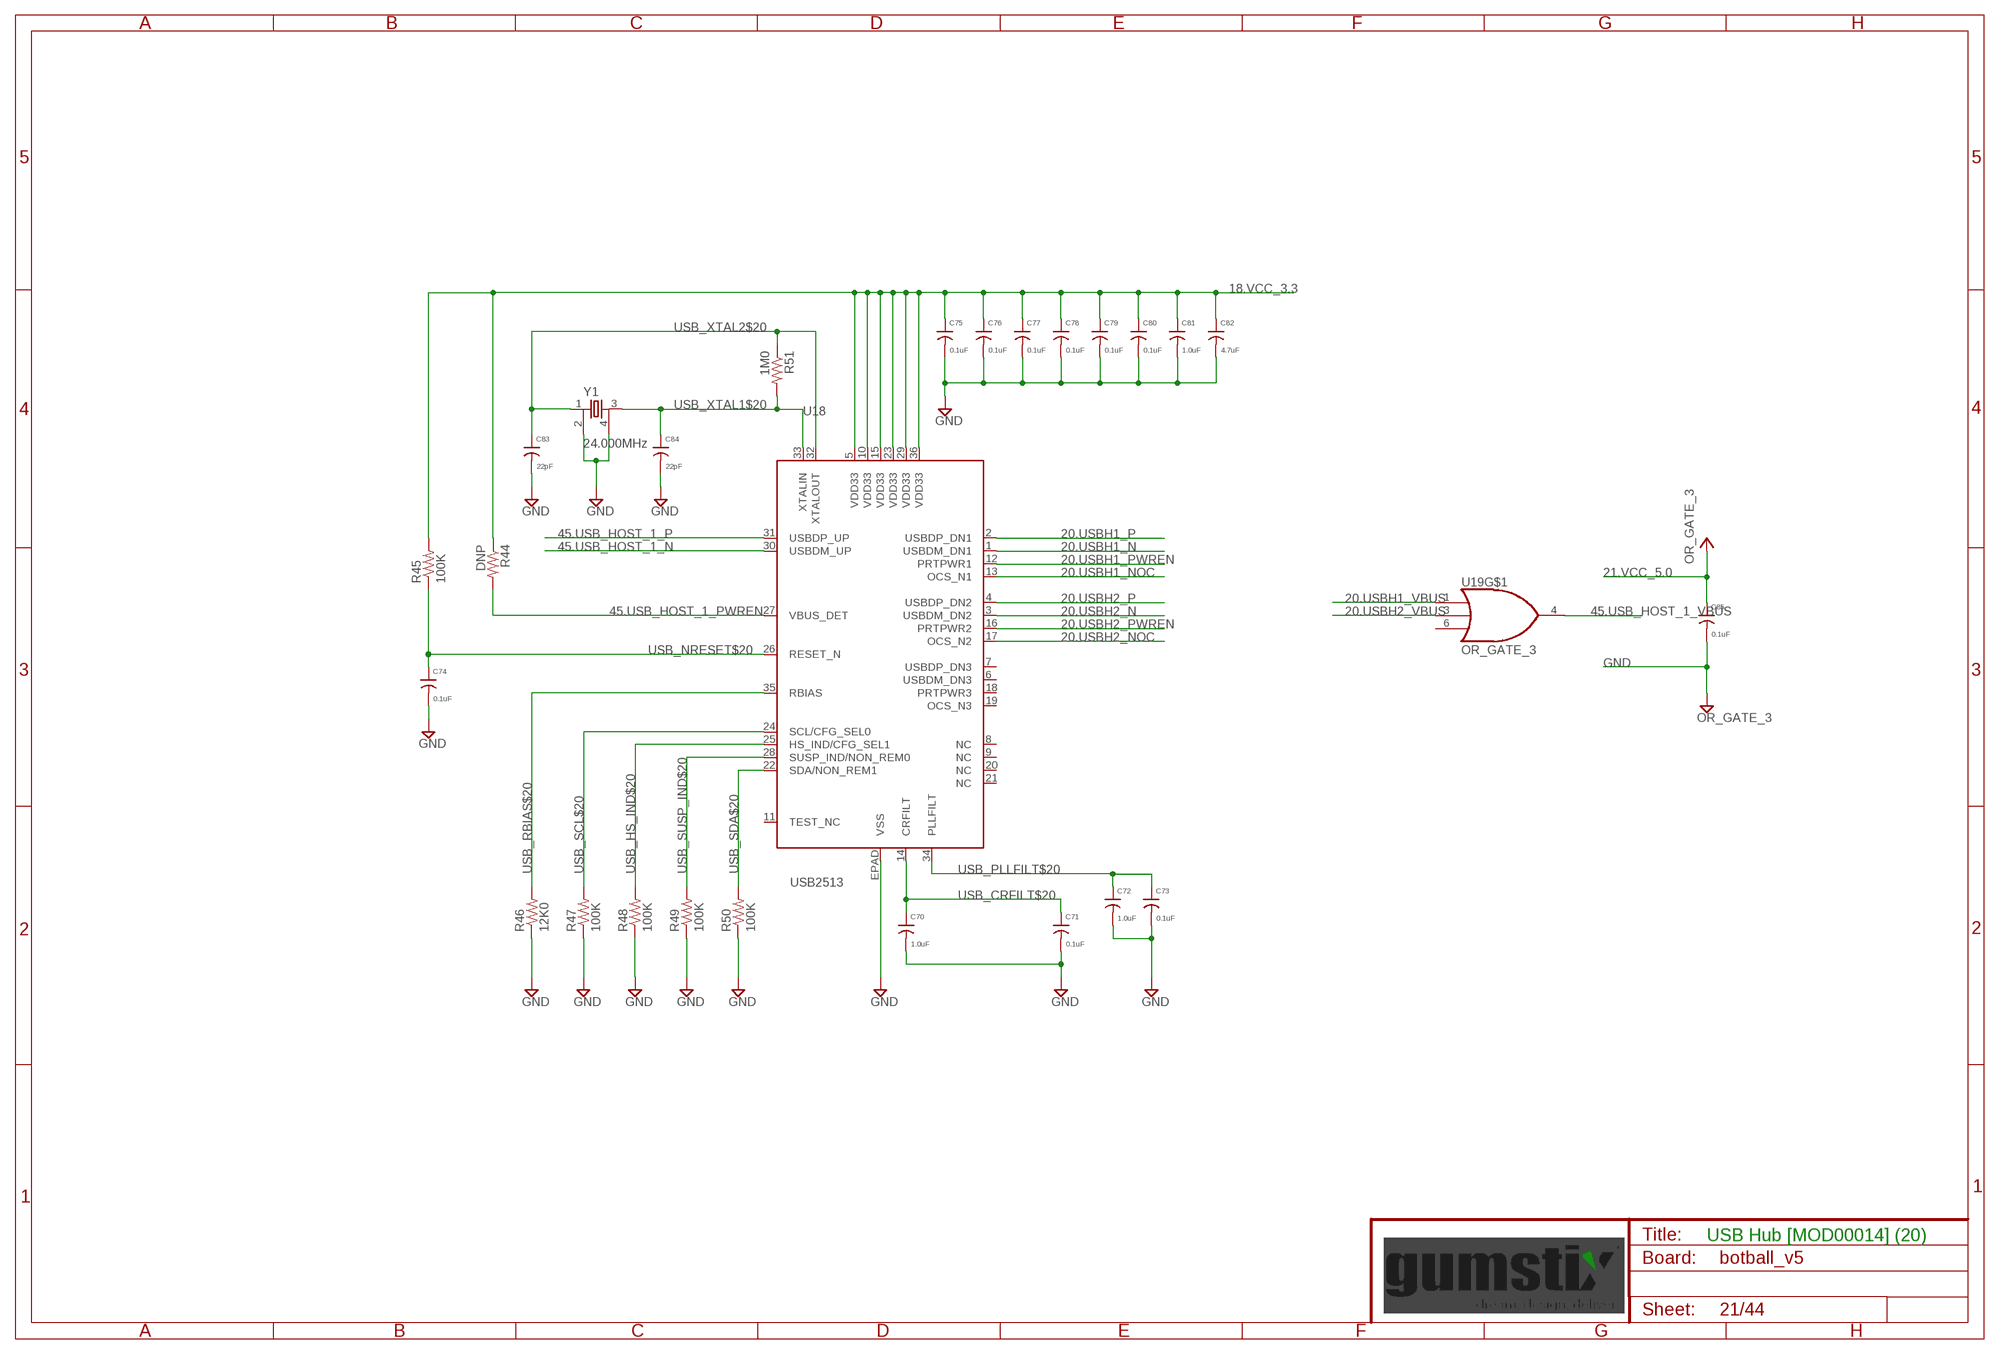
[diagram p20: schematic, sheet 21]

### Parts
C70  1.0uF  C0402  [0402]
C71  0.1uF  C0402  [0402]
C72  1.0uF  C0402  [0402]
C73  0.1uF  C0402  [0402]
C74  0.1uF  C0402  [0402]
C75  0.1uF  C0402  [0402]
C76  0.1uF  C0402  [0402]
C77  0.1uF  C0402  [0402]
C78  0.1uF  C0402  [0402]
C79  0.1uF  C0402  [0402]
C80  0.1uF  C0402  [0402]
C81  1.0uF  C0402  [0402]
C82  4.7uF  C0603  [0603]
C83  22pF  C0402  [0402]
C84  22pF  C0402  [0402]
C85  0.1uF  C0402  [0402]
R44  DNP  R0402  [0402]
R45  100K  R0402  [0402]
R46  12K0  R0402  [0402]
R47  100K  R0402  [0402]
R48  100K  R0402  [0402]
R49  100K  R0402  [0402]
R50  100K  R0402  [0402]
R51  1M0  R0402  [0402]
U18  USB2513  [QFN36-6X6MM]
U19  OR_GATE_3  [SOT-23-6]
Y1  24.000MHz  Y4CRYSTAL-3225  [CRYSTAL-3225]

### Nets
18.VCC_3.3 [supply]: C75.1 C76.1 C77.1 C78.1 C79.1 C80.1 C81.1 C82.1 R44.1 R45.2 U18.5(VDD33) U18.10(VDD33) U18.15(VDD33) U18.23(VDD33) U18.29(VDD33) U18.36(VDD33) ; also sheet 3,4,7,9,11,12,13,14,16,17,18,19,20,23,24,25,26,27,28,29,31,33,34,36,37,38,39
20.USBH1_N [USB]: U18.1(USBDM_DN1) ; also sheet 15
20.USBH1_NOC: U18.13(OCS_N1) ; also sheet 15
20.USBH1_P [USB]: U18.2(USBDP_DN1) ; also sheet 15
20.USBH1_PWREN: U18.12(PRTPWR1) ; also sheet 15
20.USBH1_VBUS [supply]: U19.1(I1) ; also sheet 15
20.USBH2_N [USB]: U18.3(USBDM_DN2) ; also sheet 15
20.USBH2_NOC: U18.17(OCS_N2) ; also sheet 15
20.USBH2_P [USB]: U18.4(USBDP_DN2) ; also sheet 15
20.USBH2_PWREN: U18.16(PRTPWR2) ; also sheet 15
20.USBH2_VBUS [supply]: U19.3(I2) ; also sheet 15
21.VCC_5.0 [supply]: C85.1 U19.5(+3V3) ; also sheet 2,3,7,8,10,13,15,22,25,27,28,31,32,34,39,40,43
45.USB_HOST_1_N [USB]: U18.30(USBDM_UP) ; also sheet 43
45.USB_HOST_1_P [USB]: U18.31(USBDP_UP) ; also sheet 43
45.USB_HOST_1_PWREN: R44.2 U18.27(VBUS_DET) ; also sheet 43
45.USB_HOST_1_VBUS [supply]: U19.4(O) ; also sheet 43
GND: C70.2 C71.2 C72.2 C73.2 C74.2 C75.2 C76.2 C77.2 C78.2 C79.2 C80.2 C81.2 C82.2 C83.2 C84.2 C85.2 R46.1 R47.1 R48.1 R49.1 R50.1 U18.EPAD(VSS) U19.2(GND) Y1.2 Y1.4 ; also sheet 2,3,4,5,6,7,9,10,11,12,13,14,15,16,17,18,19,20,22,23,24,25,26,27,28,29,30,31,32,33,34,35,36,37,38,39,40,41,42,43,44
USB_CRFILT$20: C70.1 C71.1 U18.14(CRFILT)
USB_HS_IND$20: R48.2 U18.25(HS_IND/CFG_SEL1)
USB_NRESET$20: C74.1 R45.1 U18.26(RESET_N)
USB_PLLFILT$20: C72.1 C73.1 U18.34(PLLFILT)
USB_RBIAS$20: R46.2 U18.35(RBIAS)
USB_SCL$20: R47.2 U18.24(SCL/CFG_SEL0)
USB_SDA$20: R50.2 U18.22(SDA/NON_REM1)
USB_SUSP_IND$20: R49.2 U18.28(SUSP_IND/NON_REM0)
USB_XTAL1$20: C84.1 R51.2 U18.33(XTALIN) Y1.3
USB_XTAL2$20: C83.1 R51.1 U18.32(XTALOUT) Y1.1
Unconnected: U18.6(USBDM_DN3) U18.7(USBDP_DN3) U18.8(NC) U18.9(NC) U18.11(TEST_NC) U18.18(PRTPWR3) U18.19(OCS_N3) U18.20(NC) U18.21(NC) U19.6(I3)

### Notes on the sheet
- USB Hub [MOD00014] (20)

## Sheet 22 of 44
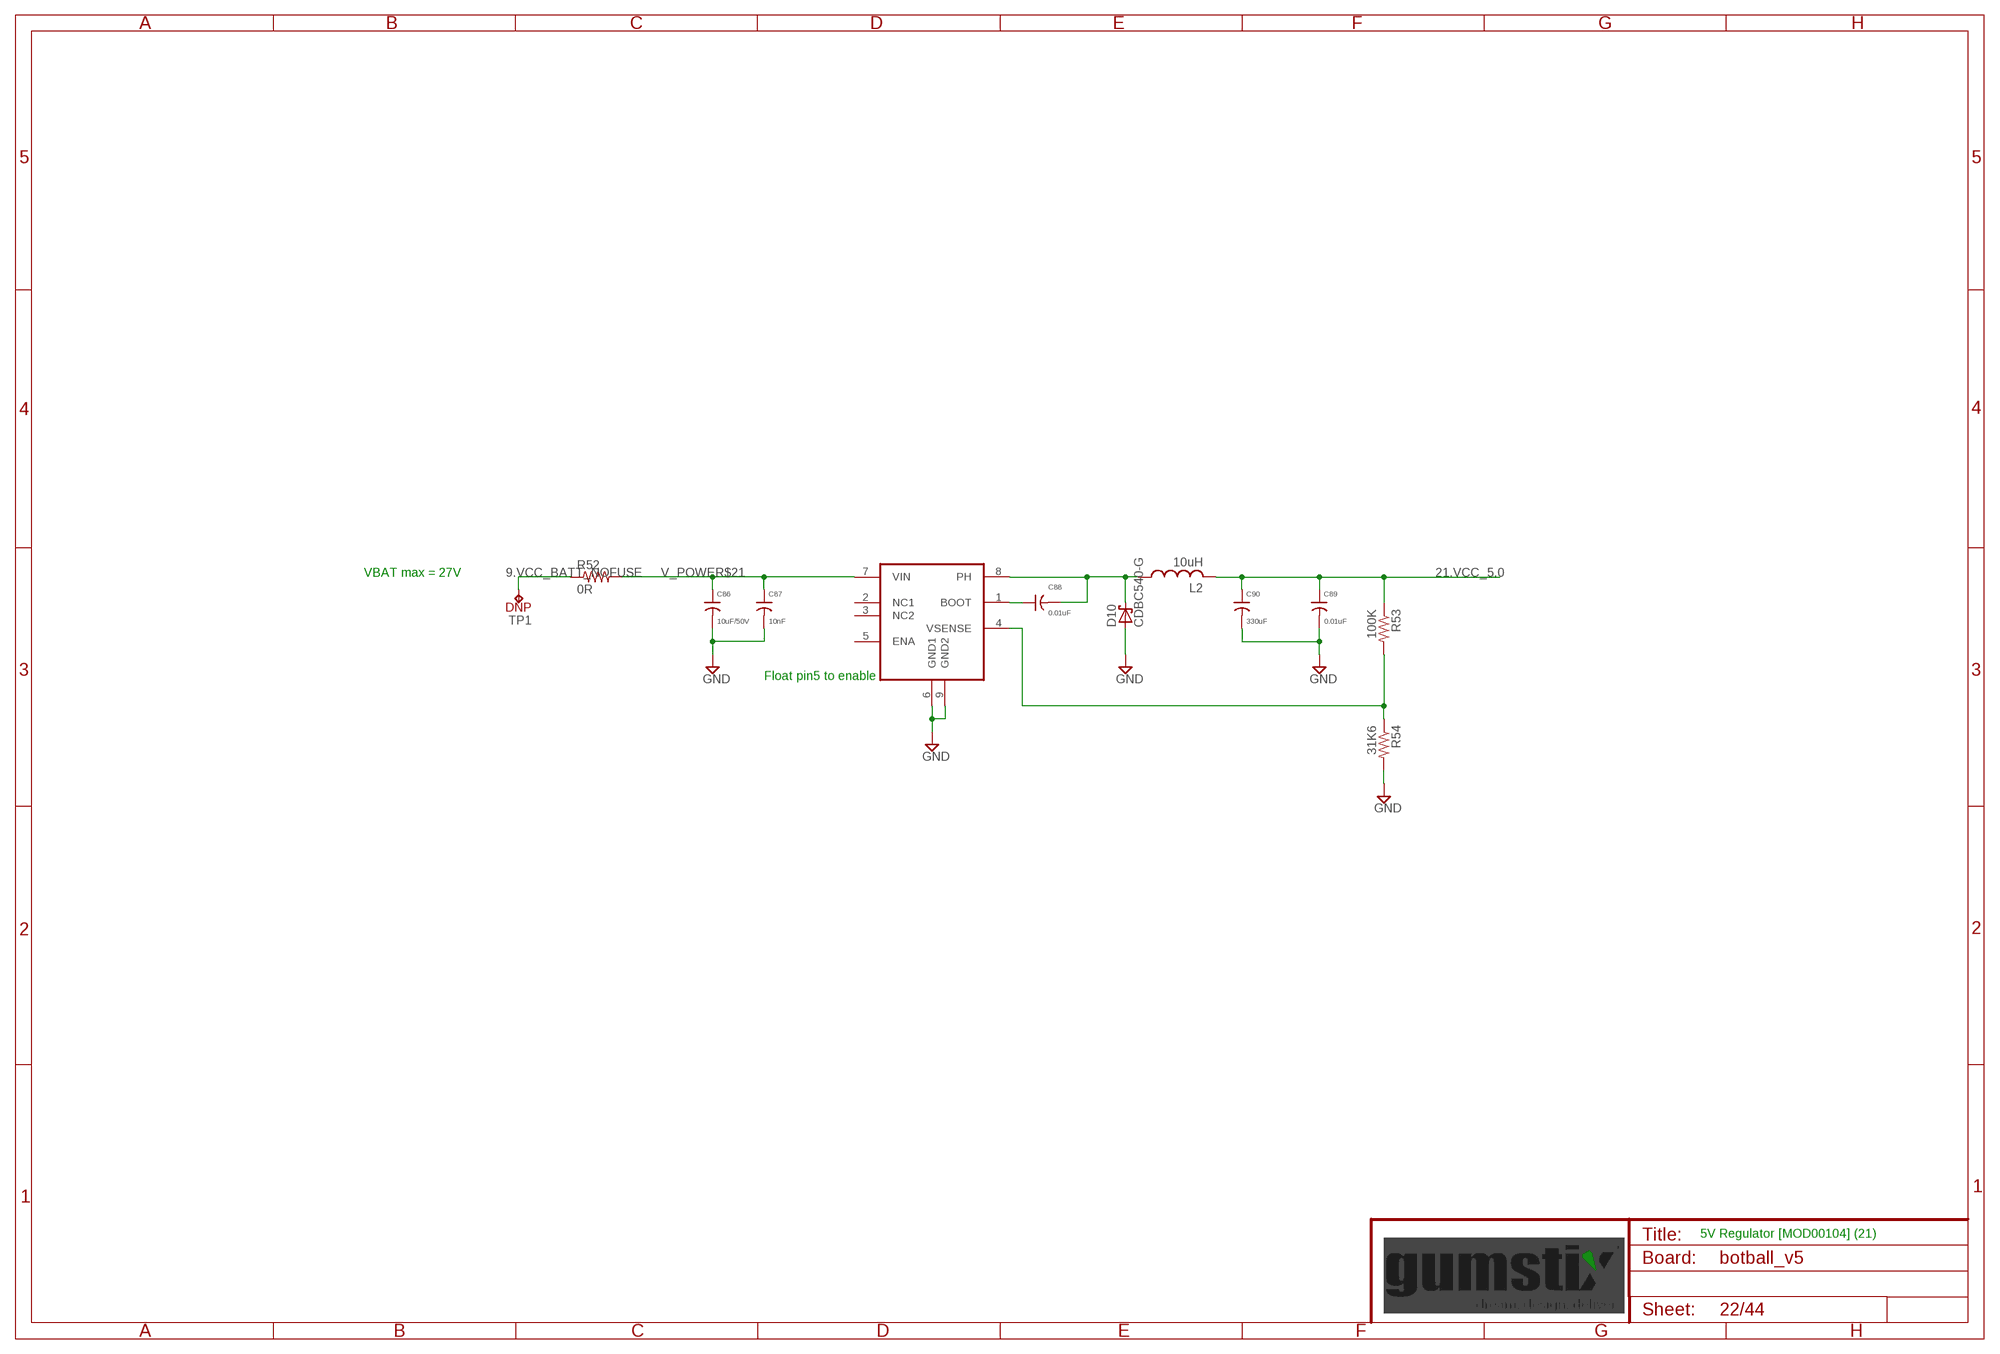
[diagram p21: schematic, sheet 22]

### Parts
C86  10uF/50V  C1206  [1206]
C87  10nF  C0603  [0603]
C88  0.01uF  C0402  [0402]
C89  0.01uF  C0402  [0402]
C90  330uF  CPANASONIC_F  [PANASONIC_F]
D10  CDBC540-G  SCHOTTKY-DIODE  [DO-214AB]
L2  10uH  L3232DZ  [3232DZ]
R52  0R  R0805  [0805]
R53  100K  R0402  [0402]
R54  31K6  R0402  [0402]
TP1  DNP  TP05  [TP0500]
U$27  TPS5450  [8SO_POWERPAD]

### Nets
9.VCC_BATT_NOFUSE: R52.1 TP1.1(TP) ; also sheet 10,19
21.VCC_5.0 [supply]: C89.1 C90.+ L2.2 R53.1 ; also sheet 2,3,7,8,10,13,15,21,25,27,28,31,32,34,39,40,43
BOOT$21 [supply]: C88.1 U$27.1(BOOT)
GND: C86.2 C87.2 C89.2 C90.- D10.A R54.2 U$27.6(GND1) U$27.9(GND2) ; also sheet 2,3,4,5,6,7,9,10,11,12,13,14,15,16,17,18,19,20,21,23,24,25,26,27,28,29,30,31,32,33,34,35,36,37,38,39,40,41,42,43,44
PH$21 [supply]: C88.2 D10.C L2.1 U$27.8(PH)
V_POWER$21 [supply]: C86.1 C87.1 R52.2 U$27.7(VIN)
VSENSE$21 [supply]: R53.2 R54.1 U$27.4(VSENSE)
Unconnected: U$27.2(NC1) U$27.3(NC2) U$27.5(ENA)

### Notes on the sheet
- VBAT max = 27V
- Float pin5 to enable
- 5V Regulator [MOD00104] (21)

## Sheet 23 of 44
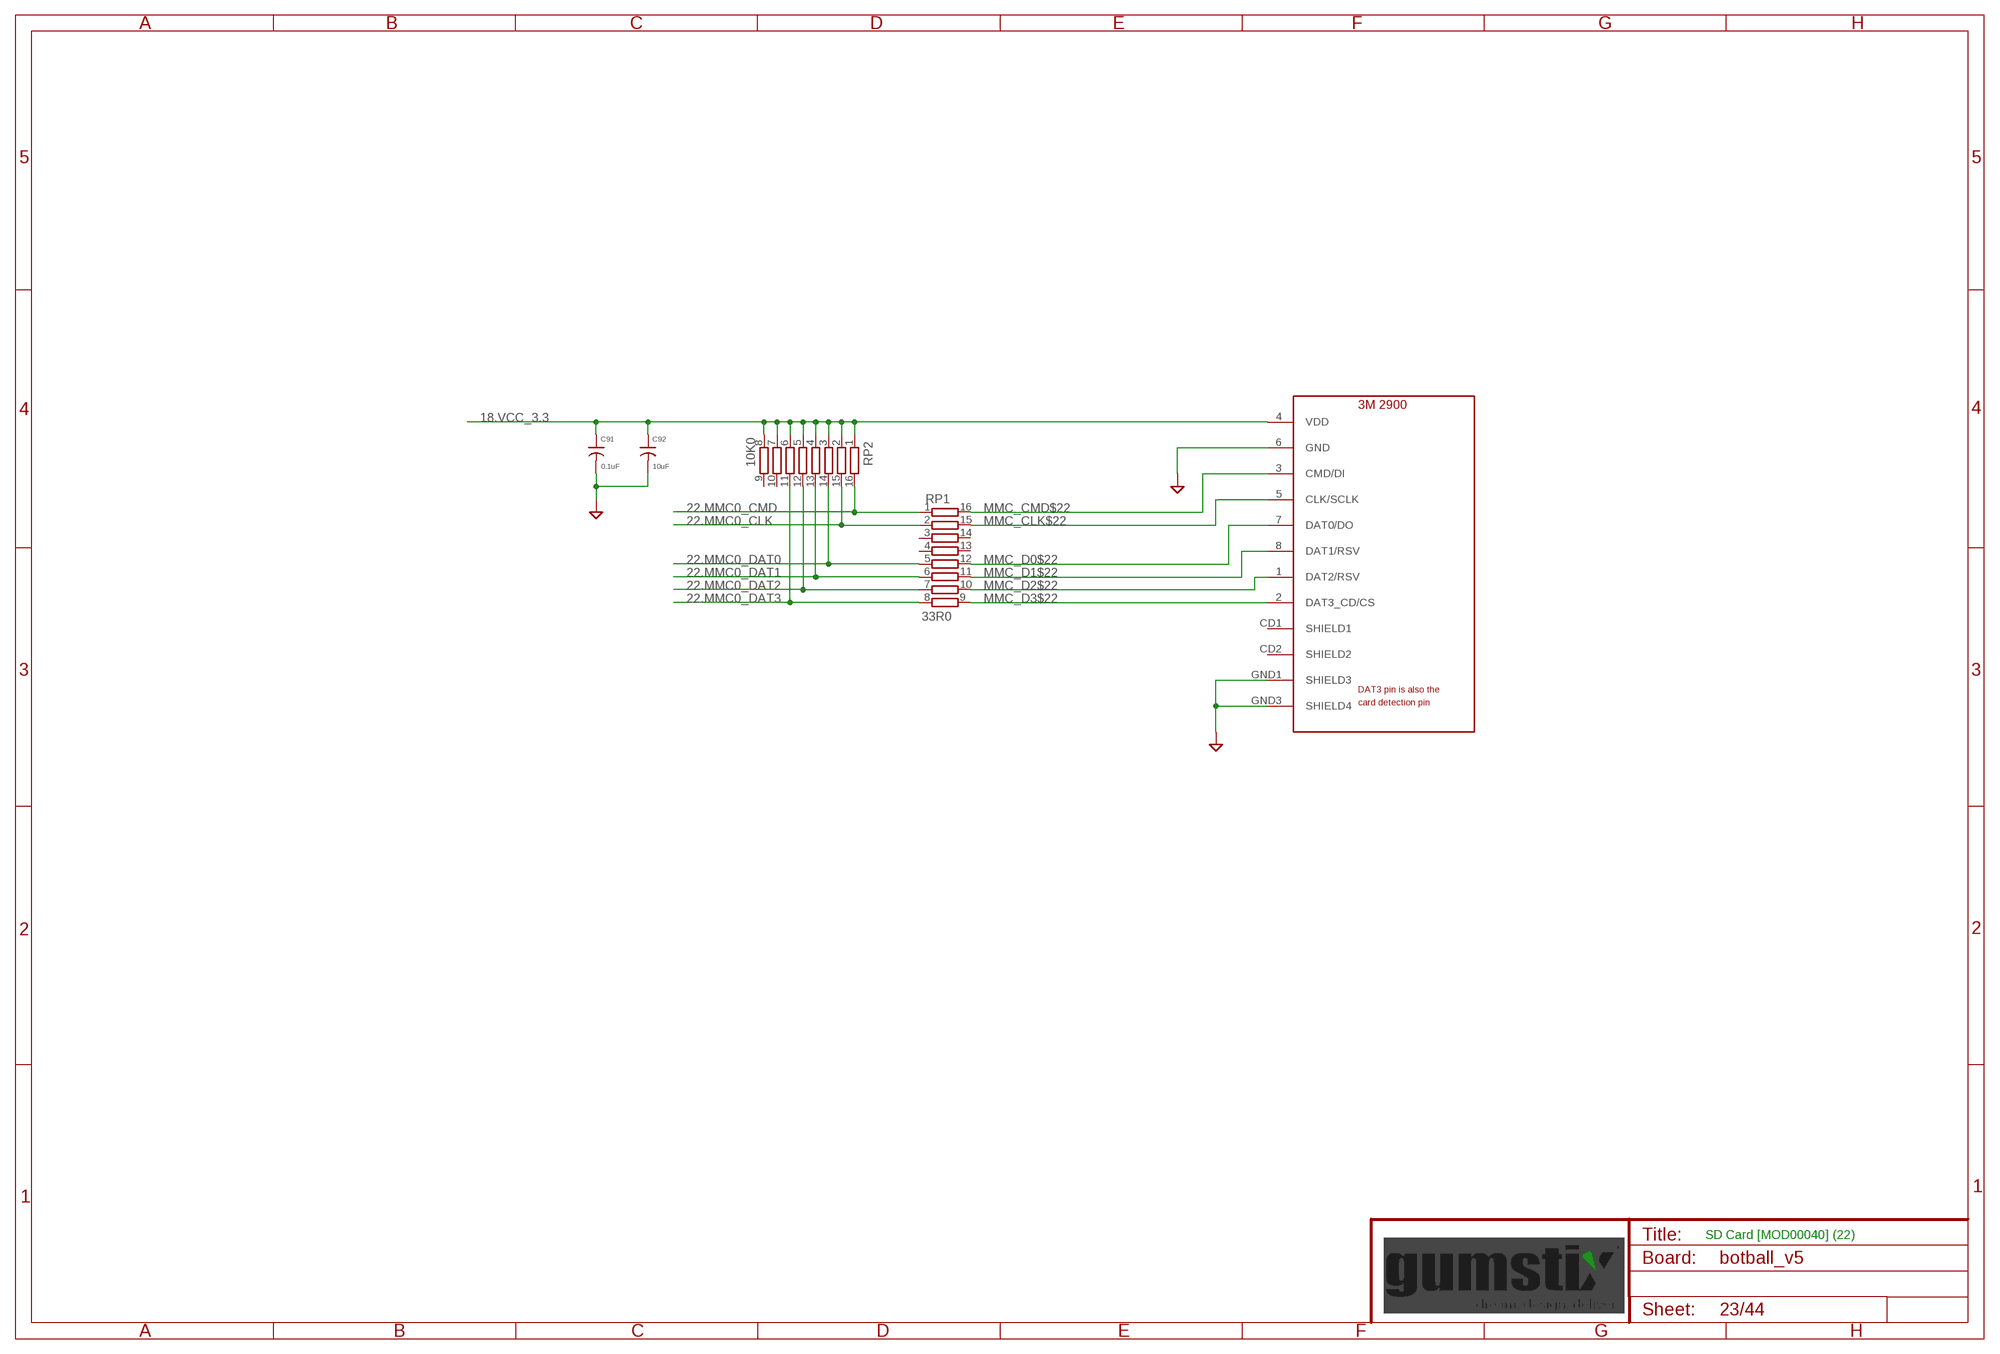
[diagram p22: schematic, sheet 23]

### Parts
C91  0.1uF  C0402  [0402]
C92  10uF  C0603  [0603]
RP1  33R0  RP741X163  [741X16]
RP2  10K0  RP741X163  [741X16]
U$30  USD_3M2900  [USD]

### Nets
18.VCC_3.3 [supply]: C91.1 C92.1 RP2.1 RP2.2 RP2.3 RP2.4 RP2.5 RP2.6 RP2.7 RP2.8 U$30.4(VDD) ; also sheet 3,4,7,9,11,12,13,14,16,17,18,19,20,21,24,25,26,27,28,29,31,33,34,36,37,38,39
22.MMC0_CLK: RP1.2 RP2.15 ; also sheet 43
22.MMC0_CMD: RP1.1 RP2.16 ; also sheet 43
22.MMC0_DAT0: RP1.5 RP2.14 ; also sheet 43
22.MMC0_DAT1: RP1.6 RP2.13 ; also sheet 43
22.MMC0_DAT2: RP1.7 RP2.12 ; also sheet 43
22.MMC0_DAT3: RP1.8 RP2.11 ; also sheet 43
GND: C91.2 C92.2 U$30.6(GND) U$30.GND1(SHIELD3) U$30.GND3(SHIELD4) ; also sheet 2,3,4,5,6,7,9,10,11,12,13,14,15,16,17,18,19,20,21,22,24,25,26,27,28,29,30,31,32,33,34,35,36,37,38,39,40,41,42,43,44
MMC_CLK$22: RP1.15 U$30.5(CLK/SCLK)
MMC_CMD$22: RP1.16 U$30.3(CMD/DI)
MMC_D0$22: RP1.12 U$30.7(DAT0/DO)
MMC_D1$22: RP1.11 U$30.8(DAT1/RSV)
MMC_D2$22: RP1.10 U$30.1(DAT2/RSV)
MMC_D3$22: RP1.9 U$30.2(DAT3_CD/CS)
Unconnected: RP1.3 RP1.4 RP1.13 RP1.14 RP2.9 RP2.10 U$30.CD1(SHIELD1) U$30.CD2(SHIELD2)

### Notes on the sheet
- SD Card [MOD00040] (22)

## Sheet 24 of 44
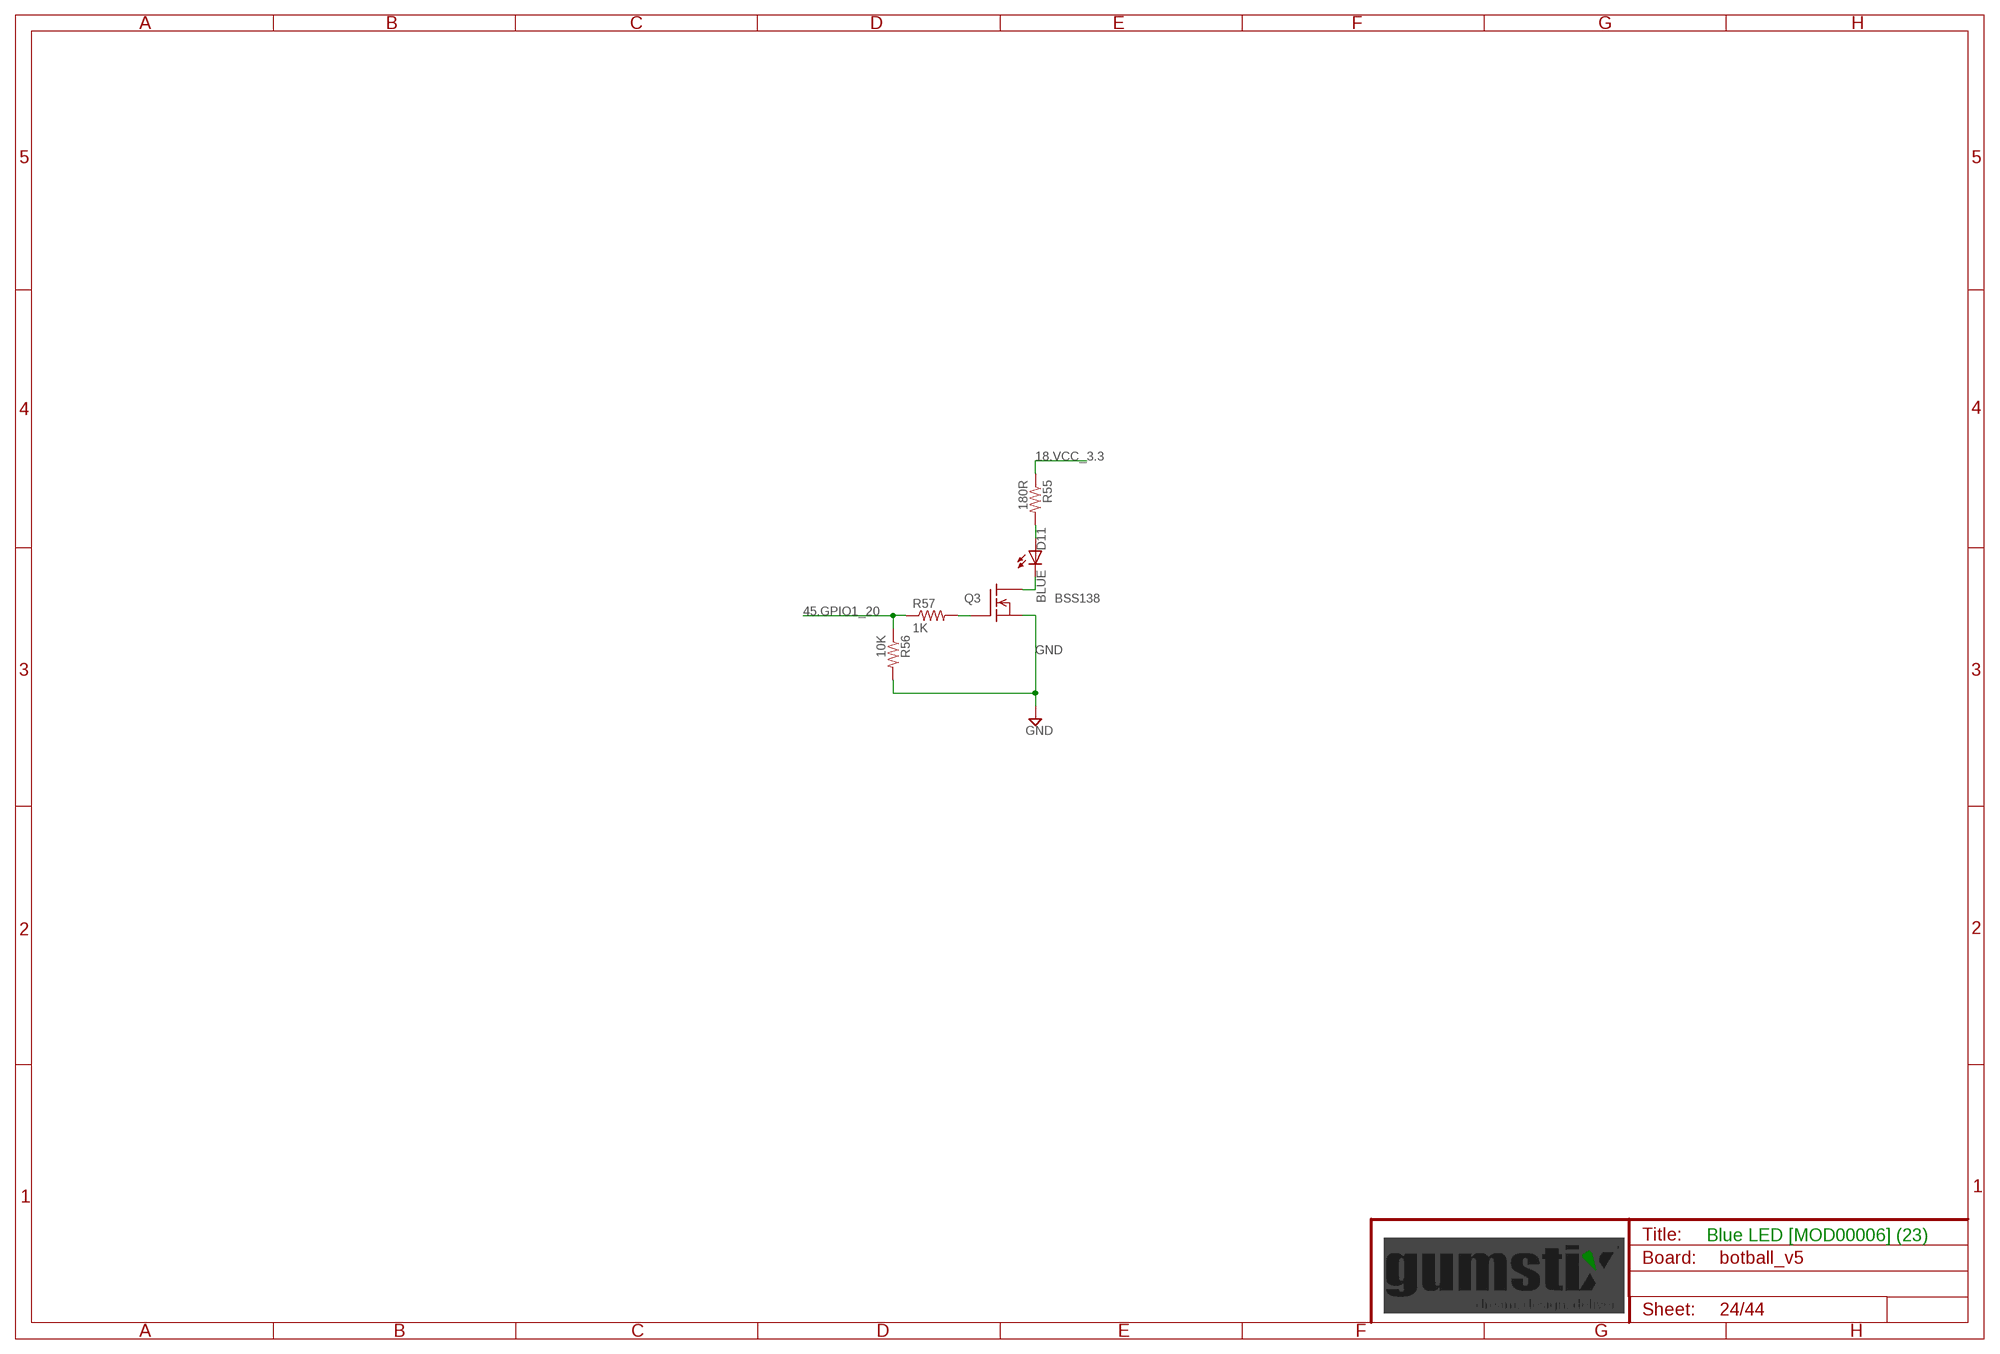
[diagram p23: schematic, sheet 24]

### Parts
D11  BLUE  LED0603  [D0603]
Q3  BSS138  [SOT23]
R55  180R  R0402  [0402]
R56  10K  R0402  [0402]
R57  1K  R0402  [0402]

### Nets
18.VCC_3.3 [supply]: R55.1 ; also sheet 3,4,7,9,11,12,13,14,16,17,18,19,20,21,23,25,26,27,28,29,31,33,34,36,37,38,39
45.GPIO1_20: R56.1 R57.1 ; also sheet 42
GND: Q3.2(S) R56.2 ; also sheet 2,3,4,5,6,7,9,10,11,12,13,14,15,16,17,18,19,20,21,22,23,25,26,27,28,29,30,31,32,33,34,35,36,37,38,39,40,41,42,43,44
N1$23: D11.A R55.2
N2$23: D11.C Q3.3(D)
N3$23: Q3.1(G) R57.2

### Notes on the sheet
- Blue LED [MOD00006] (23)